# EAGLE schematic icyradio-main (EAGLE 9.6.2), part 2 of 3
## Sheet 5 of 13: RF Interface
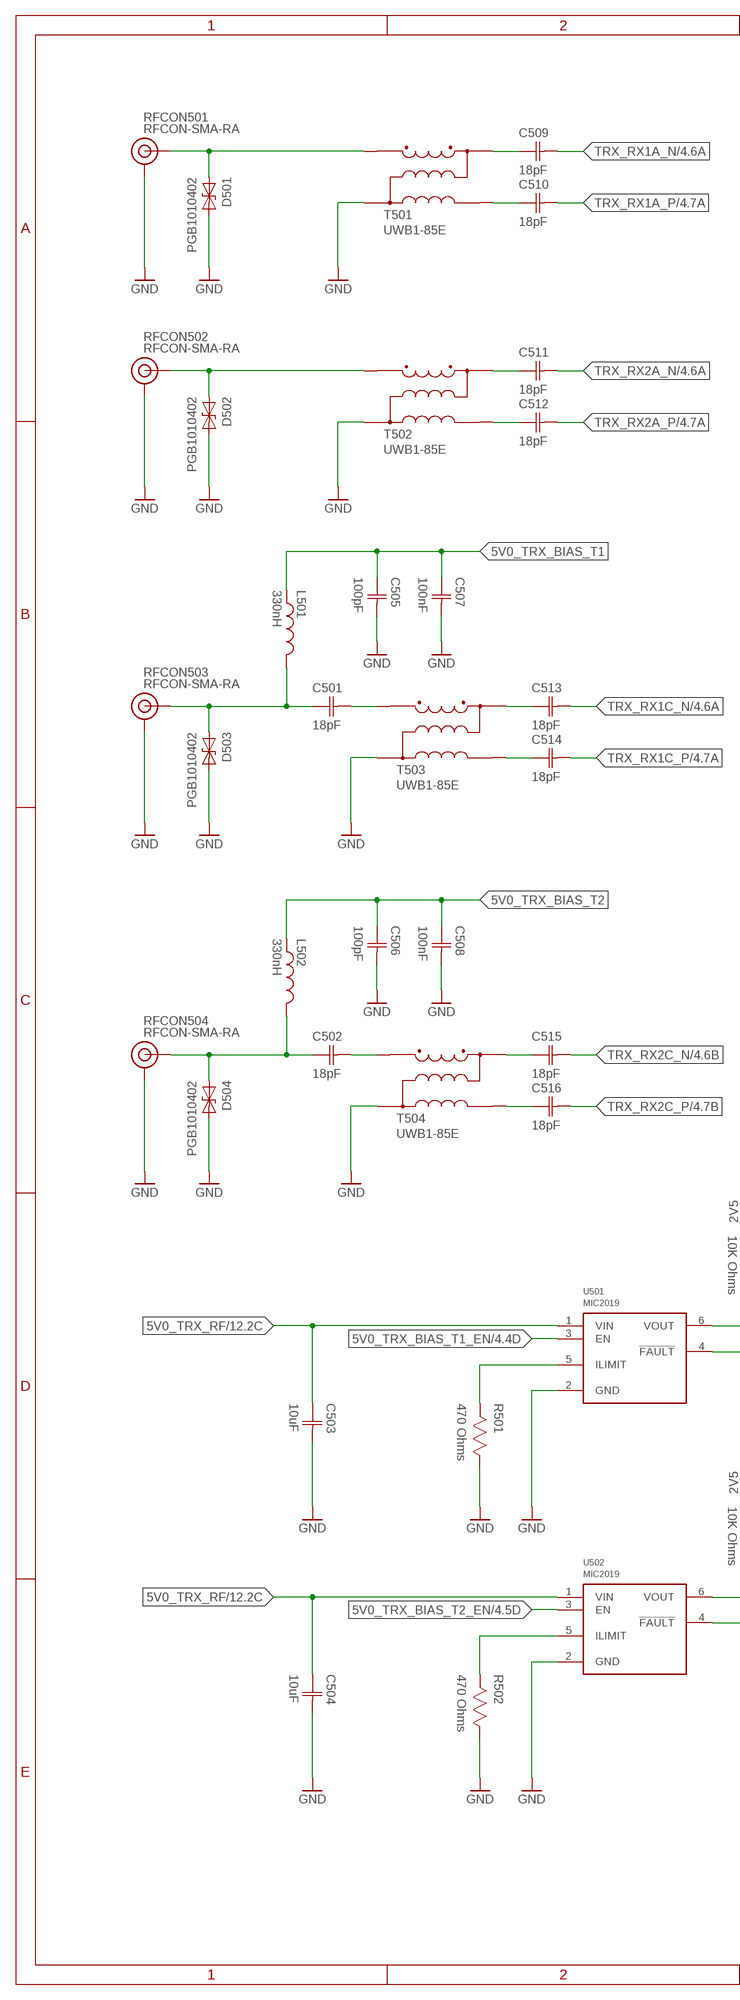
[diagram p8: schematic, sheet 5, part 1 of 2]
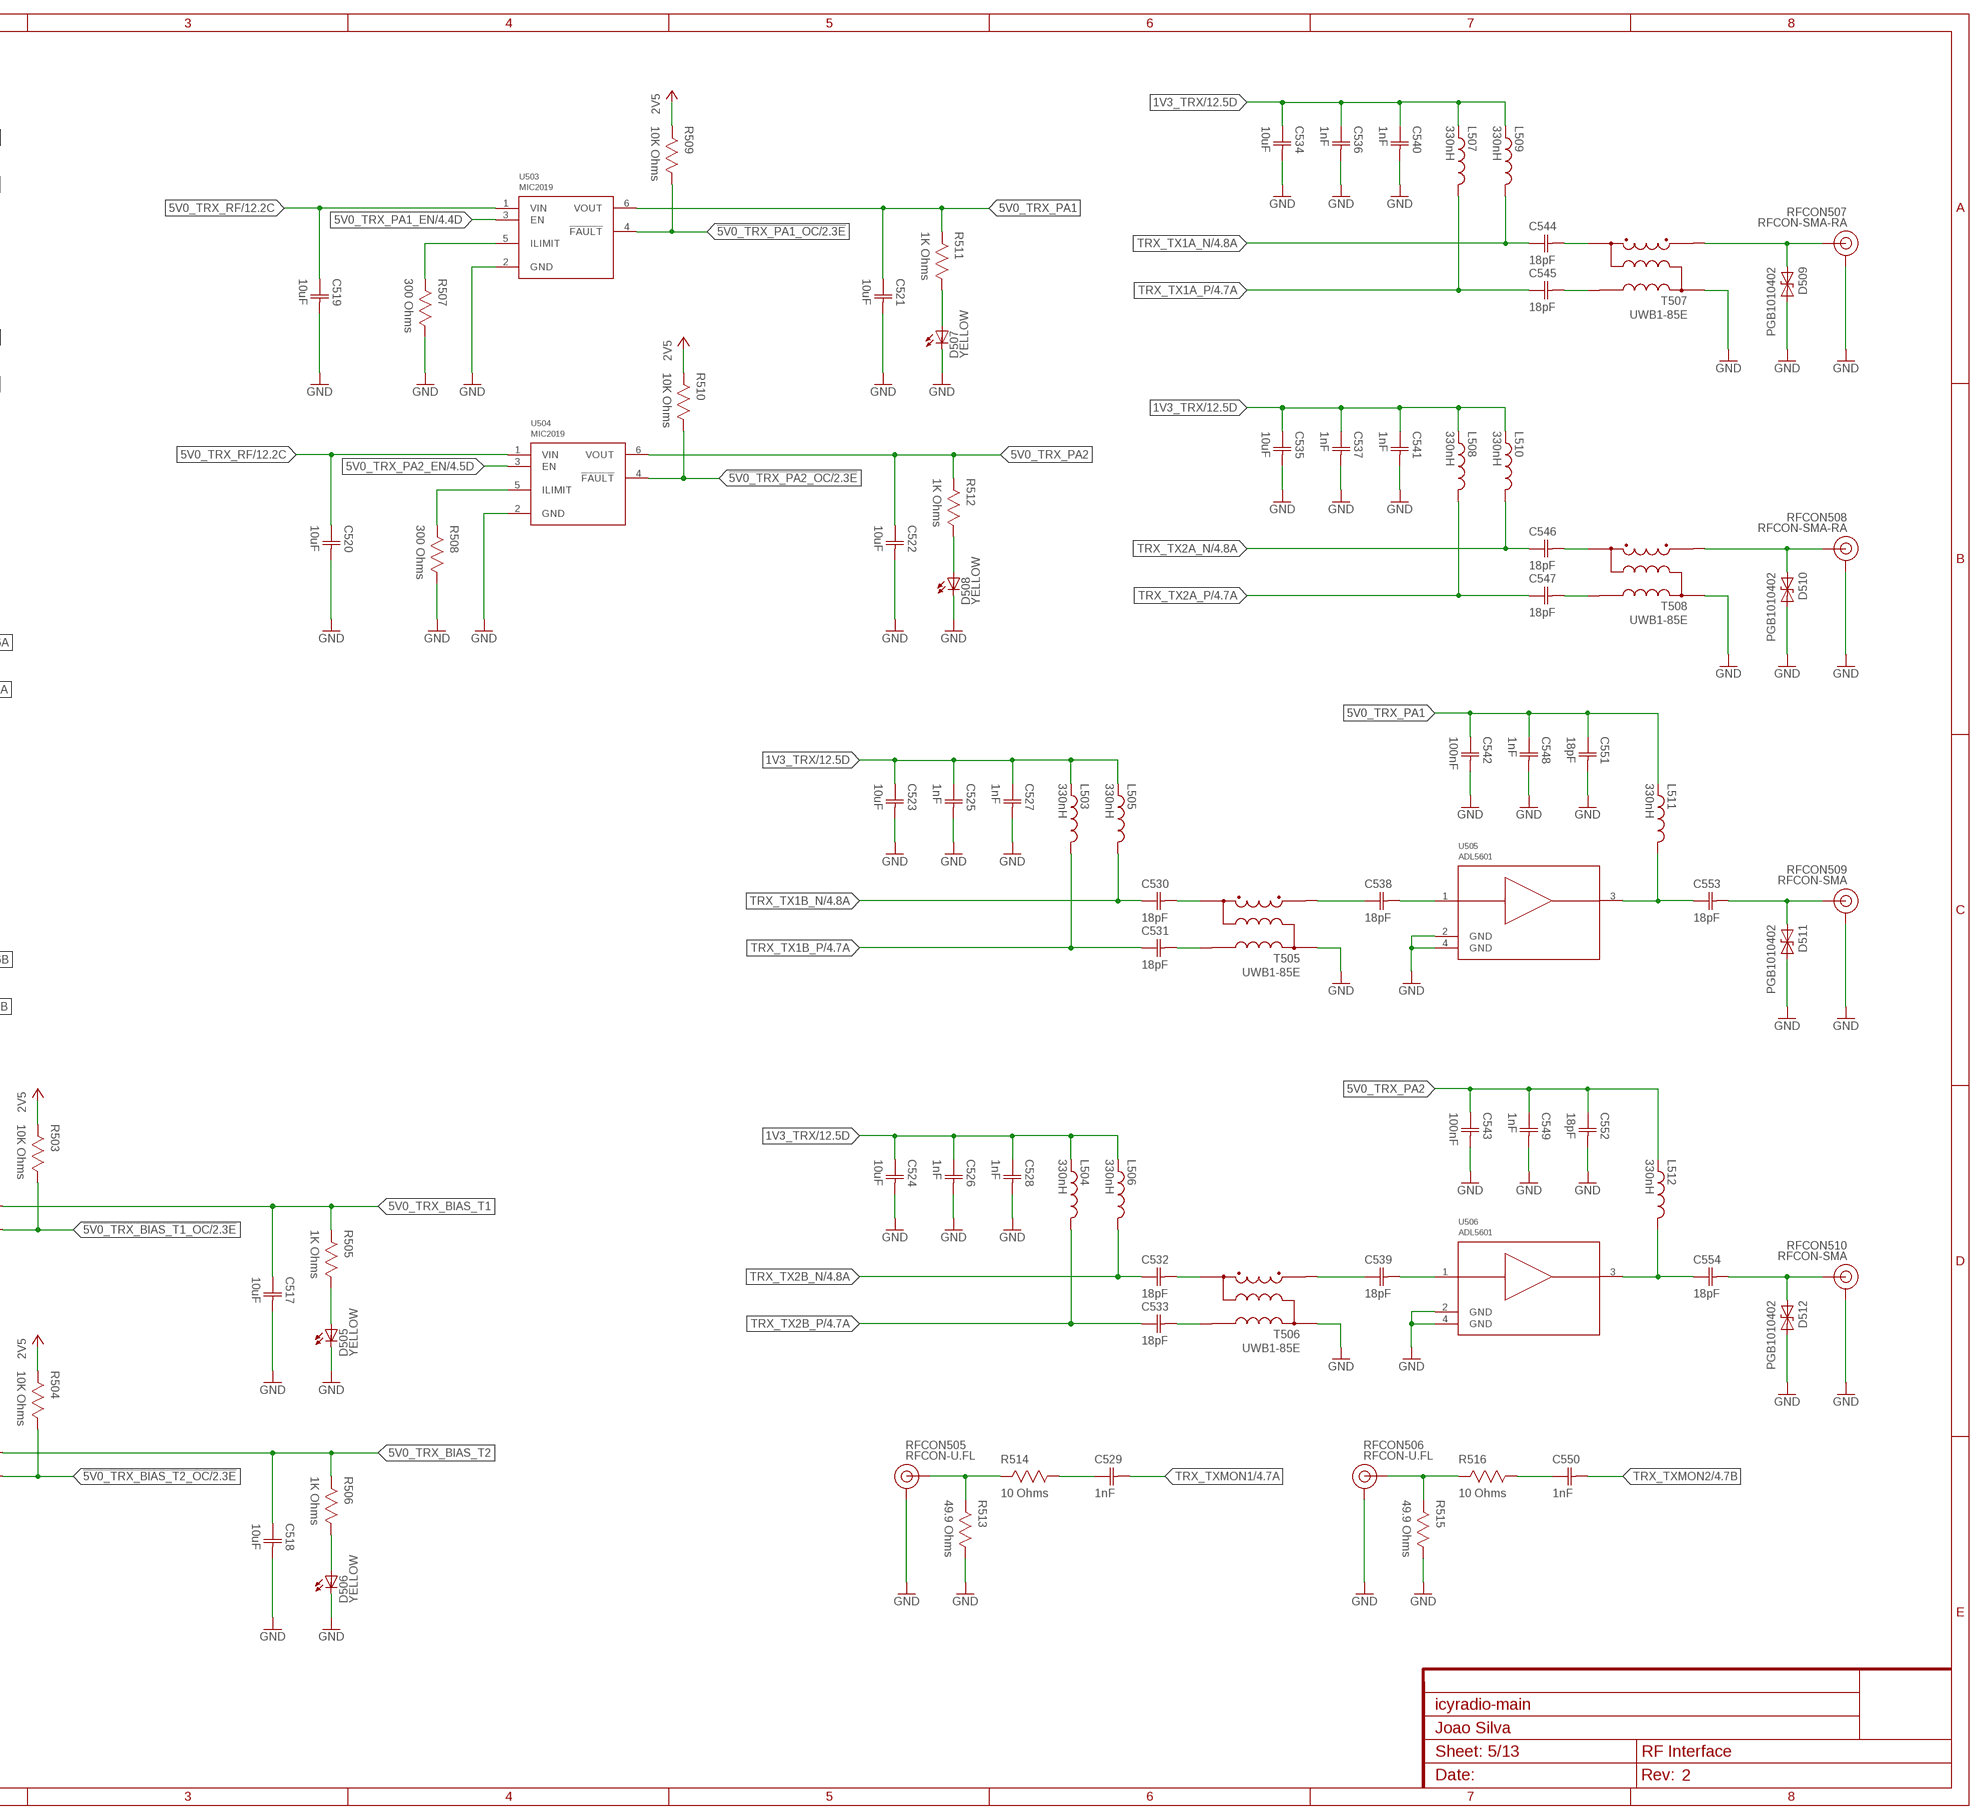
[diagram p9: schematic, sheet 5, part 2 of 2]

### Parts
C501  18pF  CAPACITOR-0402  [CAP0402]
C502  18pF  CAPACITOR-0402  [CAP0402]
C503  10uF  CAPACITOR-0603  [CAP0603]
C504  10uF  CAPACITOR-0603  [CAP0603]
C505  100pF  CAPACITOR-0402  [CAP0402]
C506  100pF  CAPACITOR-0402  [CAP0402]
C507  100nF  CAPACITOR-0402  [CAP0402]
C508  100nF  CAPACITOR-0402  [CAP0402]
C509  18pF  CAPACITOR-0402  [CAP0402]
C510  18pF  CAPACITOR-0402  [CAP0402]
C511  18pF  CAPACITOR-0402  [CAP0402]
C512  18pF  CAPACITOR-0402  [CAP0402]
C513  18pF  CAPACITOR-0402  [CAP0402]
C514  18pF  CAPACITOR-0402  [CAP0402]
C515  18pF  CAPACITOR-0402  [CAP0402]
C516  18pF  CAPACITOR-0402  [CAP0402]
C517  10uF  CAPACITOR-0603  [CAP0603]
C518  10uF  CAPACITOR-0603  [CAP0603]
C519  10uF  CAPACITOR-0603  [CAP0603]
C520  10uF  CAPACITOR-0603  [CAP0603]
C521  10uF  CAPACITOR-0603  [CAP0603]
C522  10uF  CAPACITOR-0603  [CAP0603]
C523  10uF  CAPACITOR-0402  [CAP0402]
C524  10uF  CAPACITOR-0402  [CAP0402]
C525  1nF  CAPACITOR-0402  [CAP0402]
C526  1nF  CAPACITOR-0402  [CAP0402]
C527  1nF  CAPACITOR-0402  [CAP0402]
C528  1nF  CAPACITOR-0402  [CAP0402]
C529  1nF  CAPACITOR-0402  [CAP0402]
C530  18pF  CAPACITOR-0402  [CAP0402]
C531  18pF  CAPACITOR-0402  [CAP0402]
C532  18pF  CAPACITOR-0402  [CAP0402]
C533  18pF  CAPACITOR-0402  [CAP0402]
C534  10uF  CAPACITOR-0402  [CAP0402]
C535  10uF  CAPACITOR-0402  [CAP0402]
C536  1nF  CAPACITOR-0402  [CAP0402]
C537  1nF  CAPACITOR-0402  [CAP0402]
C538  18pF  CAPACITOR-0402  [CAP0402]
C539  18pF  CAPACITOR-0402  [CAP0402]
C540  1nF  CAPACITOR-0402  [CAP0402]
C541  1nF  CAPACITOR-0402  [CAP0402]
C542  100nF  CAPACITOR-0402  [CAP0402]
C543  100nF  CAPACITOR-0402  [CAP0402]
C544  18pF  CAPACITOR-0402  [CAP0402]
C545  18pF  CAPACITOR-0402  [CAP0402]
C546  18pF  CAPACITOR-0402  [CAP0402]
C547  18pF  CAPACITOR-0402  [CAP0402]
C548  1nF  CAPACITOR-0402  [CAP0402]
C549  1nF  CAPACITOR-0402  [CAP0402]
C550  1nF  CAPACITOR-0402  [CAP0402]
C551  18pF  CAPACITOR-0402  [CAP0402]
C552  18pF  CAPACITOR-0402  [CAP0402]
C553  18pF  CAPACITOR-0402  [CAP0402]
C554  18pF  CAPACITOR-0402  [CAP0402]
D501  PGB1010402  [TVS0402]
D502  PGB1010402  [TVS0402]
D503  PGB1010402  [TVS0402]
D504  PGB1010402  [TVS0402]
D505  LED0603  [0603]
D506  LED0603  [0603]
D507  LED0603  [0603]
D508  LED0603  [0603]
D509  PGB1010402  [TVS0402]
D510  PGB1010402  [TVS0402]
D511  PGB1010402  [TVS0402]
D512  PGB1010402  [TVS0402]
L501  330nH  INDUCTOR-0805  [IND0805]
L502  330nH  INDUCTOR-0805  [IND0805]
L503  330nH  INDUCTOR-0603  [IND0603]
L504  330nH  INDUCTOR-0603  [IND0603]
L505  330nH  INDUCTOR-0603  [IND0603]
L506  330nH  INDUCTOR-0603  [IND0603]
L507  330nH  INDUCTOR-0603  [IND0603]
L508  330nH  INDUCTOR-0603  [IND0603]
L509  330nH  INDUCTOR-0603  [IND0603]
L510  330nH  INDUCTOR-0603  [IND0603]
L511  330nH  INDUCTOR-0603  [IND0603]
L512  330nH  INDUCTOR-0603  [IND0603]
R501  470 Ohms  RESISTOR-0402  [RES0402]
R502  470 Ohms  RESISTOR-0402  [RES0402]
R503  10K Ohms  RESISTOR-0402  [RES0402]
R504  10K Ohms  RESISTOR-0402  [RES0402]
R505  1K Ohms  RESISTOR-0402  [RES0402]
R506  1K Ohms  RESISTOR-0402  [RES0402]
R507  300 Ohms  RESISTOR-0402  [RES0402]
R508  300 Ohms  RESISTOR-0402  [RES0402]
R509  10K Ohms  RESISTOR-0402  [RES0402]
R510  10K Ohms  RESISTOR-0402  [RES0402]
R511  1K Ohms  RESISTOR-0402  [RES0402]
R512  1K Ohms  RESISTOR-0402  [RES0402]
R513  49.9 Ohms  RESISTOR-0402  [RES0402]
R514  10 Ohms  RESISTOR-0402  [RES0402]
R515  49.9 Ohms  RESISTOR-0402  [RES0402]
R516  10 Ohms  RESISTOR-0402  [RES0402]
RFCON501  RFCON-SMA-RA  [SMA-RA]
RFCON502  RFCON-SMA-RA  [SMA-RA]
RFCON503  RFCON-SMA-RA  [SMA-RA]
RFCON504  RFCON-SMA-RA  [SMA-RA]
RFCON505  RFCON-U.FL  [U.FL]
RFCON506  RFCON-U.FL  [U.FL]
RFCON507  RFCON-SMA-RA  [SMA-RA]
RFCON508  RFCON-SMA-RA  [SMA-RA]
RFCON509  RFCON-SMA  [SMA]
RFCON510  RFCON-SMA  [SMA]
T501  UWB1-85E  [UWB1]
T502  UWB1-85E  [UWB1]
T503  UWB1-85E  [UWB1]
T504  UWB1-85E  [UWB1]
T505  UWB1-85E  [UWB1]
T506  UWB1-85E  [UWB1]
T507  UWB1-85E  [UWB1]
T508  UWB1-85E  [UWB1]
U501  MIC2019  [SOT23-6]
U502  MIC2019  [SOT23-6]
U503  MIC2019  [SOT23-6]
U504  MIC2019  [SOT23-6]
U505  ADL5601  [SOT89]
U506  ADL5601  [SOT89]

### Nets
1V3_TRX: C523.1(C1) C524.1(C1) C525.1(C1) C526.1(C1) C527.1(C1) C528.1(C1) C534.1(C1) C535.1(C1) C536.1(C1) C537.1(C1) C540.1(C1) C541.1(C1) L503.1 L504.1 L505.1 L506.1 L507.1 L508.1 L509.1 L510.1 ; also sheet 4,12
2V5: R503.2 R504.2 R509.2 R510.2 ; also sheet 2,4,11,12
5V0_TRX_BIAS_T1: C505.1(C1) C507.1(C1) C517.1(C1) L501.1 R505.2 U501.6(VOUT)
5V0_TRX_BIAS_T1_EN: U501.3(EN) ; also sheet 4
5V0_TRX_BIAS_T2: C506.1(C1) C508.1(C1) C518.1(C1) L502.1 R506.2 U502.6(VOUT)
5V0_TRX_BIAS_T2_EN: U502.3(EN) ; also sheet 4
5V0_TRX_PA1: C521.1(C1) C542.1(C1) C548.1(C1) C551.1(C1) L511.1 R511.2 U503.6(VOUT)
5V0_TRX_PA1_EN: U503.3(EN) ; also sheet 4
5V0_TRX_PA2: C522.1(C1) C543.1(C1) C549.1(C1) C552.1(C1) L512.1 R512.2 U504.6(VOUT)
5V0_TRX_PA2_EN: U504.3(EN) ; also sheet 4
5V0_TRX_RF: C503.1(C1) C504.1(C1) C519.1(C1) C520.1(C1) U501.1(VIN) U502.1(VIN) U503.1(VIN) U504.1(VIN) ; also sheet 12
!5V0_TRX_BIAS_T1_OC: R503.1 U501.4(!FAULT) ; also sheet 2
!5V0_TRX_BIAS_T2_OC: R504.1 U502.4(!FAULT) ; also sheet 2
!5V0_TRX_PA1_OC: R509.1 U503.4(!FAULT) ; also sheet 2
!5V0_TRX_PA2_OC: R510.1 U504.4(!FAULT) ; also sheet 2
GND: C503.2(C2) C504.2(C2) C505.2(C2) C506.2(C2) C507.2(C2) C508.2(C2) C517.2(C2) C518.2(C2) C519.2(C2) C520.2(C2) C521.2(C2) C522.2(C2) C523.2(C2) C524.2(C2) C525.2(C2) C526.2(C2) C527.2(C2) C528.2(C2) C534.2(C2) C535.2(C2) C536.2(C2) C537.2(C2) C540.2(C2) C541.2(C2) C542.2(C2) C543.2(C2) C548.2(C2) C549.2(C2) C551.2(C2) C552.2(C2) D501.2 D502.2 D503.2 D504.2 D505.C D506.C D507.C D508.C D509.2 D510.2 D511.2 D512.2 R501.1 R502.1 R507.1 R508.1 R513.1 R515.1 RFCON501.GND@0(GND) RFCON501.GND@1(GND) RFCON501.GND@2(GND) RFCON501.GND@3(GND) RFCON502.GND@0(GND) RFCON502.GND@1(GND) RFCON502.GND@2(GND) RFCON502.GND@3(GND) RFCON503.GND@0(GND) RFCON503.GND@1(GND) RFCON503.GND@2(GND) RFCON503.GND@3(GND) RFCON504.GND@0(GND) RFCON504.GND@1(GND) RFCON504.GND@2(GND) RFCON504.GND@3(GND) RFCON505.P$1(GND) RFCON505.P$2(GND) RFCON506.P$1(GND) RFCON506.P$2(GND) RFCON507.GND@0(GND) RFCON507.GND@1(GND) RFCON507.GND@2(GND) RFCON507.GND@3(GND) RFCON508.GND@0(GND) RFCON508.GND@1(GND) RFCON508.GND@2(GND) RFCON508.GND@3(GND) RFCON509.GND@0(GND) RFCON509.GND@1(GND) RFCON509.GND@2(GND) RFCON509.GND@3(GND) RFCON510.GND@0(GND) RFCON510.GND@1(GND) RFCON510.GND@2(GND) RFCON510.GND@3(GND) T501.2(PRI2) T502.2(PRI2) T503.2(PRI2) T504.2(PRI2) T505.2(PRI2) T506.2(PRI2) T507.2(PRI2) T508.2(PRI2) U501.2(GND) U502.2(GND) U503.2(GND) U504.2(GND) U505.2(GND) U505.4(GND) U506.2(GND) U506.4(GND) ; also sheet 1,2,3,4,6,7,8,9,10,11,12
N$10: C533.2(C2) T506.4(SEC2)
N$11: C532.2(C2) T506.5(SEC1)
N$13: D508.A R512.1
N$14: C529.1(C1) R514.1
N$15: D507.A R511.1
N$16: C550.1(C1) R516.1
N$18: C545.2(C2) T507.4(SEC2)
N$20: C544.2(C2) T507.5(SEC1)
N$22: C547.2(C2) T508.4(SEC2)
N$23: C546.2(C2) T508.5(SEC1)
N$25: C510.1(C1) T501.4(SEC2)
N$26: C509.1(C1) T501.5(SEC1)
N$28: C512.1(C1) T502.4(SEC2)
N$30: C511.1(C1) T502.5(SEC1)
N$33: D505.A R505.1
N$34: D506.A R506.1
N$61: C516.1(C1) T504.4(SEC2)
N$62: C515.1(C1) T504.5(SEC1)
N$64: R507.2 U503.5(ILIMIT)
N$66: C514.1(C1) T503.4(SEC2)
N$67: C513.1(C1) T503.5(SEC1)
N$71: C531.2(C2) T505.4(SEC2)
N$72: C530.2(C2) T505.5(SEC1)
N$78: R508.2 U504.5(ILIMIT)
N$80: R501.2 U501.5(ILIMIT)
N$82: R502.2 U502.5(ILIMIT)
TRX_RX1A [CPWG 50 Ohm Single-Ended]: D501.1 RFCON501.SIGNAL T501.3(PRI1)
TRX_RX1A_N [CPWG 100 Ohm Differential]: C509.2(C2) ; also sheet 4
TRX_RX1A_P [CPWG 100 Ohm Differential]: C510.2(C2) ; also sheet 4
TRX_RX1C_ACC [CPWG 50 Ohm Single-Ended]: C501.2(C2) T503.3(PRI1)
TRX_RX1C_DCC [CPWG 50 Ohm Single-Ended]: C501.1(C1) D503.1 L501.2 RFCON503.SIGNAL
TRX_RX1C_N [CPWG 100 Ohm Differential]: C513.2(C2) ; also sheet 4
TRX_RX1C_P [CPWG 100 Ohm Differential]: C514.2(C2) ; also sheet 4
TRX_RX2A [CPWG 50 Ohm Single-Ended]: D502.1 RFCON502.SIGNAL T502.3(PRI1)
TRX_RX2A_N [CPWG 100 Ohm Differential]: C511.2(C2) ; also sheet 4
TRX_RX2A_P [CPWG 100 Ohm Differential]: C512.2(C2) ; also sheet 4
TRX_RX2C_ACC [CPWG 50 Ohm Single-Ended]: C502.2(C2) T504.3(PRI1)
TRX_RX2C_DCC [CPWG 50 Ohm Single-Ended]: C502.1(C1) D504.1 L502.2 RFCON504.SIGNAL
TRX_RX2C_N [CPWG 100 Ohm Differential]: C515.2(C2) ; also sheet 4
TRX_RX2C_P [CPWG 100 Ohm Differential]: C516.2(C2) ; also sheet 4
TRX_TX1A [CPWG 50 Ohm Single-Ended]: D509.1 RFCON507.SIGNAL T507.3(PRI1)
TRX_TX1A_N [CPWG 100 Ohm Differential]: C544.1(C1) L509.2 ; also sheet 4
TRX_TX1A_P [CPWG 100 Ohm Differential]: C545.1(C1) L507.2 ; also sheet 4
TRX_TX1B [CPWG 50 Ohm Single-Ended]: C538.1(C1) T505.3(PRI1)
TRX_TX1B_AMP_ACC [CPWG 50 Ohm Single-Ended]: C553.2(C2) D511.1 RFCON509.SIGNAL
TRX_TX1B_AMP_DCC [CPWG 50 Ohm Single-Ended]: C553.1(C1) L511.2 U505.3(RFOUT)
TRX_TX1B_DCC [CPWG 50 Ohm Single-Ended]: C538.2(C2) U505.1(RFIN)
TRX_TX1B_N [CPWG 100 Ohm Differential]: C530.1(C1) L505.2 ; also sheet 4
TRX_TX1B_P [CPWG 100 Ohm Differential]: C531.1(C1) L503.2 ; also sheet 4
TRX_TX2A [CPWG 50 Ohm Single-Ended]: D510.1 RFCON508.SIGNAL T508.3(PRI1)
TRX_TX2A_N [CPWG 100 Ohm Differential]: C546.1(C1) L510.2 ; also sheet 4
TRX_TX2A_P [CPWG 100 Ohm Differential]: C547.1(C1) L508.2 ; also sheet 4
TRX_TX2B [CPWG 50 Ohm Single-Ended]: C539.1(C1) T506.3(PRI1)
TRX_TX2B_AMP [CPWG 50 Ohm Single-Ended]: C554.2(C2) D512.1 RFCON510.SIGNAL
TRX_TX2B_AMP_DCC [CPWG 50 Ohm Single-Ended]: C554.1(C1) L512.2 U506.3(RFOUT)
TRX_TX2B_DCC [CPWG 50 Ohm Single-Ended]: C539.2(C2) U506.1(RFIN)
TRX_TX2B_N [CPWG 100 Ohm Differential]: C532.1(C1) L506.2 ; also sheet 4
TRX_TX2B_P [CPWG 100 Ohm Differential]: C533.1(C1) L504.2 ; also sheet 4
TRX_TXMON1: C529.2(C2) ; also sheet 4
TRX_TXMON1_Z50 [CPWG 50 Ohm Single-Ended]: R513.2 R514.2 RFCON505.P$3(SIGNAL)
TRX_TXMON2: C550.2(C2) ; also sheet 4
TRX_TXMON2_Z50 [CPWG 50 Ohm Single-Ended]: R515.2 R516.2 RFCON506.P$3(SIGNAL)

## Sheet 6 of 13: mmWave Synthesizer
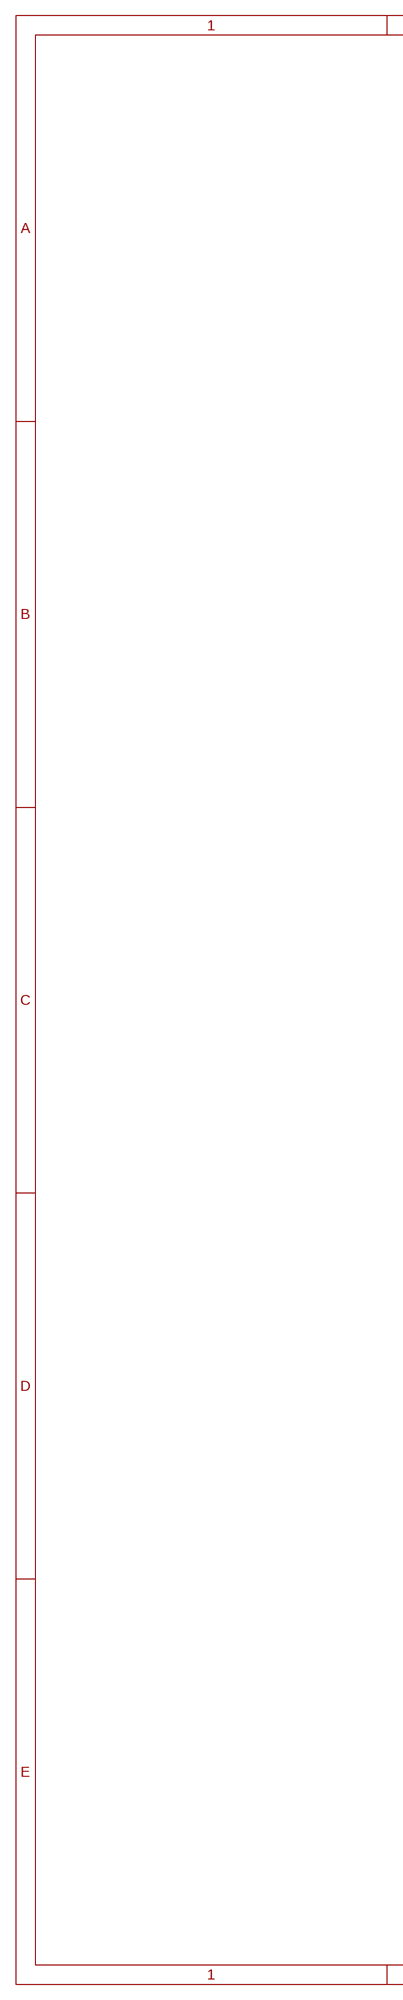
[diagram p10: schematic, sheet 6, part 1 of 2]
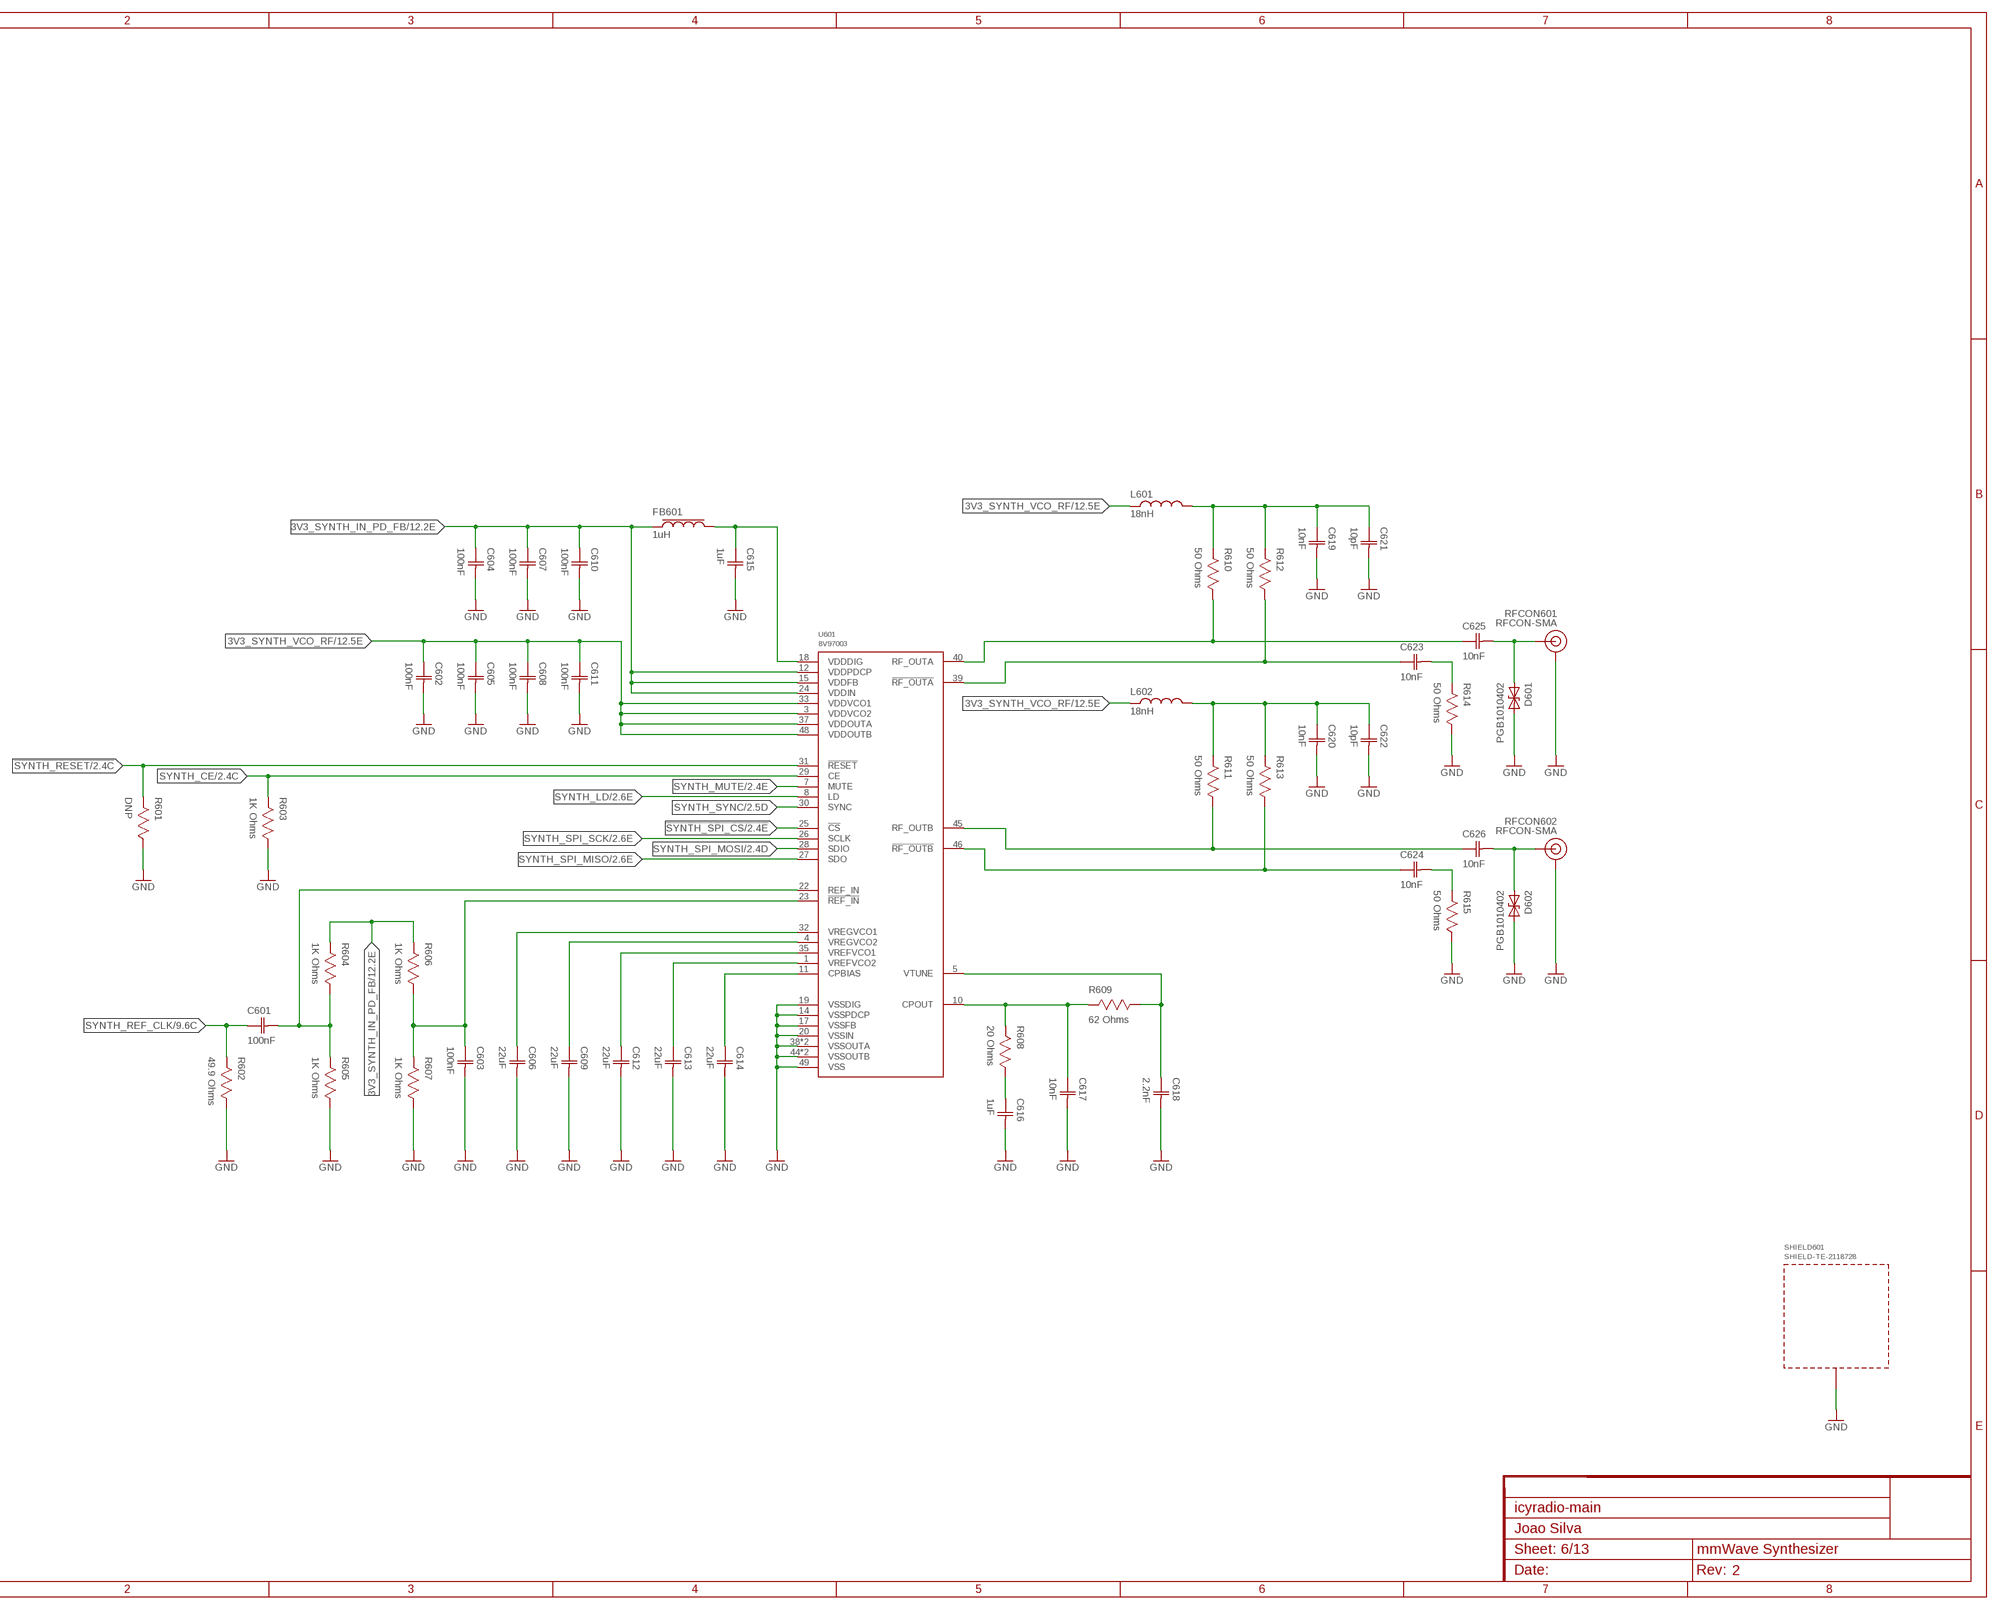
[diagram p11: schematic, sheet 6, part 2 of 2]

### Parts
C601  100nF  CAPACITOR-0402  [CAP0402]
C602  100nF  CAPACITOR-0402  [CAP0402]
C603  100nF  CAPACITOR-0402  [CAP0402]
C604  100nF  CAPACITOR-0402  [CAP0402]
C605  100nF  CAPACITOR-0402  [CAP0402]
C606  22uF  CAPACITOR-0402  [CAP0402]
C607  100nF  CAPACITOR-0402  [CAP0402]
C608  100nF  CAPACITOR-0402  [CAP0402]
C609  22uF  CAPACITOR-0402  [CAP0402]
C610  100nF  CAPACITOR-0402  [CAP0402]
C611  100nF  CAPACITOR-0402  [CAP0402]
C612  22uF  CAPACITOR-0402  [CAP0402]
C613  22uF  CAPACITOR-0402  [CAP0402]
C614  22uF  CAPACITOR-0402  [CAP0402]
C615  1uF  CAPACITOR-0402  [CAP0402]
C616  1uF  CAPACITOR-0402  [CAP0402]
C617  10nF  CAPACITOR-0402  [CAP0402]
C618  2.2nF  CAPACITOR-0402  [CAP0402]
C619  10nF  CAPACITOR-0402  [CAP0402]
C620  10nF  CAPACITOR-0402  [CAP0402]
C621  10pF  CAPACITOR-0402  [CAP0402]
C622  10pF  CAPACITOR-0402  [CAP0402]
C623  10nF  CAPACITOR-0402  [CAP0402]
C624  10nF  CAPACITOR-0402  [CAP0402]
C625  10nF  CAPACITOR-0402  [CAP0402]
C626  10nF  CAPACITOR-0402  [CAP0402]
D601  PGB1010402  [TVS0402]
D602  PGB1010402  [TVS0402]
FB601  1uH  FERRITE-0603  [IND0603]
L601  18nH  INDUCTOR-0402  [IND0402]
L602  18nH  INDUCTOR-0402  [IND0402]
R601  DNP  RESISTOR-0402  [RES0402]
R602  49.9 Ohms  RESISTOR-0402  [RES0402]
R603  1K Ohms  RESISTOR-0402  [RES0402]
R604  1K Ohms  RESISTOR-0402  [RES0402]
R605  1K Ohms  RESISTOR-0402  [RES0402]
R606  1K Ohms  RESISTOR-0402  [RES0402]
R607  1K Ohms  RESISTOR-0402  [RES0402]
R608  20 Ohms  RESISTOR-0402  [RES0402]
R609  62 Ohms  RESISTOR-0402  [RES0402]
R610  50 Ohms  RESISTOR-0402  [RES0402]
R611  50 Ohms  RESISTOR-0402  [RES0402]
R612  50 Ohms  RESISTOR-0402  [RES0402]
R613  50 Ohms  RESISTOR-0402  [RES0402]
R614  50 Ohms  RESISTOR-0402  [RES0402]
R615  50 Ohms  RESISTOR-0402  [RES0402]
RFCON601  RFCON-SMA  [SMA]
RFCON602  RFCON-SMA  [SMA]
SHIELD601  SHIELD-TE-2118728  [2118728]
U601  8V97003  [VFQFPN48]

### Nets
3V3_SYNTH_IN_PD_FB: C604.1(C1) C607.1(C1) C610.1(C1) FB601.1 R604.2 R606.2 U601.12(VDDPDCP) U601.15(VDDFB) U601.24(VDDIN) ; also sheet 12
3V3_SYNTH_VCO_RF: C602.1(C1) C605.1(C1) C608.1(C1) C611.1(C1) L601.1 L602.1 U601.3(VDDVCO2) U601.33(VDDVCO1) U601.37(VDDOUTA) U601.48(VDDOUTB) ; also sheet 12
!SYNTH_RESET: R601.2 U601.31(!RESET) ; also sheet 2
!SYNTH_SPI_CS: U601.25(!CS) ; also sheet 2
GND: C602.2(C2) C603.2(C2) C604.2(C2) C605.2(C2) C606.2(C2) C607.2(C2) C608.2(C2) C609.2(C2) C610.2(C2) C611.2(C2) C612.2(C2) C613.2(C2) C614.2(C2) C615.2(C2) C616.2(C2) C617.2(C2) C618.2(C2) C619.2(C2) C620.2(C2) C621.2(C2) C622.2(C2) D601.2 D602.2 R601.1 R602.1 R603.1 R605.1 R607.1 R614.1 R615.1 RFCON601.GND@0(GND) RFCON601.GND@1(GND) RFCON601.GND@2(GND) RFCON601.GND@3(GND) RFCON602.GND@0(GND) RFCON602.GND@1(GND) RFCON602.GND@2(GND) RFCON602.GND@3(GND) SHIELD601.1(GND) SHIELD601.2(GND) SHIELD601.3(GND) SHIELD601.4(GND) SHIELD601.5(GND) SHIELD601.6(GND) SHIELD601.7(GND) SHIELD601.8(GND) SHIELD601.9(GND) SHIELD601.10(GND) SHIELD601.11(GND) SHIELD601.12(GND) SHIELD601.13(GND) SHIELD601.14(GND) SHIELD601.15(GND) SHIELD601.16(GND) U601.14(VSSPDCP) U601.17(VSSFB) U601.19(VSSDIG) U601.20(VSSIN) U601.38(VSSOUTA) U601.41(VSSOUTA) U601.44(VSSOUTB) U601.47(VSSOUTB) U601.49(VSS) ; also sheet 1,2,3,4,5,7,8,9,10,11,12
N$98: C615.1(C1) FB601.2 U601.18(VDDDIG)
N$101: C616.1(C1) R608.1
SYNTH_CE: R603.2 U601.29(CE) ; also sheet 2
SYNTH_CPBIAS: C614.1(C1) U601.11(CPBIAS)
SYNTH_CPOUT: C617.1(C1) R608.2 R609.2 U601.10(CPOUT)
SYNTH_LD: U601.8(LD) ; also sheet 2
SYNTH_MUTE: U601.7(MUTE) ; also sheet 2
SYNTH_REF_CLK [CPWG 50 Ohm Single-Ended]: C601.1(C1) R602.2 ; also sheet 9
SYNTH_REFIN_N: C603.1(C1) R606.1 R607.2 U601.23(!REF_IN)
SYNTH_REFIN_P: C601.2(C2) R604.1 R605.2 U601.22(REF_IN)
SYNTH_RFOUTA_ACC_N [CPWG 50 Ohm Single-Ended]: C623.2(C2) R614.2
SYNTH_RFOUTA_ACC_P [CPWG 50 Ohm Single-Ended]: C625.2(C2) D601.1 RFCON601.SIGNAL
SYNTH_RFOUTA_BIAS: C619.1(C1) C621.1(C1) L601.2 R610.2 R612.2
SYNTH_RFOUTA_N [CPWG 100 Ohm Differential]: C623.1(C1) R612.1 U601.39(!RF_OUTA)
SYNTH_RFOUTA_P [CPWG 100 Ohm Differential]: C625.1(C1) R610.1 U601.40(RF_OUTA)
SYNTH_RFOUTB_ACC_N [CPWG 50 Ohm Single-Ended]: C624.2(C2) R615.2
SYNTH_RFOUTB_ACC_P [CPWG 50 Ohm Single-Ended]: C626.2(C2) D602.1 RFCON602.SIGNAL
SYNTH_RFOUTB_BIAS: C620.1(C1) C622.1(C1) L602.2 R611.2 R613.2
SYNTH_RFOUTB_N [CPWG 100 Ohm Differential]: C624.1(C1) R613.1 U601.46(!RF_OUTB)
SYNTH_RFOUTB_P [CPWG 100 Ohm Differential]: C626.1(C1) R611.1 U601.45(RF_OUTB)
SYNTH_SPI_MISO: U601.27(SDO) ; also sheet 2
SYNTH_SPI_MOSI: U601.28(SDIO) ; also sheet 2
SYNTH_SPI_SCK: U601.26(SCLK) ; also sheet 2
SYNTH_SYNC: U601.30(SYNC) ; also sheet 2
SYNTH_VREFVCO1: C612.1(C1) U601.35(VREFVCO1)
SYNTH_VREFVCO2: C613.1(C1) U601.1(VREFVCO2)
SYNTH_VREGVCO1: C606.1(C1) U601.32(VREGVCO1)
SYNTH_VREGVCO2: C609.1(C1) U601.4(VREGVCO2)
SYNTH_VTUNE: C618.1(C1) R609.1 U601.5(VTUNE)

## Sheet 7 of 13: Audio CODEC
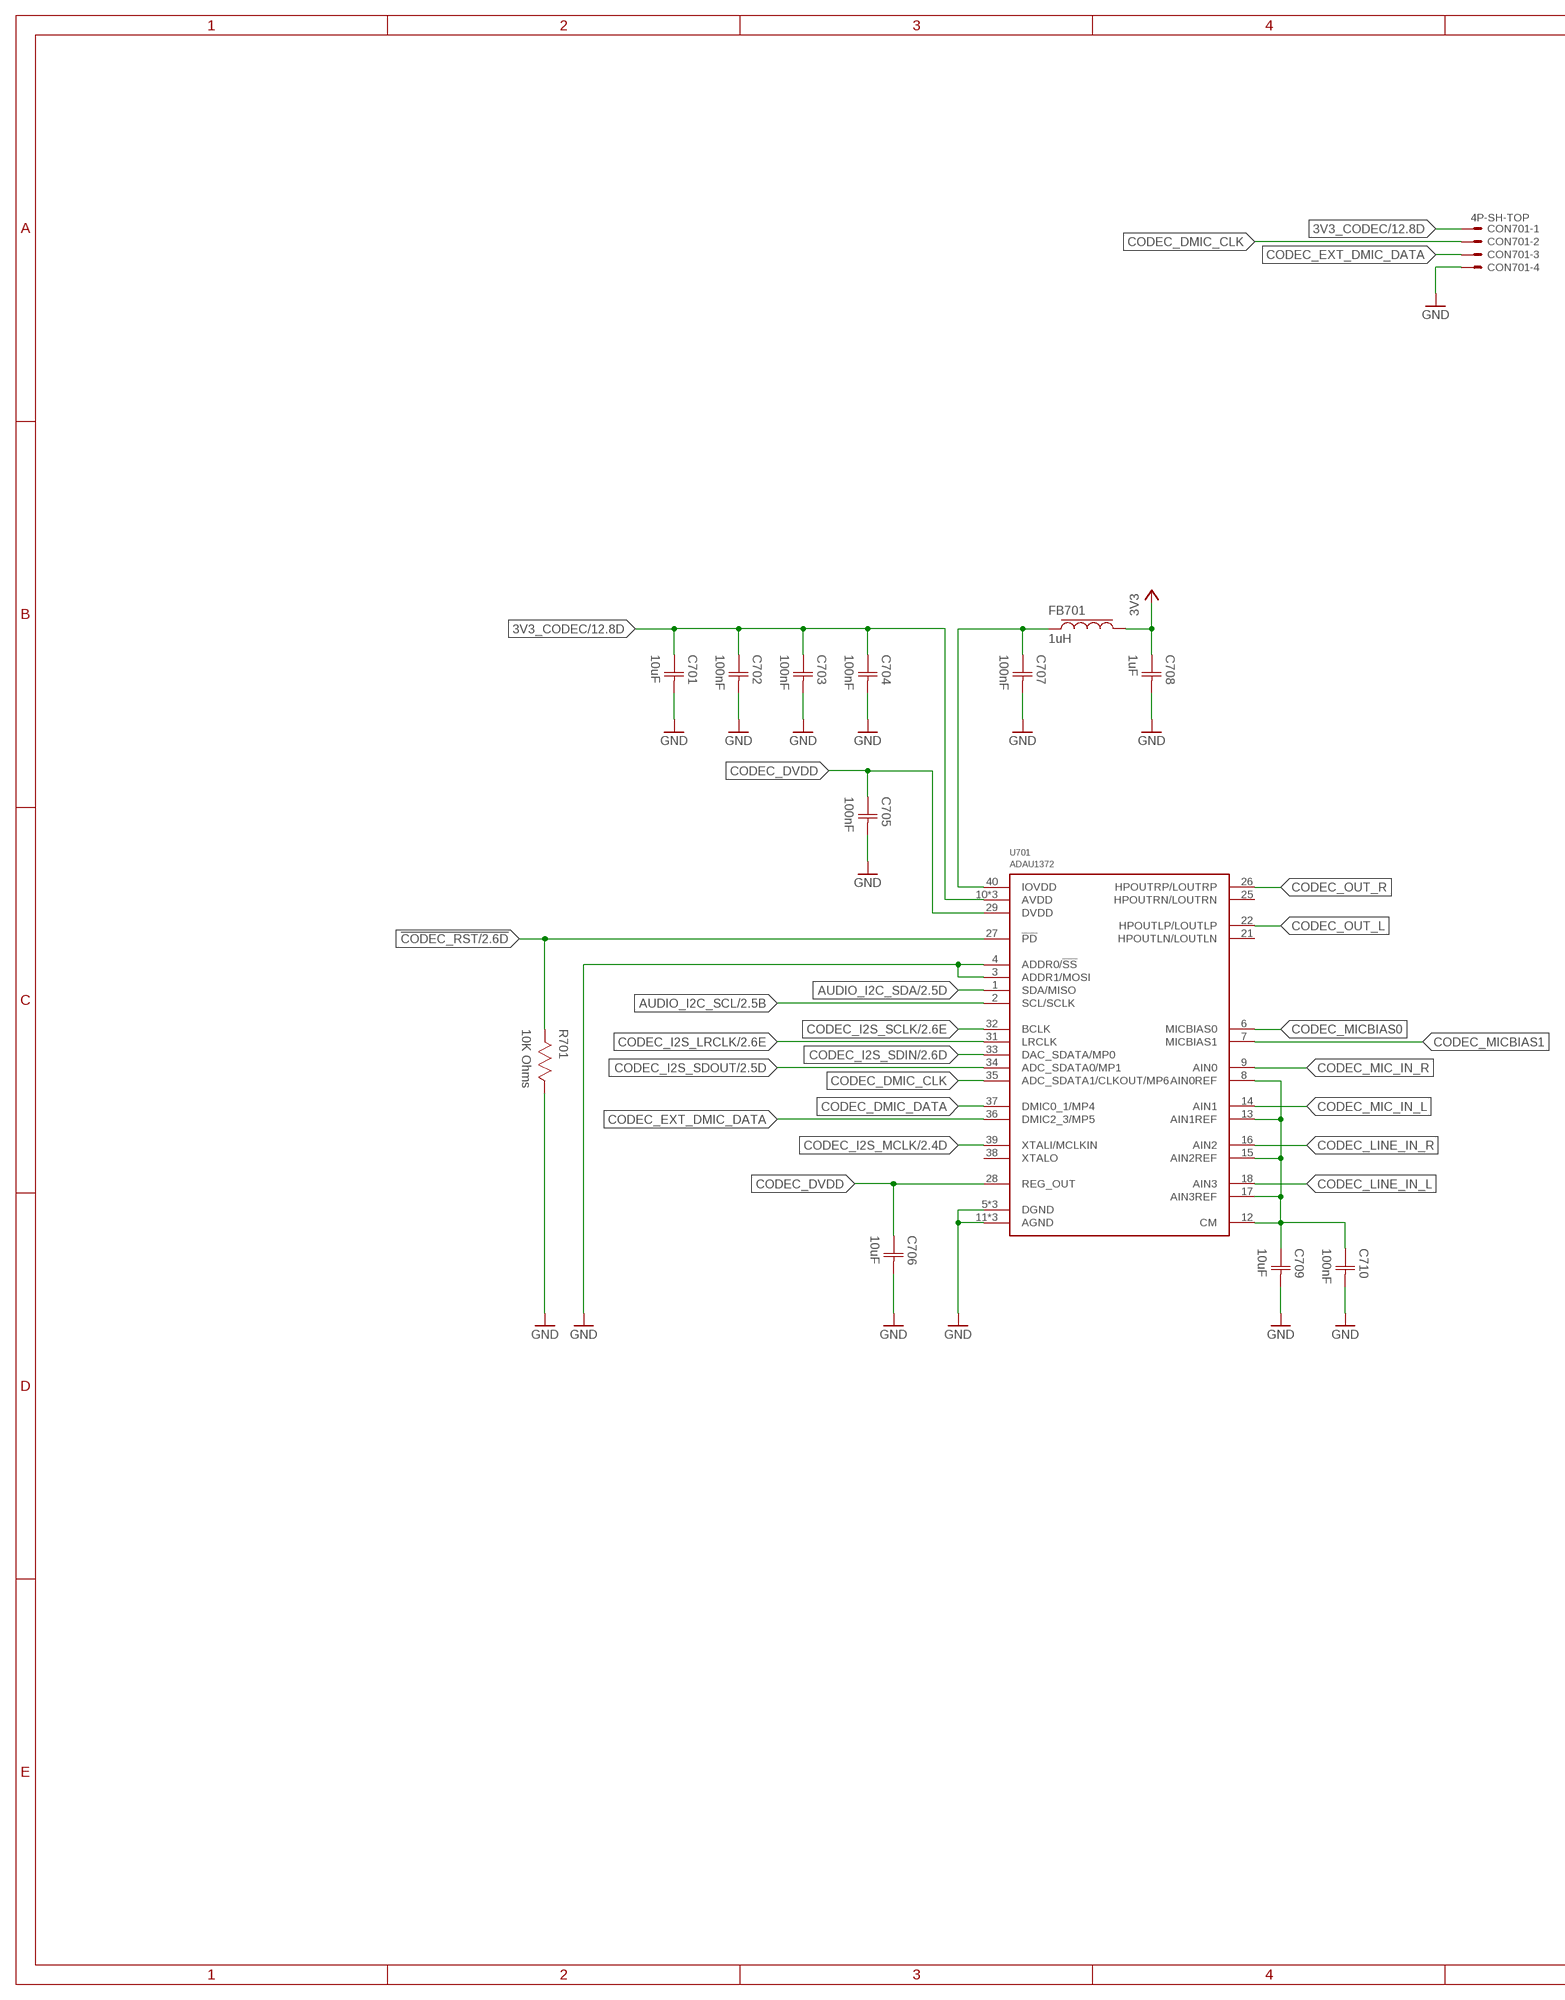
[diagram p12: schematic, sheet 7, part 1 of 2]
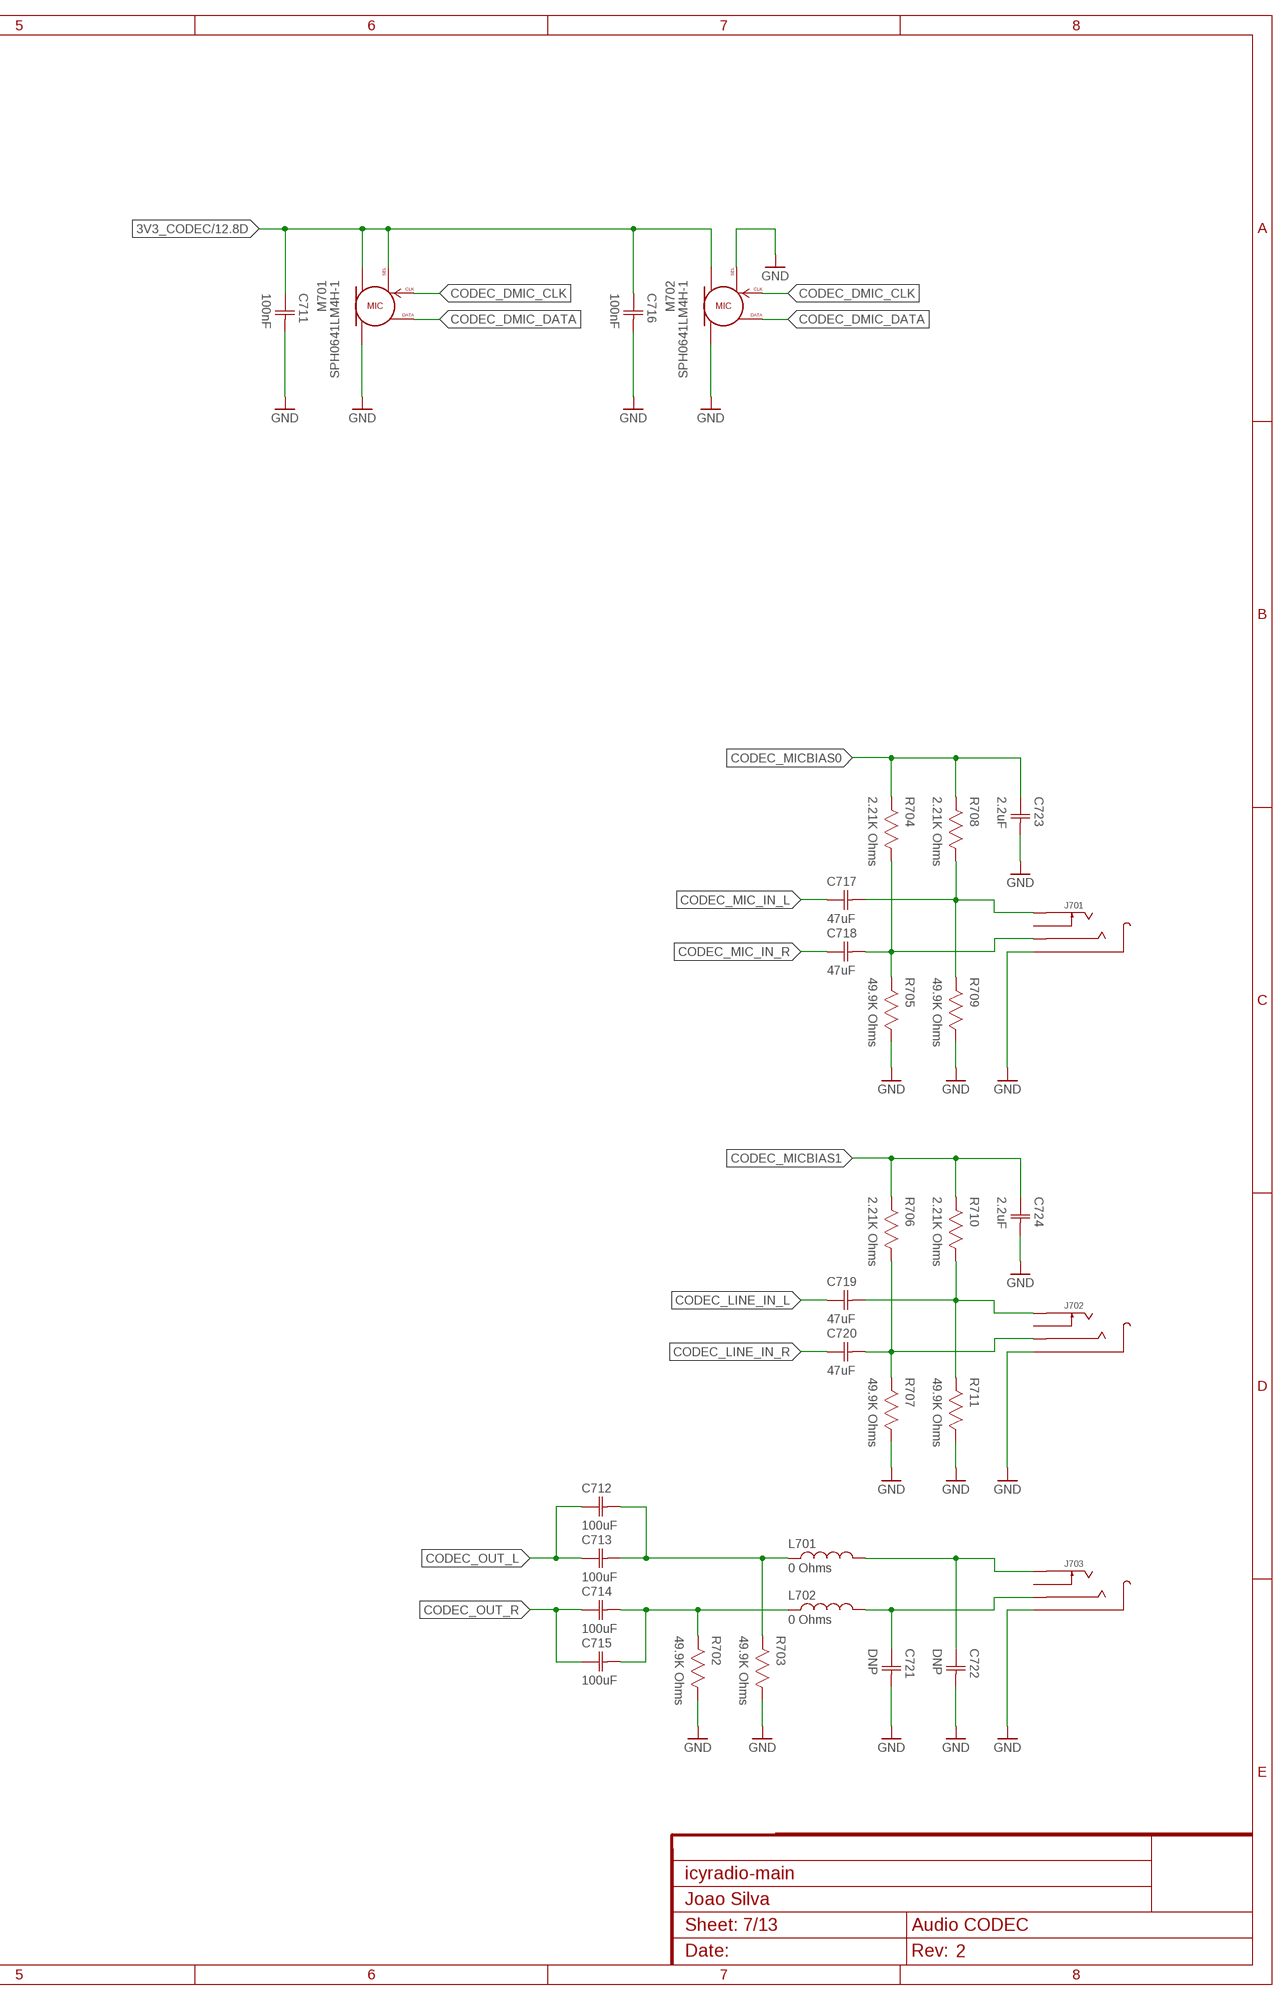
[diagram p13: schematic, sheet 7, part 2 of 2]

### Parts
C701  10uF  CAPACITOR-0402  [CAP0402]
C702  100nF  CAPACITOR-0402  [CAP0402]
C703  100nF  CAPACITOR-0402  [CAP0402]
C704  100nF  CAPACITOR-0402  [CAP0402]
C705  100nF  CAPACITOR-0402  [CAP0402]
C706  10uF  CAPACITOR-0402  [CAP0402]
C707  100nF  CAPACITOR-0402  [CAP0402]
C708  1uF  CAPACITOR-0402  [CAP0402]
C709  10uF  CAPACITOR-0402  [CAP0402]
C710  100nF  CAPACITOR-0402  [CAP0402]
C711  100nF  CAPACITOR-0402  [CAP0402]
C712  100uF  CAPACITOR-0805  [CAP0805]
C713  100uF  CAPACITOR-0805  [CAP0805]
C714  100uF  CAPACITOR-0805  [CAP0805]
C715  100uF  CAPACITOR-0805  [CAP0805]
C716  100nF  CAPACITOR-0402  [CAP0402]
C717  47uF  CAPACITOR-0603  [CAP0603]
C718  47uF  CAPACITOR-0603  [CAP0603]
C719  47uF  CAPACITOR-0603  [CAP0603]
C720  47uF  CAPACITOR-0603  [CAP0603]
C721  DNP  CAPACITOR-0402  [CAP0402]
C722  DNP  CAPACITOR-0402  [CAP0402]
C723  2.2uF  CAPACITOR-0402  [CAP0402]
C724  2.2uF  CAPACITOR-0402  [CAP0402]
CON701  4P-SH-TOP  [SH-04-TOP]
FB701  1uH  FERRITE-0603  [IND0603]
J701  TRSJACK  [3.5TRSJACK]
J702  TRSJACK  [3.5TRSJACK]
J703  TRSJACK  [3.5TRSJACK]
L701  0 Ohms  INDUCTOR-0603  [IND0603]
L702  0 Ohms  INDUCTOR-0603  [IND0603]
M701  SPH0641LM4H-1  [SPH0641LM4H-1]
M702  SPH0641LM4H-1  [SPH0641LM4H-1]
R701  10K Ohms  RESISTOR-0402  [RES0402]
R702  49.9K Ohms  RESISTOR-0402  [RES0402]
R703  49.9K Ohms  RESISTOR-0402  [RES0402]
R704  2.21K Ohms  RESISTOR-0402  [RES0402]
R705  49.9K Ohms  RESISTOR-0402  [RES0402]
R706  2.21K Ohms  RESISTOR-0402  [RES0402]
R707  49.9K Ohms  RESISTOR-0402  [RES0402]
R708  2.21K Ohms  RESISTOR-0402  [RES0402]
R709  49.9K Ohms  RESISTOR-0402  [RES0402]
R710  2.21K Ohms  RESISTOR-0402  [RES0402]
R711  49.9K Ohms  RESISTOR-0402  [RES0402]
U701  ADAU1372  [QFN40]

### Nets
3V3: C708.1(C1) FB701.2 ; also sheet 2,8,9,10,11,12
3V3_CODEC: C701.1(C1) C702.1(C1) C703.1(C1) C704.1(C1) C711.1(C1) C716.1(C1) CON701.1 M701.2(SEL) M701.5(VCC) M702.5(VCC) U701.10(AVDD) U701.19(AVDD) U701.24(AVDD) ; also sheet 12
3V3_CODEC_DIG: C707.1(C1) FB701.1 U701.40(IOVDD)
!CODEC_RST: R701.2 U701.27(!PD) ; also sheet 2
AUDIO_I2C_SCL: U701.2(SCL/SCLK) ; also sheet 2
AUDIO_I2C_SDA: U701.1(SDA/MISO) ; also sheet 2
CODEC_CM: C709.1(C1) C710.1(C1) U701.8(AIN0REF) U701.12(CM) U701.13(AIN1REF) U701.15(AIN2REF) U701.17(AIN3REF)
CODEC_DMIC_CLK: CON701.2 M701.4(CLK) M702.4(CLK) U701.35(ADC_SDATA1/CLKOUT/MP6)
CODEC_DMIC_DATA: M701.1(DAT) M702.1(DAT) U701.37(DMIC0_1/MP4)
CODEC_DVDD: C705.1(C1) C706.1(C1) U701.28(REG_OUT) U701.29(DVDD)
CODEC_EXT_DMIC_DATA: CON701.3 U701.36(DMIC2_3/MP5)
CODEC_I2S_LRCLK: U701.31(LRCLK) ; also sheet 2
CODEC_I2S_MCLK: U701.39(XTALI/MCLKIN) ; also sheet 2
CODEC_I2S_SCLK: U701.32(BCLK) ; also sheet 2
CODEC_I2S_SDIN: U701.33(DAC_SDATA/MP0) ; also sheet 2
CODEC_I2S_SDOUT: U701.34(ADC_SDATA0/MP1) ; also sheet 2
CODEC_LINE_IN_L: C719.1(C1) U701.18(AIN3)
CODEC_LINE_IN_R: C720.1(C1) U701.16(AIN2)
CODEC_MIC_IN_L: C717.1(C1) U701.14(AIN1)
CODEC_MIC_IN_R: C718.1(C1) U701.9(AIN0)
CODEC_MICBIAS0: C723.1(C1) R704.2 R708.2 U701.6(MICBIAS0)
CODEC_MICBIAS1: C724.1(C1) R706.2 R710.2 U701.7(MICBIAS1)
CODEC_OUT_L: C712.1(C1) C713.1(C1) U701.22(HPOUTLP/LOUTLP)
CODEC_OUT_R: C714.1(C1) C715.1(C1) U701.26(HPOUTRP/LOUTRP)
GND: C701.2(C2) C702.2(C2) C703.2(C2) C704.2(C2) C705.2(C2) C706.2(C2) C707.2(C2) C708.2(C2) C709.2(C2) C710.2(C2) C711.2(C2) C716.2(C2) C721.2(C2) C722.2(C2) C723.2(C2) C724.2(C2) CON701.4 J701.1(S) J702.1(S) J703.1(S) M701.3(GND) M702.2(SEL) M702.3(GND) R701.1 R702.1 R703.1 R705.1 R707.1 R709.1 R711.1 U701.3(ADDR1/MOSI) U701.4(ADDR0/!SS) U701.5(DGND) U701.11(AGND) U701.20(AGND) U701.23(AGND) U701.30(DGND) U701.41(DGND) ; also sheet 1,2,3,4,5,6,8,9,10,11,12
N$7: C720.2(C2) J702.3(R) R706.1 R707.2
N$9: C719.2(C2) J702.2(T) R710.1 R711.2
N$38: C718.2(C2) J701.3(R) R704.1 R705.2
N$39: C717.2(C2) J701.2(T) R708.1 R709.2
N$42: C714.2(C2) C715.2(C2) L702.1 R702.2
N$44: C712.2(C2) C713.2(C2) L701.1 R703.2
N$55: C721.1(C1) J703.3(R) L702.2
N$56: C722.1(C1) J703.2(T) L701.2
Unconnected: J701.4(DT) J702.4(DT) J703.4(DT) U701.21(HPOUTLN/LOUTLN) U701.25(HPOUTRN/LOUTRN) U701.38(XTALO)

## Sheet 8 of 13: PCI Express
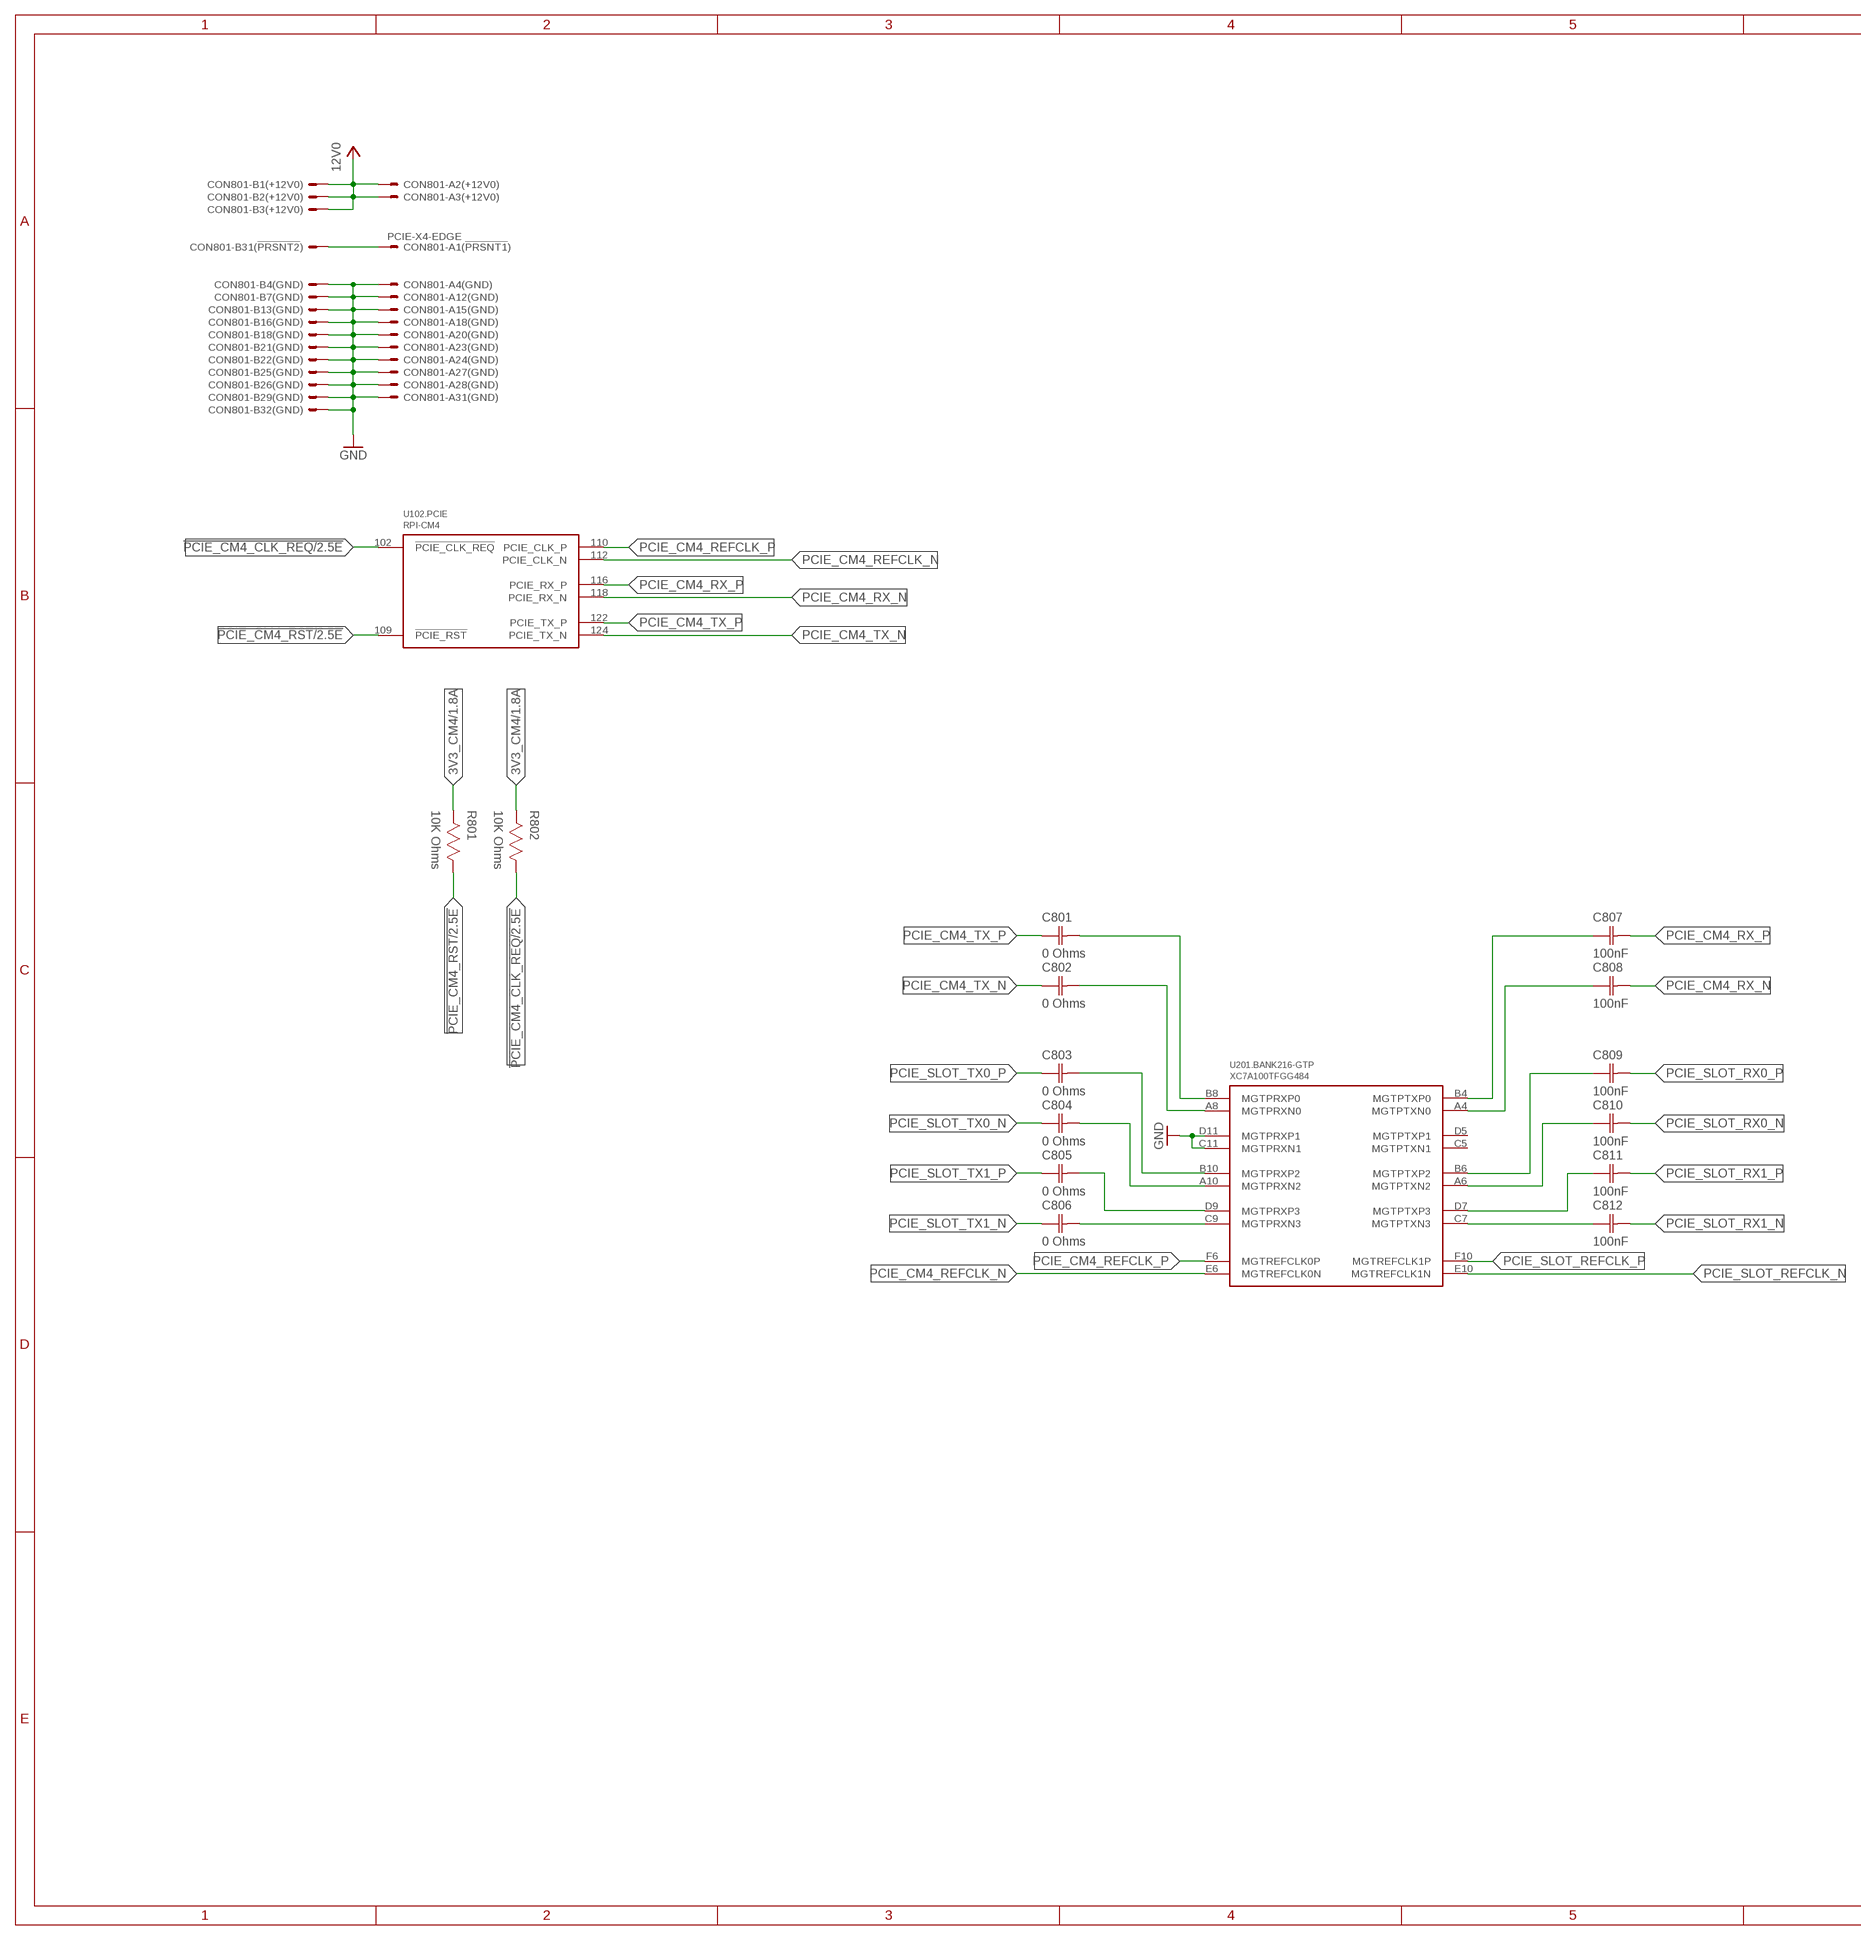
[diagram p14: schematic, sheet 8, part 1 of 2]
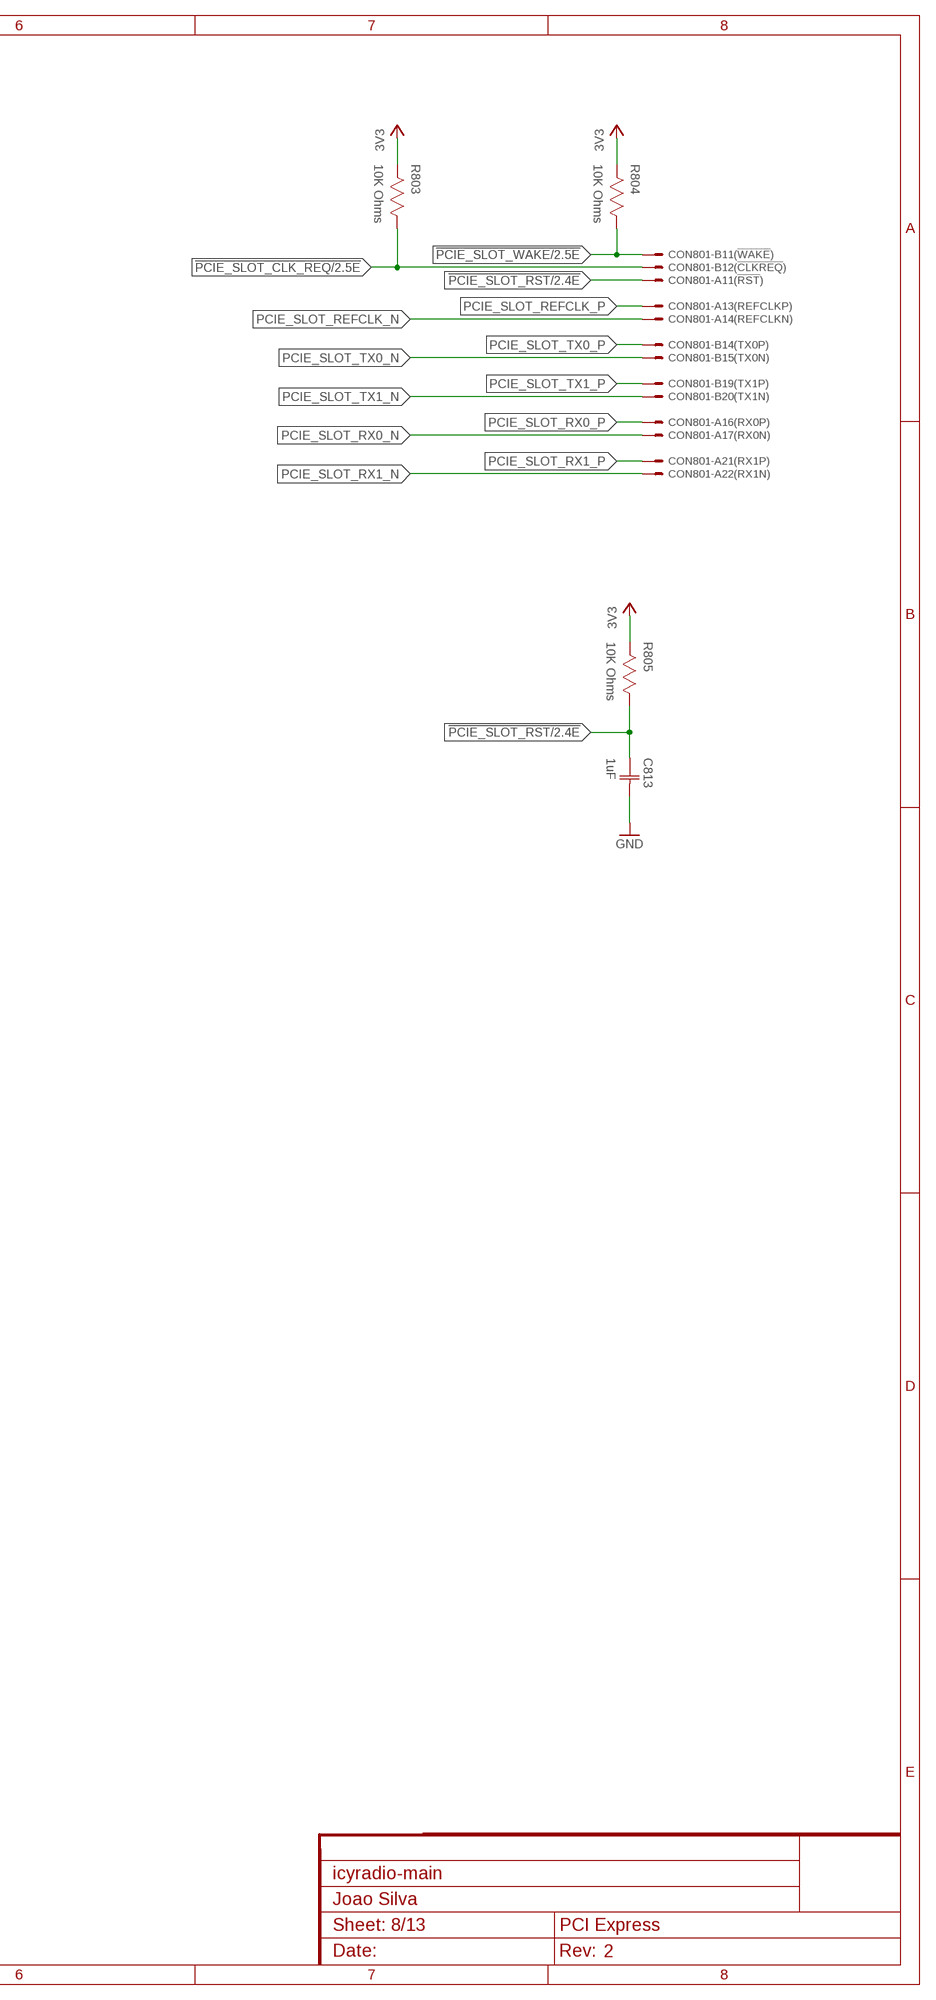
[diagram p15: schematic, sheet 8, part 2 of 2]

### Parts
C801  0 Ohms  CAPACITOR-0402  [CAP0402]
C802  0 Ohms  CAPACITOR-0402  [CAP0402]
C803  0 Ohms  CAPACITOR-0402  [CAP0402]
C804  0 Ohms  CAPACITOR-0402  [CAP0402]
C805  0 Ohms  CAPACITOR-0402  [CAP0402]
C806  0 Ohms  CAPACITOR-0402  [CAP0402]
C807  100nF  CAPACITOR-0402  [CAP0402]
C808  100nF  CAPACITOR-0402  [CAP0402]
C809  100nF  CAPACITOR-0402  [CAP0402]
C810  100nF  CAPACITOR-0402  [CAP0402]
C811  100nF  CAPACITOR-0402  [CAP0402]
C812  100nF  CAPACITOR-0402  [CAP0402]
C813  1uF  CAPACITOR-0402  [CAP0402]
CON801  PCIE-X4-EDGE  [PCIE-X4-EDGE]
R801  10K Ohms  RESISTOR-0402  [RES0402]
R802  10K Ohms  RESISTOR-0402  [RES0402]
R803  10K Ohms  RESISTOR-0402  [RES0402]
R804  10K Ohms  RESISTOR-0402  [RES0402]
R805  10K Ohms  RESISTOR-0402  [RES0402]

### Nets
3V3: R803.2 R804.2 R805.2 ; also sheet 2,7,9,10,11,12
3V3_CM4: R801.2 R802.2 ; also sheet 1
12V0: CON801.A2 CON801.A3 CON801.B1 CON801.B2 CON801.B3 ; also sheet 11
!PCIE_CM4_CLK_REQ: R802.1 U102.102(.PCIE:!PCIE_CLK_REQ) ; also sheet 2
!PCIE_CM4_RST: R801.1 U102.109(.PCIE:!PCIE_RST) ; also sheet 2
!PCIE_SLOT_CLK_REQ: CON801.B12 R803.1 ; also sheet 2
!PCIE_SLOT_PRSNT: CON801.A1 CON801.B31
!PCIE_SLOT_RST: C813.1(C1) CON801.A11 R805.1 ; also sheet 2
!PCIE_SLOT_WAKE: CON801.B11 R804.1 ; also sheet 2
GND: C813.2(C2) CON801.A4 CON801.A12 CON801.A15 CON801.A18 CON801.A20 CON801.A23 CON801.A24 CON801.A27 CON801.A28 CON801.A31 CON801.B4 CON801.B7 CON801.B13 CON801.B16 CON801.B18 CON801.B21 CON801.B22 CON801.B25 CON801.B26 CON801.B29 CON801.B32 U201.C11(.BANK216-GTP:MGTPRXN1) U201.D11(.BANK216-GTP:MGTPRXP1) ; also sheet 1,2,3,4,5,6,7,9,10,11,12
PCIE_CM4_REFCLK_N [CPWG 100 Ohm Differential]: U102.112(.PCIE:PCIE_CLK_N) U201.E6(.BANK216-GTP:MGTREFCLK0N)
PCIE_CM4_REFCLK_P [CPWG 100 Ohm Differential]: U102.110(.PCIE:PCIE_CLK_P) U201.F6(.BANK216-GTP:MGTREFCLK0P)
PCIE_CM4_RX_ACC_N [CPWG 100 Ohm Differential]: C808.1(C1) U201.A4(.BANK216-GTP:MGTPTXN0)
PCIE_CM4_RX_ACC_P [CPWG 100 Ohm Differential]: C807.1(C1) U201.B4(.BANK216-GTP:MGTPTXP0)
PCIE_CM4_RX_N [CPWG 100 Ohm Differential]: C808.2(C2) U102.118(.PCIE:PCIE_RX_N)
PCIE_CM4_RX_P [CPWG 100 Ohm Differential]: C807.2(C2) U102.116(.PCIE:PCIE_RX_P)
PCIE_CM4_TX_ACC_N [CPWG 100 Ohm Differential]: C802.2(C2) U201.A8(.BANK216-GTP:MGTPRXN0)
PCIE_CM4_TX_ACC_P [CPWG 100 Ohm Differential]: C801.2(C2) U201.B8(.BANK216-GTP:MGTPRXP0)
PCIE_CM4_TX_N [CPWG 100 Ohm Differential]: C802.1(C1) U102.124(.PCIE:PCIE_TX_N)
PCIE_CM4_TX_P [CPWG 100 Ohm Differential]: C801.1(C1) U102.122(.PCIE:PCIE_TX_P)
PCIE_SLOT_REFCLK_N [CPWG 100 Ohm Differential]: CON801.A14 U201.E10(.BANK216-GTP:MGTREFCLK1N)
PCIE_SLOT_REFCLK_P [CPWG 100 Ohm Differential]: CON801.A13 U201.F10(.BANK216-GTP:MGTREFCLK1P)
PCIE_SLOT_RX0_ACC_N [CPWG 100 Ohm Differential]: C810.1(C1) U201.A6(.BANK216-GTP:MGTPTXN2)
PCIE_SLOT_RX0_ACC_P [CPWG 100 Ohm Differential]: C809.1(C1) U201.B6(.BANK216-GTP:MGTPTXP2)
PCIE_SLOT_RX0_N [CPWG 100 Ohm Differential]: C810.2(C2) CON801.A17
PCIE_SLOT_RX0_P [CPWG 100 Ohm Differential]: C809.2(C2) CON801.A16
PCIE_SLOT_RX1_ACC_N [CPWG 100 Ohm Differential]: C812.1(C1) U201.C7(.BANK216-GTP:MGTPTXN3)
PCIE_SLOT_RX1_ACC_P [CPWG 100 Ohm Differential]: C811.1(C1) U201.D7(.BANK216-GTP:MGTPTXP3)
PCIE_SLOT_RX1_N [CPWG 100 Ohm Differential]: C812.2(C2) CON801.A22
PCIE_SLOT_RX1_P [CPWG 100 Ohm Differential]: C811.2(C2) CON801.A21
PCIE_SLOT_TX0_ACC_N [CPWG 100 Ohm Differential]: C804.2(C2) U201.A10(.BANK216-GTP:MGTPRXN2)
PCIE_SLOT_TX0_ACC_P [CPWG 100 Ohm Differential]: C803.2(C2) U201.B10(.BANK216-GTP:MGTPRXP2)
PCIE_SLOT_TX0_N [CPWG 100 Ohm Differential]: C804.1(C1) CON801.B15
PCIE_SLOT_TX0_P [CPWG 100 Ohm Differential]: C803.1(C1) CON801.B14
PCIE_SLOT_TX1_ACC_N [CPWG 100 Ohm Differential]: C806.2(C2) U201.C9(.BANK216-GTP:MGTPRXN3)
PCIE_SLOT_TX1_ACC_P [CPWG 100 Ohm Differential]: C805.2(C2) U201.D9(.BANK216-GTP:MGTPRXP3)
PCIE_SLOT_TX1_N [CPWG 100 Ohm Differential]: C806.1(C1) CON801.B20
PCIE_SLOT_TX1_P [CPWG 100 Ohm Differential]: C805.1(C1) CON801.B19
Unconnected: CON801.A5 CON801.A6 CON801.A7 CON801.A8 CON801.A9 CON801.A10 CON801.A19 CON801.A25 CON801.A26 CON801.A29 CON801.A30 CON801.A32 CON801.B5 CON801.B6 CON801.B8 CON801.B9 CON801.B10 CON801.B17 CON801.B23 CON801.B24 CON801.B27 CON801.B28 CON801.B30 U201.C5(.BANK216-GTP:MGTPTXN1) U201.D5(.BANK216-GTP:MGTPTXP1)

## Sheet 9 of 13: Clock generator
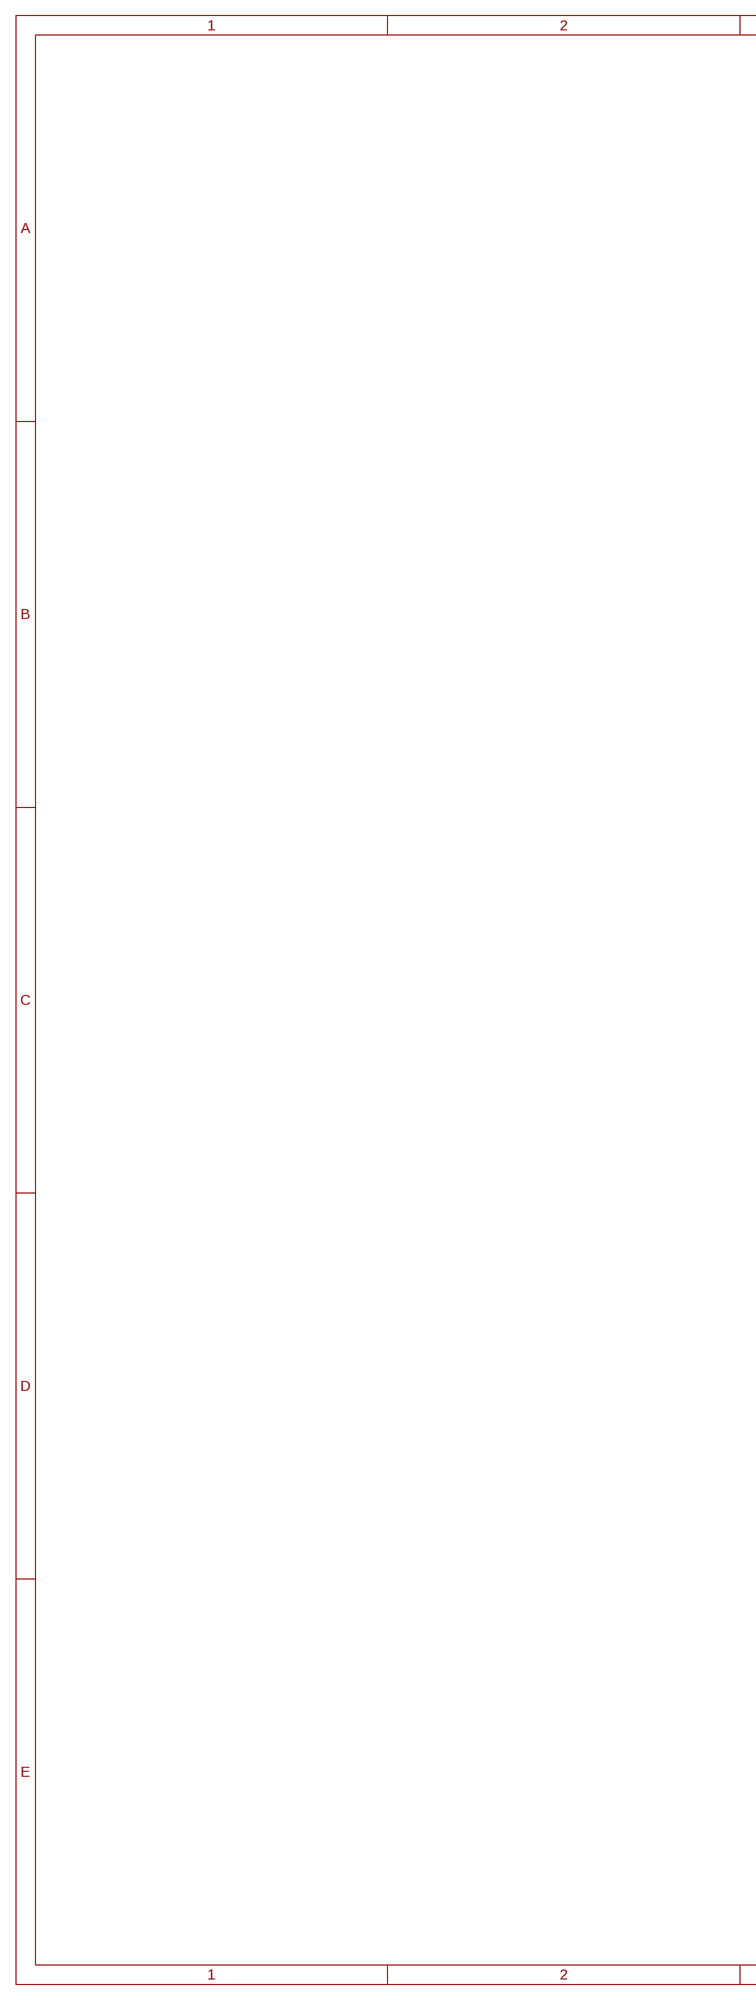
[diagram p16: schematic, sheet 9, part 1 of 2]
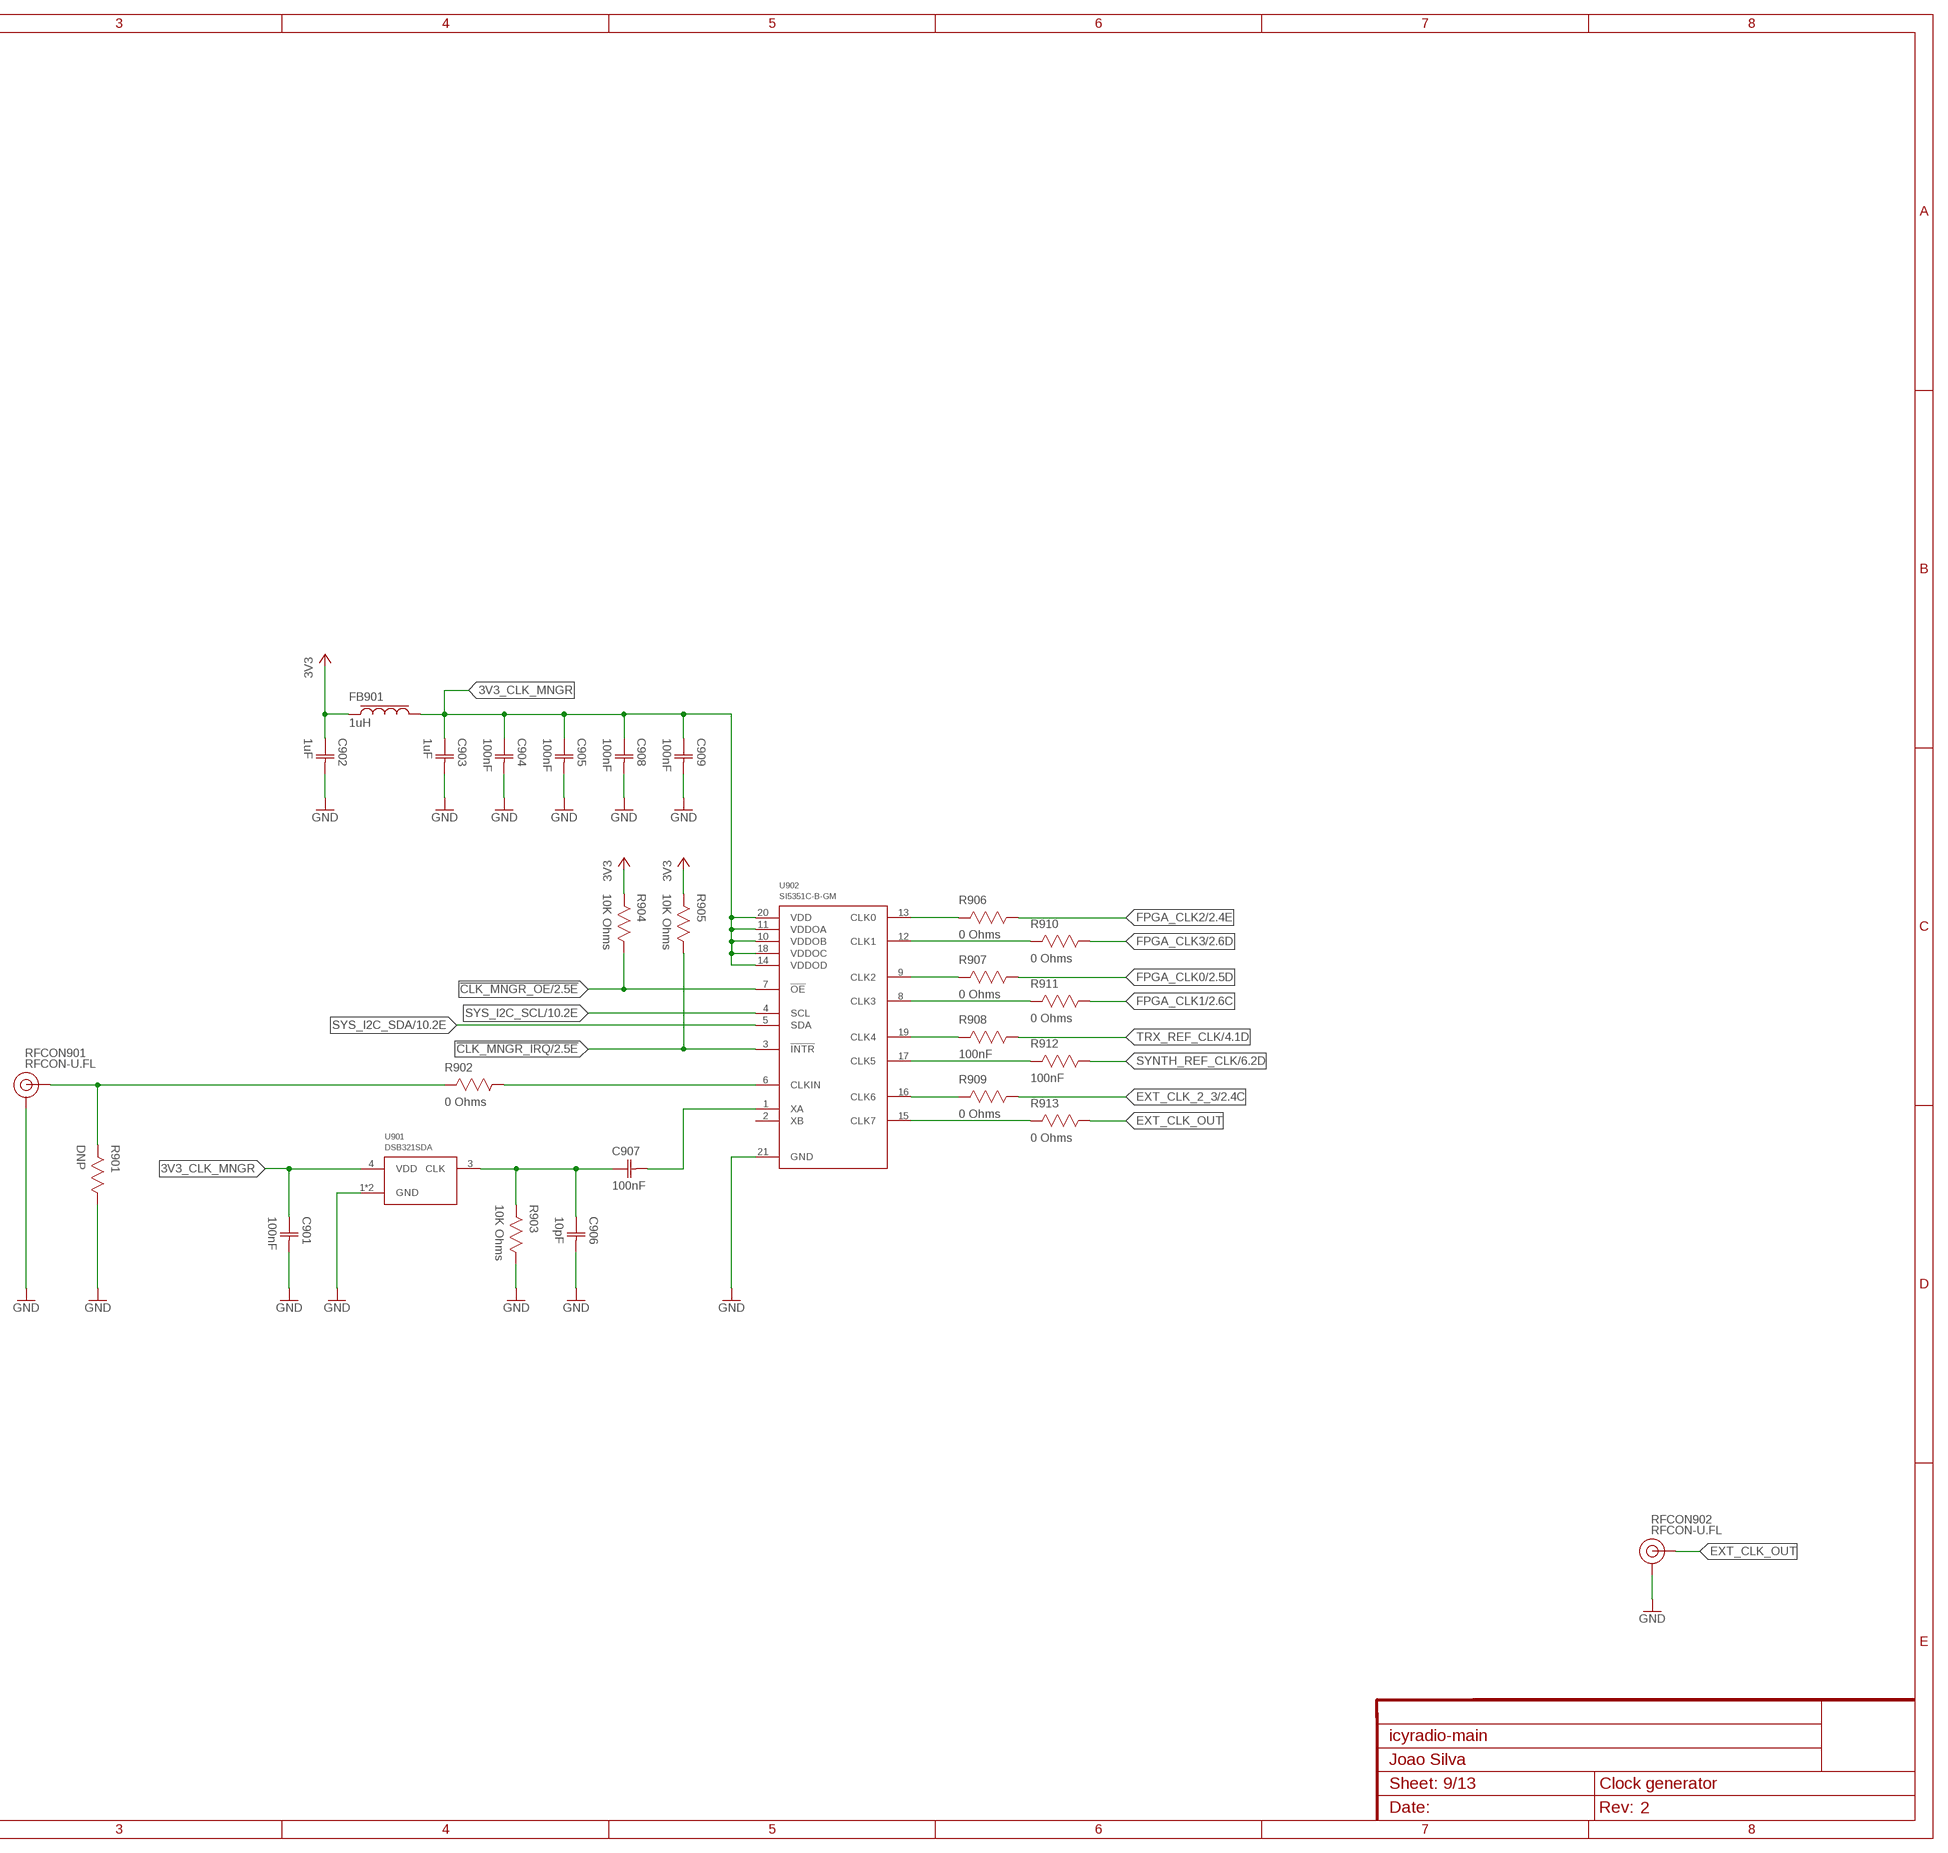
[diagram p17: schematic, sheet 9, part 2 of 2]

### Parts
C901  100nF  CAPACITOR-0402  [CAP0402]
C902  1uF  CAPACITOR-0402  [CAP0402]
C903  1uF  CAPACITOR-0402  [CAP0402]
C904  100nF  CAPACITOR-0402  [CAP0402]
C905  100nF  CAPACITOR-0402  [CAP0402]
C906  10pF  CAPACITOR-0402  [CAP0402]
C907  100nF  CAPACITOR-0402  [CAP0402]
C908  100nF  CAPACITOR-0402  [CAP0402]
C909  100nF  CAPACITOR-0402  [CAP0402]
FB901  1uH  FERRITE-0603  [IND0603]
R901  DNP  RESISTOR-0402  [RES0402]
R902  0 Ohms  RESISTOR-0402  [RES0402]
R903  10K Ohms  RESISTOR-0402  [RES0402]
R904  10K Ohms  RESISTOR-0402  [RES0402]
R905  10K Ohms  RESISTOR-0402  [RES0402]
R906  0 Ohms  RESISTOR-0402  [RES0402]
R907  0 Ohms  RESISTOR-0402  [RES0402]
R908  100nF  RESISTOR-0402  [RES0402]
R909  0 Ohms  RESISTOR-0402  [RES0402]
R910  0 Ohms  RESISTOR-0402  [RES0402]
R911  0 Ohms  RESISTOR-0402  [RES0402]
R912  100nF  RESISTOR-0402  [RES0402]
R913  0 Ohms  RESISTOR-0402  [RES0402]
RFCON901  RFCON-U.FL  [U.FL]
RFCON902  RFCON-U.FL  [U.FL]
U901  DSB321SDA  [TCXO-3225]
U902  SI5351C-B-GM  [QFN20]

### Nets
3V3: C902.1(C1) FB901.1 R904.2 R905.2 ; also sheet 2,7,8,10,11,12
3V3_CLK_MNGR: C901.1(C1) C903.1(C1) C904.1(C1) C905.1(C1) C908.1(C1) C909.1(C1) FB901.2 U901.4(VDD) U902.10(VDDOB) U902.11(VDDOA) U902.14(VDDOD) U902.18(VDDOC) U902.20(VDD)
!CLK_MNGR_IRQ: R905.1 U902.3(!INTR) ; also sheet 2
!CLK_MNGR_OE: R904.1 U902.7(!OE) ; also sheet 2
CLK_MNGR_CLK0: R906.2 U902.13(CLK0)
CLK_MNGR_CLK1: R910.2 U902.12(CLK1)
CLK_MNGR_CLK2: R907.2 U902.9(CLK2)
CLK_MNGR_CLK3: R911.2 U902.8(CLK3)
CLK_MNGR_CLK4: R908.2 U902.19(CLK4)
CLK_MNGR_CLK5: R912.2 U902.17(CLK5)
CLK_MNGR_CLK6: R909.2 U902.16(CLK6)
CLK_MNGR_CLK7: R913.2 U902.15(CLK7)
CLK_MNGR_CLKIN: R902.1 U902.6(CLKIN)
CLK_MNGR_EXT_REF: R901.2 R902.2 RFCON901.P$3(SIGNAL)
CLK_MNGR_REF_ACC: C907.2(C2) U902.1(XA)
CLK_MNGR_REF_DCC: C906.1(C1) C907.1(C1) R903.2 U901.3(CLK)
EXT_CLK_2_3 [CPWG 50 Ohm Single-Ended]: R909.1 ; also sheet 2
EXT_CLK_OUT [CPWG 50 Ohm Single-Ended]: R913.1 RFCON902.P$3(SIGNAL)
FPGA_CLK0: R907.1 ; also sheet 2
FPGA_CLK1: R911.1 ; also sheet 2
FPGA_CLK2: R906.1 ; also sheet 2
FPGA_CLK3: R910.1 ; also sheet 2
GND: C901.2(C2) C902.2(C2) C903.2(C2) C904.2(C2) C905.2(C2) C906.2(C2) C908.2(C2) C909.2(C2) R901.1 R903.1 RFCON901.P$1(GND) RFCON901.P$2(GND) RFCON902.P$1(GND) RFCON902.P$2(GND) U901.1(GND) U901.2(GND) U902.21(GND) ; also sheet 1,2,3,4,5,6,7,8,10,11,12
SYNTH_REF_CLK [CPWG 50 Ohm Single-Ended]: R912.1 ; also sheet 6
SYS_I2C_SCL: U902.4(SCL) ; also sheet 2,10
SYS_I2C_SDA: U902.5(SDA) ; also sheet 2,10
TRX_REF_CLK [CPWG 50 Ohm Single-Ended]: R908.1 ; also sheet 4
Unconnected: U902.2(XB)

## Sheet 10 of 13: Power Management
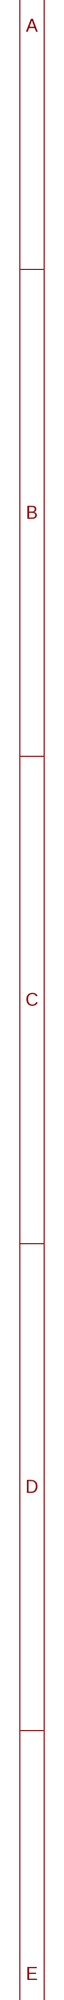
[diagram p18: schematic, sheet 10, part 1 of 2]
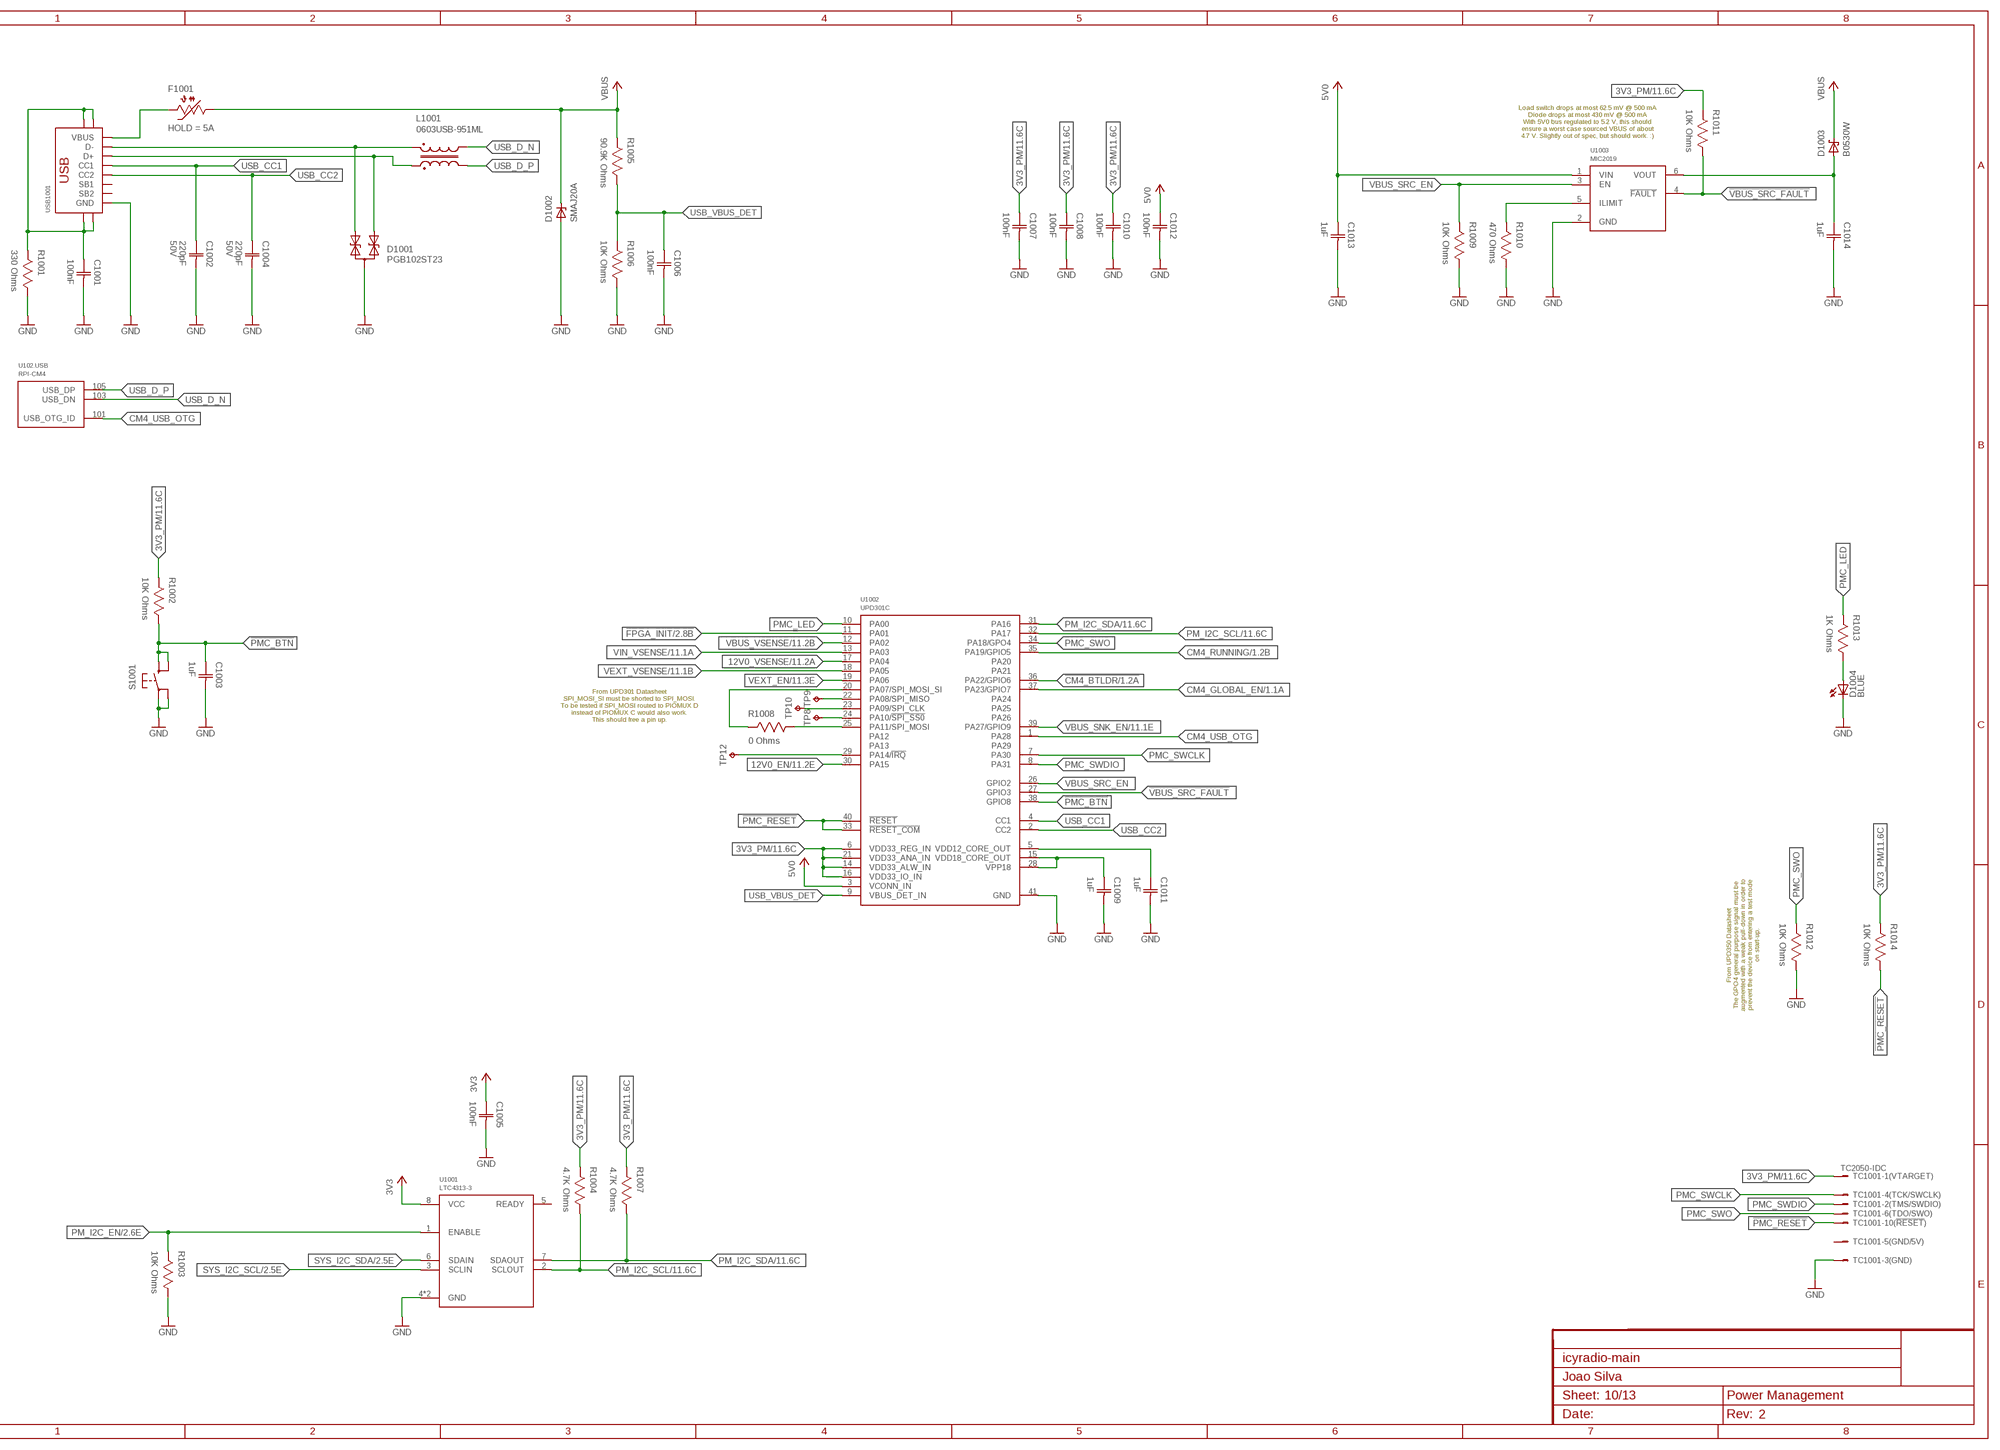
[diagram p19: schematic, sheet 10, part 2 of 2]

### Parts
C1001  100nF  CAPACITOR-0402  [CAP0402]
C1002  220pF  CAPACITOR-0402  [CAP0402]
C1003  1uF  CAPACITOR-0402  [CAP0402]
C1004  220pF  CAPACITOR-0402  [CAP0402]
C1005  100nF  CAPACITOR-0402  [CAP0402]
C1006  100nF  CAPACITOR-0402  [CAP0402]
C1007  100nF  CAPACITOR-0402  [CAP0402]
C1008  100nF  CAPACITOR-0402  [CAP0402]
C1009  1uF  CAPACITOR-0402  [CAP0402]
C1010  100nF  CAPACITOR-0402  [CAP0402]
C1011  1uF  CAPACITOR-0402  [CAP0402]
C1012  100nF  CAPACITOR-0402  [CAP0402]
C1013  1uF  CAPACITOR-0402  [CAP0402]
C1014  1uF  CAPACITOR-0402  [CAP0402]
D1001  PGB102ST23  [SOT23]
D1002  SMAJ20A  [DO214AC]
D1003  B0530W  [SOD-123]
D1004  LED0603  [0603]
F1001  PTC1206  [1206]
L1001  0603USB-951ML  [0603USB]
R1001  330 Ohms  RESISTOR-0402  [RES0402]
R1002  10K Ohms  RESISTOR-0402  [RES0402]
R1003  10K Ohms  RESISTOR-0402  [RES0402]
R1004  4.7K Ohms  RESISTOR-0402  [RES0402]
R1005  90.9K Ohms  RESISTOR-0402  [RES0402]
R1006  10K Ohms  RESISTOR-0402  [RES0402]
R1007  4.7K Ohms  RESISTOR-0402  [RES0402]
R1008  0 Ohms  RESISTOR-0402  [RES0402]
R1009  10K Ohms  RESISTOR-0402  [RES0402]
R1010  470 Ohms  RESISTOR-0402  [RES0402]
R1011  10K Ohms  RESISTOR-0402  [RES0402]
R1012  10K Ohms  RESISTOR-0402  [RES0402]
R1013  1K Ohms  RESISTOR-0402  [RES0402]
R1014  10K Ohms  RESISTOR-0402  [RES0402]
S1001  TAC_SWITCHSMD_4.5X4.5  [TAC_SW_SMD_4.5X4.5]
TC1001  TC2050-IDC  [TC2050-IDC]
TP8  TESTPOINT-0.7MM  [PAD0.7MM]
TP9  TESTPOINT-0.7MM  [PAD0.7MM]
TP10  TESTPOINT-0.7MM  [PAD0.7MM]
TP12  TESTPOINT-0.7MM  [PAD0.7MM]
U1001  LTC4313-3  [DFN8]
U1002  UPD301C  [VQFN40]
U1003  MIC2019  [SOT23-6]
USB1001  USB-C-16P-SMD-FLAT-SIDE-TYPE-2  [USB-C-16P-SMD-FLAT-SIDE-TYPE-2]

### Nets
3V3: C1005.1(C1) U1001.8(VCC) ; also sheet 2,7,8,9,11,12
3V3_PM: C1007.1(C1) C1008.1(C1) C1010.1(C1) R1002.2 R1004.2 R1007.2 R1011.2 R1014.2 TC1001.1 U1002.6(VDD33_REG_IN) U1002.14(VDD33_ALW_IN) U1002.16(VDD33_IO_IN) U1002.21(VDD33_ANA_IN) ; also sheet 11
5V0: C1012.1(C1) C1013.1(C1) U1002.3(VCONN_IN) U1003.1(VIN) ; also sheet 1,11,12
12V0_EN: U1002.30(PA15) ; also sheet 11
12V0_VSENSE: U1002.17(PA04) ; also sheet 11
!CM4_BTLDR: U1002.36(PA22/GPIO6) ; also sheet 1
!FPGA_INIT: U1002.11(PA01) ; also sheet 2
!PM_SPI_CS: TP8.TP U1002.24(PA10/!SPI_SS0!)
!PM_SPI_IRQ: TP12.TP U1002.29(PA14/!IRQ!)
!PMC_BTN: C1003.1(C1) R1002.1 S1001.3 S1001.4 U1002.38(GPIO8)
!PMC_RESET: R1014.1 TC1001.10 U1002.33(!RESET_COM) U1002.40(!RESET)
!VBUS_SRC_FAULT: R1011.1 U1002.27(GPIO3) U1003.4(!FAULT)
CM4_GLOBAL_EN: U1002.37(PA23/GPIO7) ; also sheet 1
CM4_RUNNING: U1002.35(PA19/GPIO5) ; also sheet 1
CM4_USB_OTG: U102.101(.USB:USB_OTG_ID) U1002.1(PA28)
GND: C1001.2(C2) C1002.2(C2) C1003.2(C2) C1004.2(C2) C1005.2(C2) C1006.2(C2) C1007.2(C2) C1008.2(C2) C1009.2(C2) C1010.2(C2) C1011.2(C2) C1012.2(C2) C1013.2(C2) C1014.2(C2) D1001.3(A) D1002.A D1004.C R1001.1 R1003.1 R1006.1 R1009.1 R1010.1 R1012.1 S1001.1 S1001.2 TC1001.3 U1001.4(GND) U1001.9(GND) U1002.41(GND) U1003.2(GND) USB1001.A1/B12(GND) USB1001.B1/A12(GND) ; also sheet 1,2,3,4,5,6,7,8,9,11,12
N$17: C1001.1(C1) R1001.2 USB1001.SHIELD@0(SHIELD) USB1001.SHIELD@1(SHIELD) USB1001.SHIELD@2(SHIELD) USB1001.SHIELD@3(SHIELD)
N$19: D1004.A R1013.1
N$32: C1009.1(C1) U1002.15(VDD18_CORE_OUT) U1002.28(VPP18)
N$93: C1011.1(C1) U1002.5(VDD12_CORE_OUT)
N$94: C1014.1(C1) D1003.A U1003.6(VOUT)
N$95: R1010.2 U1003.5(ILIMIT)
PM_I2C_EN: R1003.2 U1001.1(ENABLE) ; also sheet 2
PM_I2C_SCL: R1004.1 U1001.2(SCLOUT) U1002.32(PA17) ; also sheet 11
PM_I2C_SDA: R1007.1 U1001.7(SDAOUT) U1002.31(PA16) ; also sheet 11
PM_SPI_CLK: TP10.TP U1002.23(PA09/SPI_CLK)
PM_SPI_MISO: TP9.TP U1002.22(PA08/SPI_MISO)
PM_SPI_MOSI: R1008.1 U1002.25(PA11/SPI_MOSI)
PM_SPI_MOSI_SI: R1008.2 U1002.20(PA07/SPI_MOSI_SI)
PMC_LED: R1013.2 U1002.10(PA00)
PMC_SWCLK: TC1001.4 U1002.7(PA30)
PMC_SWDIO: TC1001.2 U1002.8(PA31)
PMC_SWO: R1012.2 TC1001.6 U1002.34(PA18/GPO4)
SYS_I2C_SCL: U1001.3(SCLIN) ; also sheet 2,9
SYS_I2C_SDA: U1001.6(SDAIN) ; also sheet 2,9
USB_CC1: C1002.1(C1) U1002.4(CC1) USB1001.A5(CC1)
USB_CC2: C1004.1(C1) U1002.2(CC2) USB1001.B5(CC2)
USB_D_N [CPWG 90 Ohm Differential]: L1001.2 U102.103(.USB:USB_DN)
USB_D_P [CPWG 90 Ohm Differential]: L1001.3 U102.105(.USB:USB_DP)
USB_D_UNFILT_N [CPWG 90 Ohm Differential]: D1001.1(C1) L1001.1 USB1001.A7(D-) USB1001.B7(D-)
USB_D_UNFILT_P [CPWG 90 Ohm Differential]: D1001.2(C2) L1001.4 USB1001.A6(D+) USB1001.B6(D+)
USB_VBUS_DET: C1006.1(C1) R1005.1 R1006.2 U1002.9(VBUS_DET_IN)
VBUS: D1002.C D1003.C F1001.1 R1005.2 ; also sheet 11
VBUS_SNK_EN: U1002.39(PA27/GPIO9) ; also sheet 11
VBUS_SRC_EN: R1009.2 U1002.26(GPIO2) U1003.3(EN)
VBUS_UNFUSED: F1001.2 USB1001.A4/B9(VBUS) USB1001.B4/A9(VBUS)
VBUS_VSENSE: U1002.12(PA02) ; also sheet 11
VEXT_EN: U1002.19(PA06) ; also sheet 11
VEXT_VSENSE: U1002.18(PA05) ; also sheet 11
VIN_VSENSE: U1002.13(PA03) ; also sheet 11
Unconnected: TC1001.5 TC1001.7 TC1001.8 TC1001.9 U1001.5(READY) USB1001.A8(SB1) USB1001.B8(SB2)

### Notes on the sheet
- Load switch drops at most 62.5 mV @ 500 mA
  Diode drops at most 430 mV @ 500 mA
  With 5V0 bus regulated to 5.2 V, this should
  ensure a worst case sourced VBUS of about
  4.7 V. Slightly out of spec, but should work. :)
- From UPD301 Datasheet
  SPI_MOSI_SI must be shorted to SPI_MOSI.
  To be tested if SPI_MOSI routed to PIOMUX D
  instead of PIOMUX C would also work.
  This should free a pin up.
- From UPD350 Datasheet
  The GPO4 general purpose signal must be
  augmented with a weak pull-down in order to
  prevent the device from entering a test mode
  on start-up.

## Sheet 11 of 13: Power
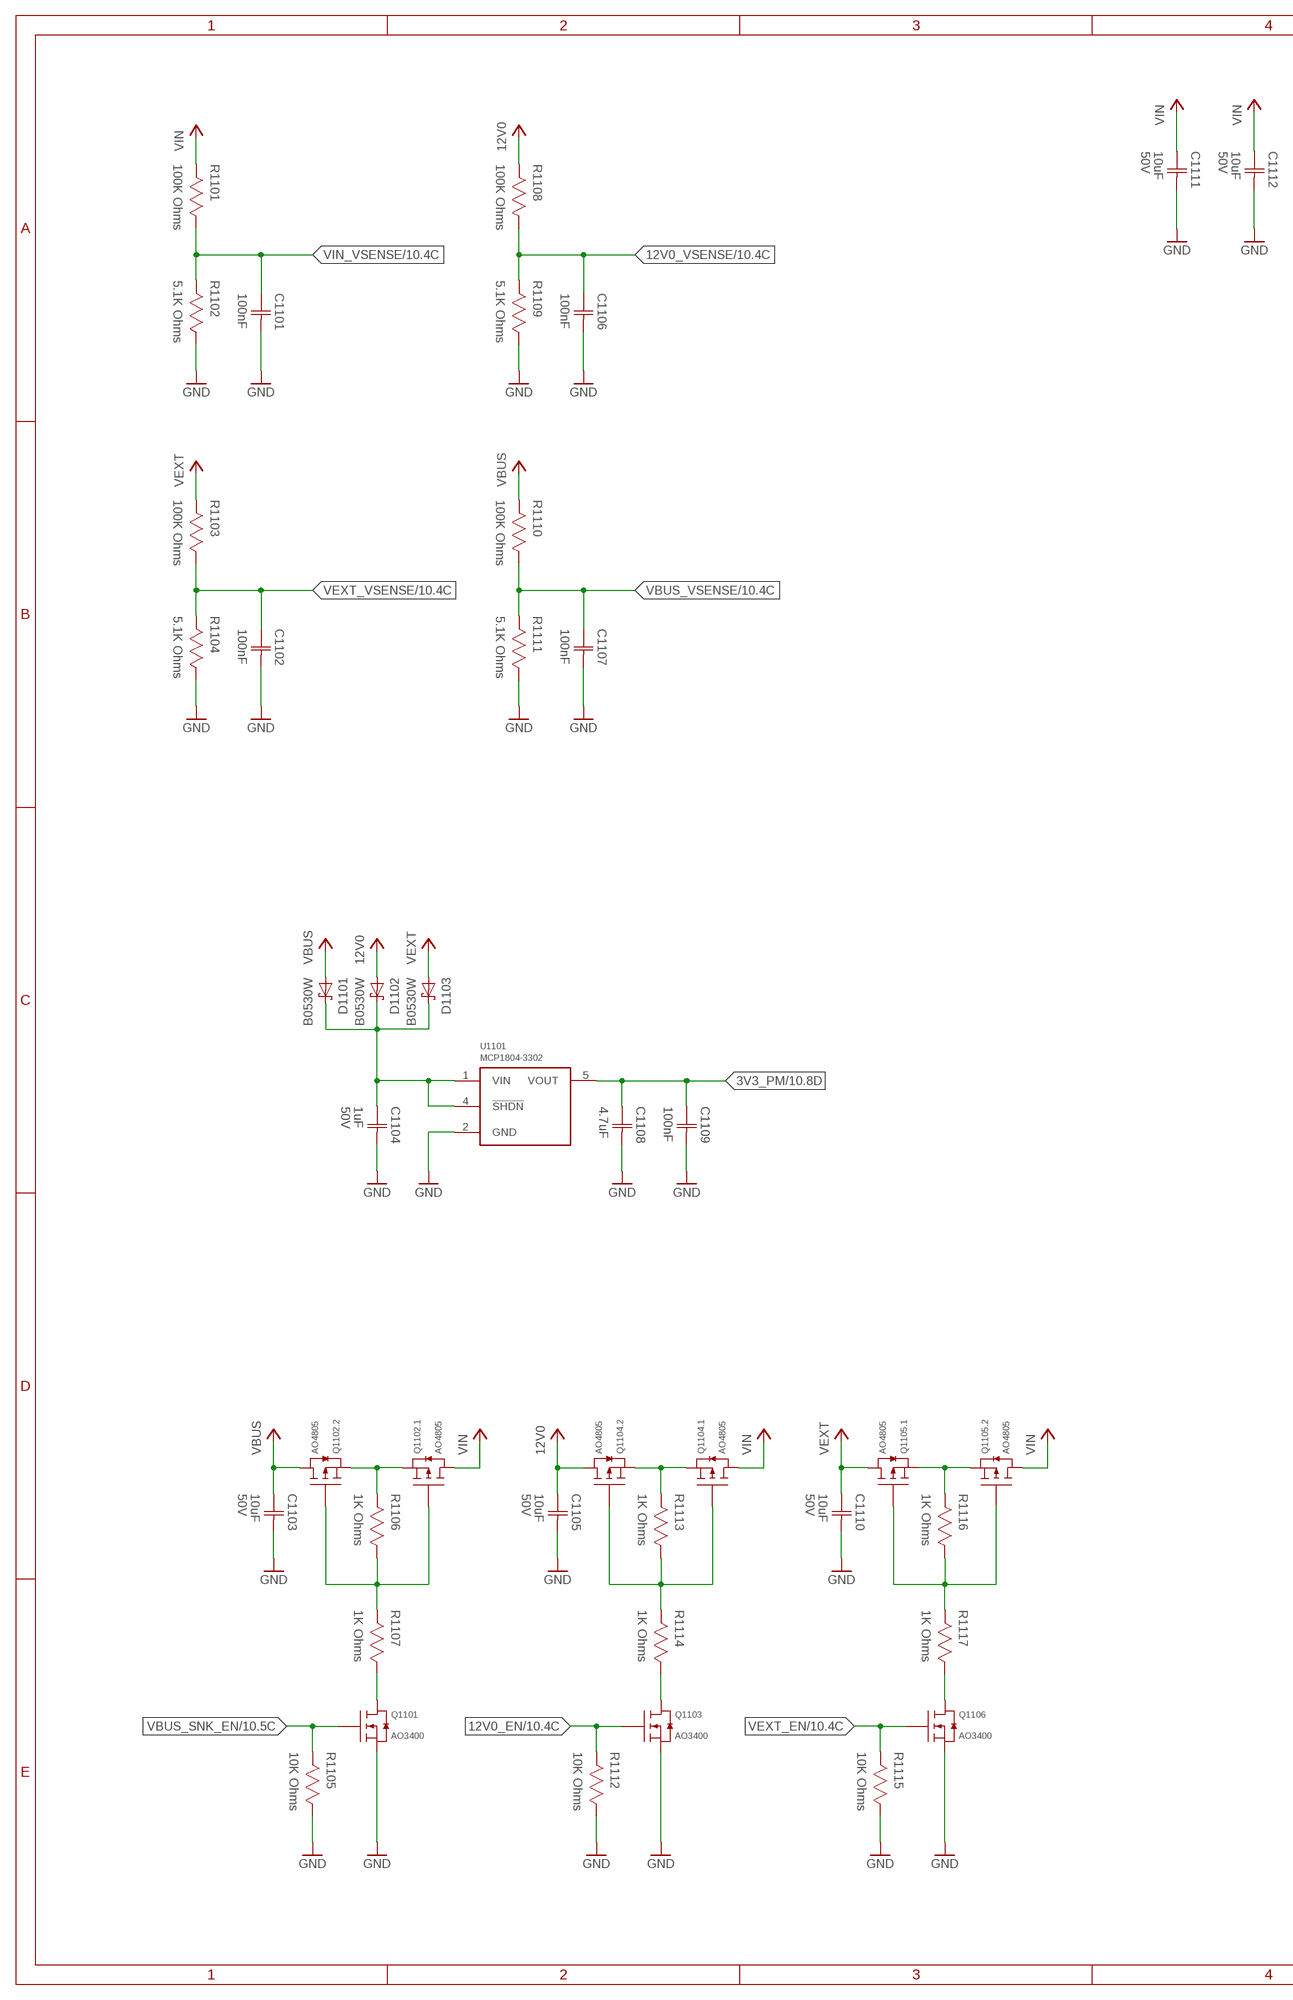
[diagram p20: schematic, sheet 11, part 1 of 2]
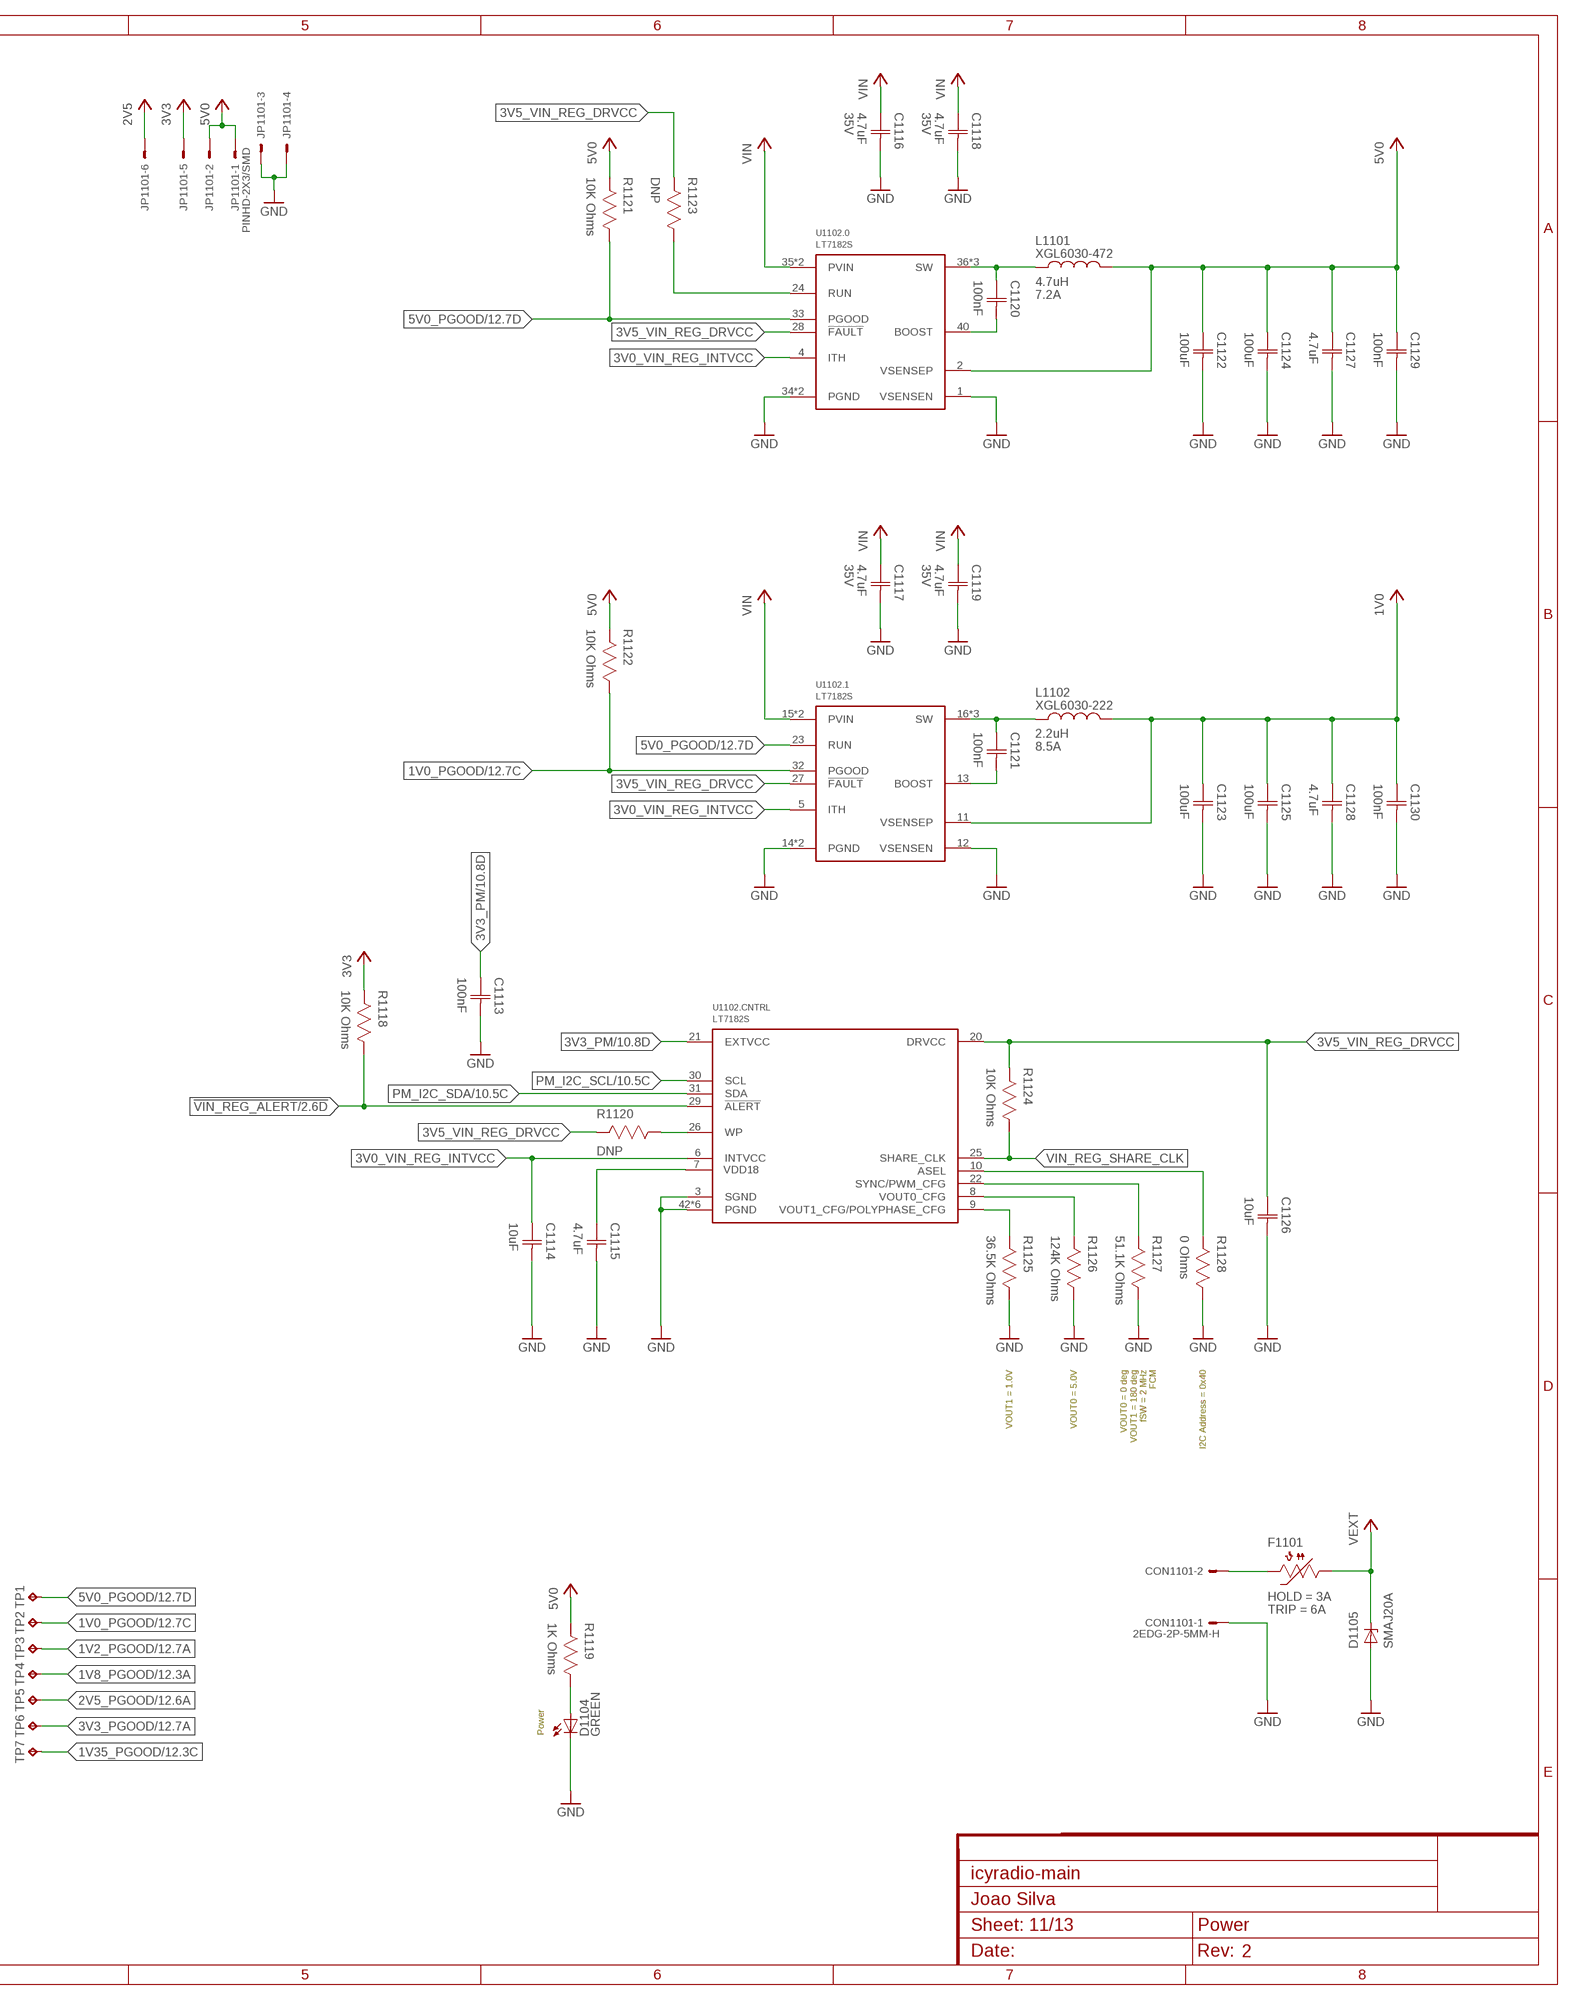
[diagram p21: schematic, sheet 11, part 2 of 2]

### Parts
C1101  100nF  CAPACITOR-0402  [CAP0402]
C1102  100nF  CAPACITOR-0402  [CAP0402]
C1103  10uF  CAPACITOR-1206  [CAP1206]
C1104  1uF  CAPACITOR-0603  [CAP0603]
C1105  10uF  CAPACITOR-1206  [CAP1206]
C1106  100nF  CAPACITOR-0402  [CAP0402]
C1107  100nF  CAPACITOR-0402  [CAP0402]
C1108  4.7uF  CAPACITOR-0402  [CAP0402]
C1109  100nF  CAPACITOR-0402  [CAP0402]
C1110  10uF  CAPACITOR-1206  [CAP1206]
C1111  10uF  CAPACITOR-1206  [CAP1206]
C1112  10uF  CAPACITOR-1206  [CAP1206]
C1113  100nF  CAPACITOR-0402  [CAP0402]
C1114  10uF  CAPACITOR-0402  [CAP0402]
C1115  4.7uF  CAPACITOR-0402  [CAP0402]
C1116  4.7uF  CAPACITOR-0603  [CAP0603]
C1117  4.7uF  CAPACITOR-0603  [CAP0603]
C1118  4.7uF  CAPACITOR-0603  [CAP0603]
C1119  4.7uF  CAPACITOR-0603  [CAP0603]
C1120  100nF  CAPACITOR-0402  [CAP0402]
C1121  100nF  CAPACITOR-0402  [CAP0402]
C1122  100uF  CAPACITOR-1206  [CAP1206]
C1123  100uF  CAPACITOR-1206  [CAP1206]
C1124  100uF  CAPACITOR-1206  [CAP1206]
C1125  100uF  CAPACITOR-1206  [CAP1206]
C1126  10uF  CAPACITOR-0402  [CAP0402]
C1127  4.7uF  CAPACITOR-0603  [CAP0603]
C1128  4.7uF  CAPACITOR-0402  [CAP0402]
C1129  100nF  CAPACITOR-0402  [CAP0402]
C1130  100nF  CAPACITOR-0402  [CAP0402]
CON1101  2EDG-2P-5MM-H  [2EDG-2P-5MM-H]
D1101  B0530W  [SOD-123]
D1102  B0530W  [SOD-123]
D1103  B0530W  [SOD-123]
D1104  LED0603  [0603]
D1105  SMAJ20A  [DO214AC]
F1101  2.6A Hold  PTC1206  [1206]
JP1101  PINHD-2X3/SMD  [2X03/SMD]
L1101  4.7uH  XGL6030-472  [XGL6030]
L1102  2.2uH  XGL6030-222  [XGL6030]
Q1101  AO3400  [SOT23]
Q1102  AO4805  [SOIC8]
Q1103  AO3400  [SOT23]
Q1104  AO4805  [SOIC8]
Q1105  AO4805  [SOIC8]
Q1106  AO3400  [SOT23]
R1101  100K Ohms  RESISTOR-0402  [RES0402]
R1102  5.1K Ohms  RESISTOR-0402  [RES0402]
R1103  100K Ohms  RESISTOR-0402  [RES0402]
R1104  5.1K Ohms  RESISTOR-0402  [RES0402]
R1105  10K Ohms  RESISTOR-0402  [RES0402]
R1106  1K Ohms  RESISTOR-0402  [RES0402]
R1107  1K Ohms  RESISTOR-0402  [RES0402]
R1108  100K Ohms  RESISTOR-0402  [RES0402]
R1109  5.1K Ohms  RESISTOR-0402  [RES0402]
R1110  100K Ohms  RESISTOR-0402  [RES0402]
R1111  5.1K Ohms  RESISTOR-0402  [RES0402]
R1112  10K Ohms  RESISTOR-0402  [RES0402]
R1113  1K Ohms  RESISTOR-0402  [RES0402]
R1114  1K Ohms  RESISTOR-0402  [RES0402]
R1115  10K Ohms  RESISTOR-0402  [RES0402]
R1116  1K Ohms  RESISTOR-0402  [RES0402]
R1117  1K Ohms  RESISTOR-0402  [RES0402]
R1118  10K Ohms  RESISTOR-0402  [RES0402]
R1119  1K Ohms  RESISTOR-0402  [RES0402]
R1120  DNP  RESISTOR-0402  [RES0402]
R1121  10K Ohms  RESISTOR-0402  [RES0402]
R1122  10K Ohms  RESISTOR-0402  [RES0402]
R1123  DNP  RESISTOR-0402  [RES0402]
R1124  10K Ohms  RESISTOR-0402  [RES0402]
R1125  36.5K Ohms  RESISTOR-0402  [RES0402]
R1126  124K Ohms  RESISTOR-0402  [RES0402]
R1127  51.1K Ohms  RESISTOR-0402  [RES0402]
R1128  0 Ohms  RESISTOR-0402  [RES0402]
TP1  TESTPOINT-0.7MM  [PAD0.7MM]
TP2  TESTPOINT-0.7MM  [PAD0.7MM]
TP3  TESTPOINT-0.7MM  [PAD0.7MM]
TP4  TESTPOINT-0.7MM  [PAD0.7MM]
TP5  TESTPOINT-0.7MM  [PAD0.7MM]
TP6  TESTPOINT-0.7MM  [PAD0.7MM]
TP7  TESTPOINT-0.7MM  [PAD0.7MM]
U1101  MCP1804-3302  [SOT23-5]
U1102  LT7182S  [LQFN40_ASYM_CORNER]

### Nets
1V0: C1123.1(C1) C1125.1(C1) C1128.1(C1) C1130.1(C1) L1102.2 U1102.11(.1:VSENSEP) ; also sheet 2
1V0_BOOST: C1121.2(C2) U1102.13(.1:BOOST)
1V0_PGOOD: R1122.1 TP2.TP U1102.32(.1:PGOOD) ; also sheet 12
1V0_SW: C1121.1(C1) L1102.1 U1102.16(.1:SW) U1102.17(.1:SW) U1102.44(.1:SW)
1V2_PGOOD: TP3.TP ; also sheet 12
1V8_PGOOD: TP4.TP ; also sheet 12
1V8_VIN_REG_VDD: C1115.1(C1) U1102.7(.CNTRL:VDD18)
1V35_PGOOD: TP7.TP ; also sheet 12
2V5: JP1101.6 ; also sheet 2,4,5,12
2V5_PGOOD: TP5.TP ; also sheet 12
3V0_VIN_REG_INTVCC: C1114.1(C1) U1102.4(.0:ITH) U1102.5(.1:ITH) U1102.6(.CNTRL:INTVCC)
3V3: JP1101.5 R1118.2 ; also sheet 2,7,8,9,10,12
3V3_PGOOD: TP6.TP ; also sheet 12
3V3_PM: C1108.1(C1) C1109.1(C1) C1113.1(C1) U1101.5(VOUT) U1102.21(.CNTRL:EXTVCC) ; also sheet 10
3V5_VIN_REG_DRVCC: C1126.1(C1) R1120.2 R1123.2 R1124.2 U1102.20(.CNTRL:DRVCC) U1102.27(.1:!FAULT) U1102.28(.0:!FAULT)
5V0: C1122.1(C1) C1124.1(C1) C1127.1(C1) C1129.1(C1) JP1101.1 JP1101.2 L1101.2 R1119.2 R1121.2 R1122.2 U1102.2(.0:VSENSEP) ; also sheet 1,10,12
5V0_BOOST: C1120.2(C2) U1102.40(.0:BOOST)
5V0_PGOOD: R1121.1 TP1.TP U1102.23(.1:RUN) U1102.33(.0:PGOOD) ; also sheet 12
5V0_SW: C1120.1(C1) L1101.1 U1102.36(.0:SW) U1102.37(.0:SW) U1102.41(.0:SW)
12V0: C1105.1(C1) D1102.A Q1104.5(.2:D) Q1104.6(.2:D) R1108.2 ; also sheet 8
12V0_EN: Q1103.1(G) R1112.2 ; also sheet 10
12V0_VSENSE: C1106.1(C1) R1108.1 R1109.2 ; also sheet 10
!VIN_REG_ALERT: R1118.1 U1102.29(.CNTRL:!ALERT) ; also sheet 2
GND: C1101.2(C2) C1102.2(C2) C1103.2(C2) C1104.2(C2) C1105.2(C2) C1106.2(C2) C1107.2(C2) C1108.2(C2) C1109.2(C2) C1110.2(C2) C1111.2(C2) C1112.2(C2) C1113.2(C2) C1114.2(C2) C1115.2(C2) C1116.2(C2) C1117.2(C2) C1118.2(C2) C1119.2(C2) C1122.2(C2) C1123.2(C2) C1124.2(C2) C1125.2(C2) C1126.2(C2) C1127.2(C2) C1128.2(C2) C1129.2(C2) C1130.2(C2) CON1101.P$1 D1104.C D1105.A JP1101.3 JP1101.4 Q1101.2(S) Q1103.2(S) Q1106.2(S) R1102.1 R1104.1 R1105.1 R1109.1 R1111.1 R1112.1 R1115.1 R1125.1 R1126.1 R1127.1 R1128.1 U1101.2(GND) U1102.1(.0:VSENSEN) U1102.3(.CNTRL:SGND) U1102.12(.1:VSENSEN) U1102.14(.1:PGND) U1102.19(.1:PGND) U1102.34(.0:PGND) U1102.39(.0:PGND) U1102.42(.CNTRL:PGND) U1102.43(.CNTRL:PGND) U1102.45(.CNTRL:PGND) U1102.46(.CNTRL:PGND) U1102.47(.CNTRL:PGND) U1102.48(.CNTRL:PGND) ; also sheet 1,2,3,4,5,6,7,8,9,10,12
N$4: Q1102.1(.1:S) Q1102.3(.2:S) R1106.2
N$21: Q1102.2(.1:G) Q1102.4(.2:G) R1106.1 R1107.2
N$36: Q1101.3(D) R1107.1
N$47: Q1104.1(.1:S) Q1104.3(.2:S) R1113.2
N$49: Q1104.2(.1:G) Q1104.4(.2:G) R1113.1 R1114.2
N$52: Q1103.3(D) R1114.1
N$60: Q1105.1(.1:S) Q1105.3(.2:S) R1116.2
N$90: Q1105.2(.1:G) Q1105.4(.2:G) R1116.1 R1117.2
N$91: Q1106.3(D) R1117.1
N$148: D1104.A R1119.1
PM_I2C_SCL: U1102.30(.CNTRL:SCL) ; also sheet 10
PM_I2C_SDA: U1102.31(.CNTRL:SDA) ; also sheet 10
VBUS: C1103.1(C1) D1101.A Q1102.5(.2:D) Q1102.6(.2:D) R1110.2 ; also sheet 10
VBUS_SNK_EN: Q1101.1(G) R1105.2 ; also sheet 10
VBUS_VSENSE: C1107.1(C1) R1110.1 R1111.2 ; also sheet 10
VEXT: C1110.1(C1) D1103.A D1105.C F1101.1 Q1105.7(.1:D) Q1105.8(.1:D) R1103.2
VEXT_EN: Q1106.1(G) R1115.2 ; also sheet 10
VEXT_UNFUSED: CON1101.P$2 F1101.2
VEXT_VSENSE: C1102.1(C1) R1103.1 R1104.2 ; also sheet 10
VIN: C1111.1(C1) C1112.1(C1) C1116.1(C1) C1117.1(C1) C1118.1(C1) C1119.1(C1) Q1102.7(.1:D) Q1102.8(.1:D) Q1104.7(.1:D) Q1104.8(.1:D) Q1105.5(.2:D) Q1105.6(.2:D) R1101.2 U1102.15(.1:PVIN) U1102.18(.1:PVIN) U1102.35(.0:PVIN) U1102.38(.0:PVIN)
VIN_PM: C1104.1(C1) D1101.C D1102.C D1103.C U1101.1(VIN) U1101.4(!SHDN)
VIN_REG_ASEL: R1128.2 U1102.10(.CNTRL:ASEL)
VIN_REG_PWM_CFG: R1127.2 U1102.22(.CNTRL:SYNC/PWM_CFG)
VIN_REG_RUN0: R1123.1 U1102.24(.0:RUN)
VIN_REG_SHARE_CLK: R1124.1 U1102.25(.CNTRL:SHARE_CLK)
VIN_REG_VOUT0_CFG: R1126.2 U1102.8(.CNTRL:VOUT0_CFG)
VIN_REG_VOUT1_CFG: R1125.2 U1102.9(.CNTRL:VOUT1_CFG/POLYPHASE_CFG)
VIN_REG_WP: R1120.1 U1102.26(.CNTRL:WP)
VIN_VSENSE: C1101.1(C1) R1101.1 R1102.2 ; also sheet 10

### Notes on the sheet
- VOUT1 = 1.0V | VOUT0 = 5.0V
- VOUT0 = 0 deg
  VOUT1 = 180 deg
  fSW = 2 MHz
  FCM
- I2C Address = 0x40
- Power

## Sheet 12 of 13: Power
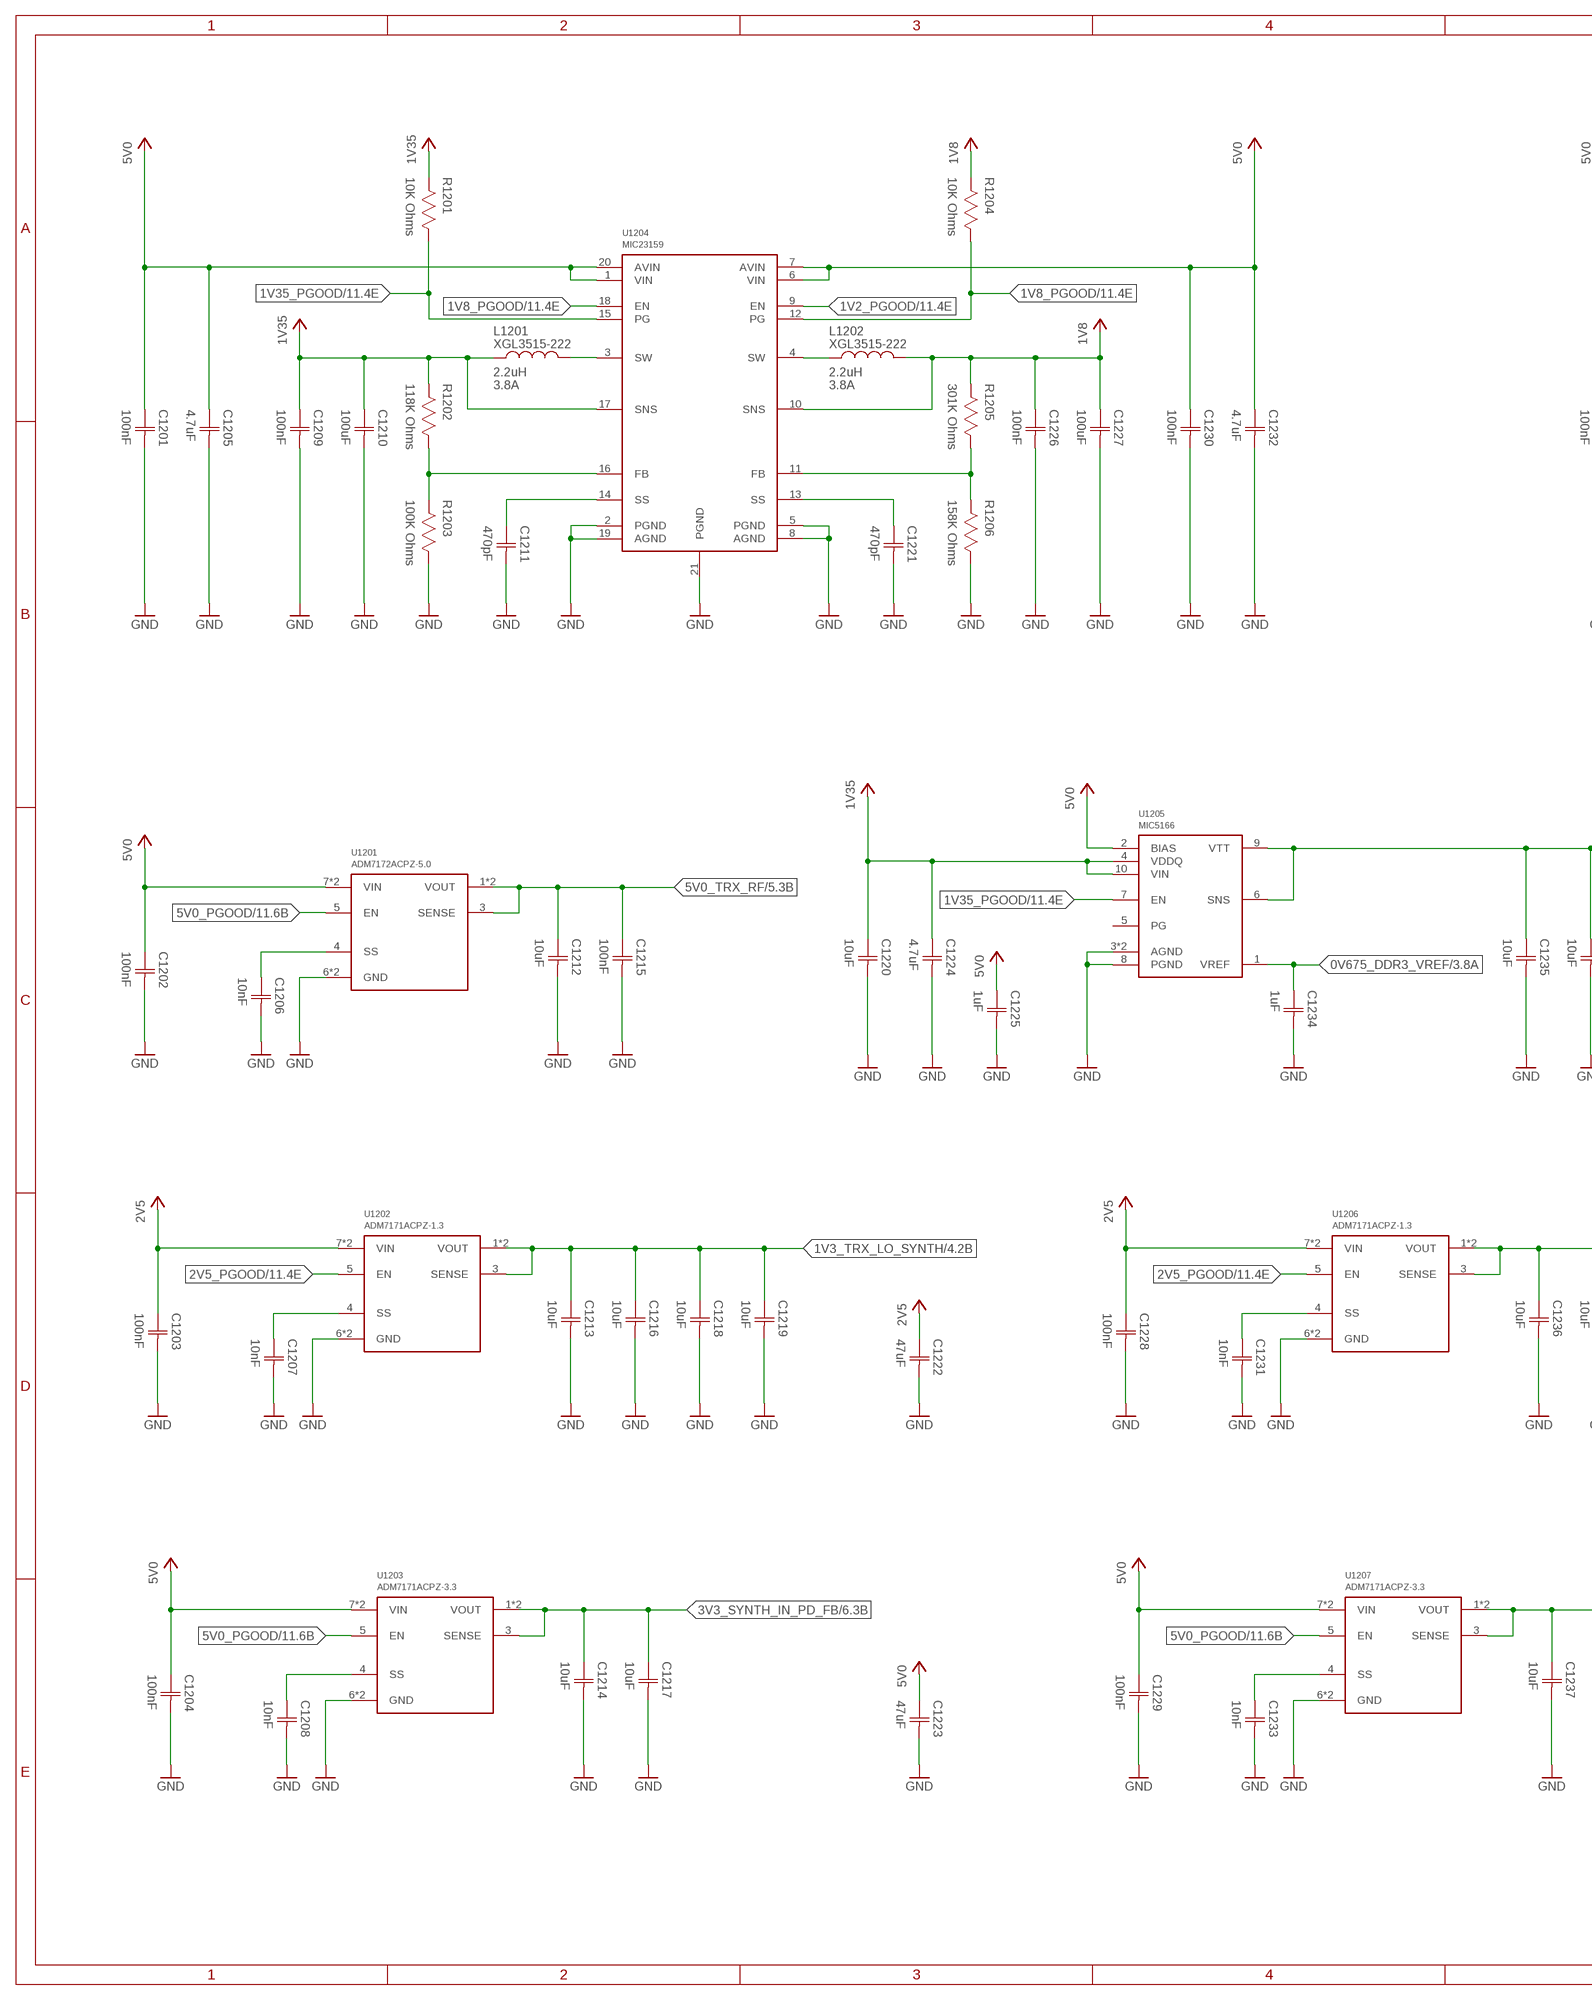
[diagram p22: schematic, sheet 12, part 1 of 2]
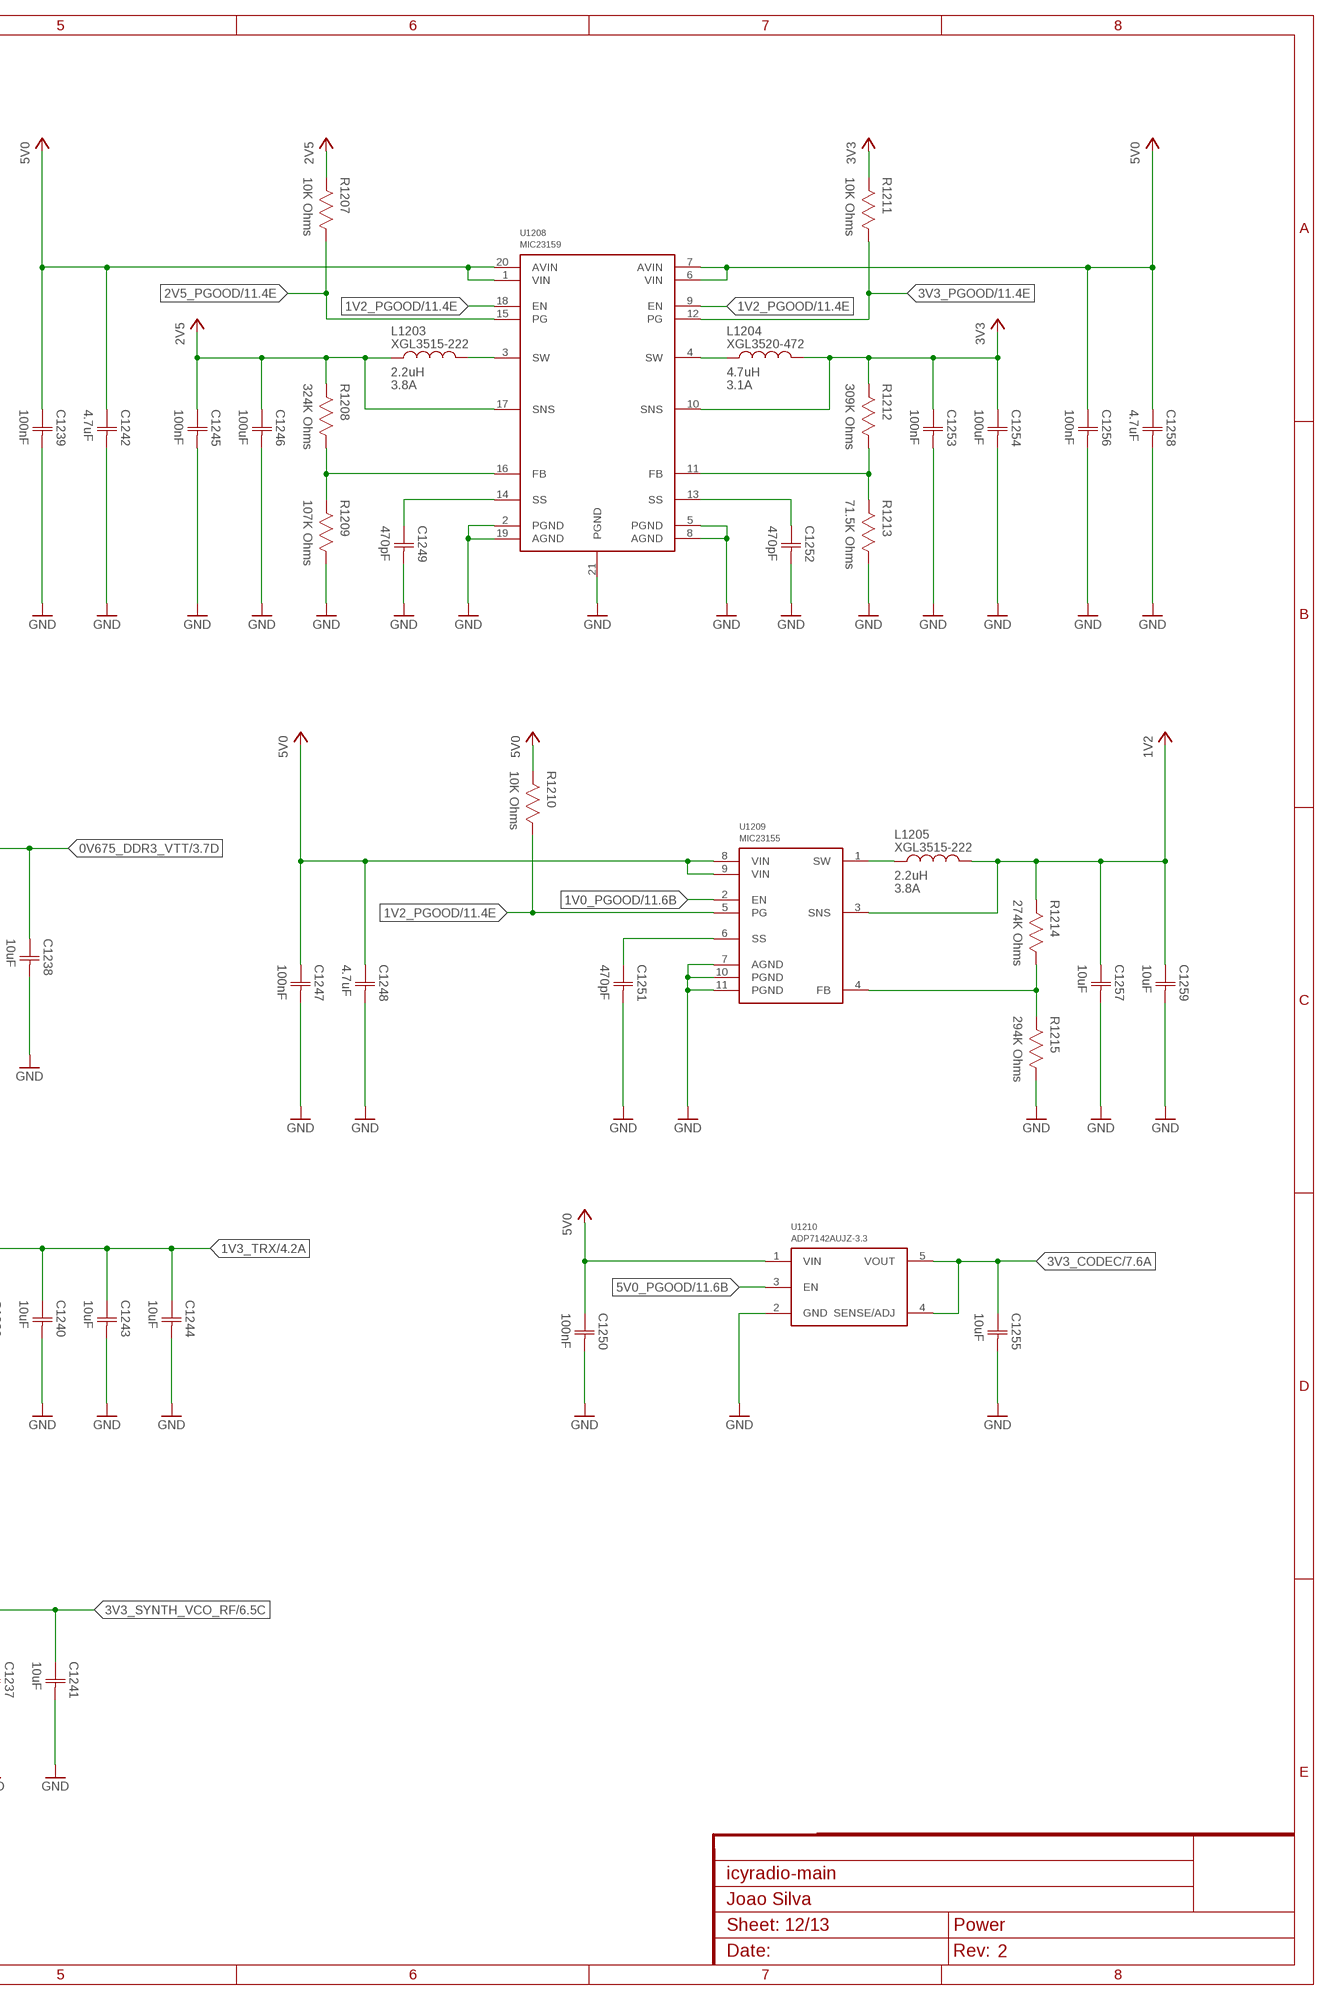
[diagram p23: schematic, sheet 12, part 2 of 2]

### Parts
C1201  100nF  CAPACITOR-0402  [CAP0402]
C1202  100nF  CAPACITOR-0402  [CAP0402]
C1203  100nF  CAPACITOR-0402  [CAP0402]
C1204  100nF  CAPACITOR-0402  [CAP0402]
C1205  4.7uF  CAPACITOR-0603  [CAP0603]
C1206  10nF  CAPACITOR-0402  [CAP0402]
C1207  10nF  CAPACITOR-0402  [CAP0402]
C1208  10nF  CAPACITOR-0402  [CAP0402]
C1209  100nF  CAPACITOR-0402  [CAP0402]
C1210  100uF  CAPACITOR-1206  [CAP1206]
C1211  470pF  CAPACITOR-0402  [CAP0402]
C1212  10uF  CAPACITOR-0603  [CAP0603]
C1213  10uF  CAPACITOR-0402  [CAP0402]
C1214  10uF  CAPACITOR-0402  [CAP0402]
C1215  100nF  CAPACITOR-0402  [CAP0402]
C1216  10uF  CAPACITOR-0402  [CAP0402]
C1217  10uF  CAPACITOR-0402  [CAP0402]
C1218  10uF  CAPACITOR-0402  [CAP0402]
C1219  10uF  CAPACITOR-0402  [CAP0402]
C1220  10uF  CAPACITOR-0402  [CAP0402]
C1221  470pF  CAPACITOR-0402  [CAP0402]
C1222  47uF  CAPACITOR-0603  [CAP0603]
C1223  47uF  CAPACITOR-0603  [CAP0603]
C1224  4.7uF  CAPACITOR-0402  [CAP0402]
C1225  1uF  CAPACITOR-0402  [CAP0402]
C1226  100nF  CAPACITOR-0402  [CAP0402]
C1227  100uF  CAPACITOR-1206  [CAP1206]
C1228  100nF  CAPACITOR-0402  [CAP0402]
C1229  100nF  CAPACITOR-0402  [CAP0402]
C1230  100nF  CAPACITOR-0402  [CAP0402]
C1231  10nF  CAPACITOR-0402  [CAP0402]
C1232  4.7uF  CAPACITOR-0603  [CAP0603]
C1233  10nF  CAPACITOR-0402  [CAP0402]
C1234  1uF  CAPACITOR-0402  [CAP0402]
C1235  10uF  CAPACITOR-0402  [CAP0402]
C1236  10uF  CAPACITOR-0402  [CAP0402]
C1237  10uF  CAPACITOR-0402  [CAP0402]
C1238  10uF  CAPACITOR-0402  [CAP0402]
C1239  100nF  CAPACITOR-0402  [CAP0402]
C1240  10uF  CAPACITOR-0402  [CAP0402]
C1241  10uF  CAPACITOR-0402  [CAP0402]
C1242  4.7uF  CAPACITOR-0603  [CAP0603]
C1243  10uF  CAPACITOR-0402  [CAP0402]
C1244  10uF  CAPACITOR-0402  [CAP0402]
C1245  100nF  CAPACITOR-0402  [CAP0402]
C1246  100uF  CAPACITOR-1206  [CAP1206]
C1247  100nF  CAPACITOR-0402  [CAP0402]
C1248  4.7uF  CAPACITOR-0603  [CAP0603]
C1249  470pF  CAPACITOR-0402  [CAP0402]
C1250  100nF  CAPACITOR-0402  [CAP0402]
C1251  470pF  CAPACITOR-0402  [CAP0402]
C1252  470pF  CAPACITOR-0402  [CAP0402]
C1253  100nF  CAPACITOR-0402  [CAP0402]
C1254  100uF  CAPACITOR-1206  [CAP1206]
C1255  10uF  CAPACITOR-0402  [CAP0402]
C1256  100nF  CAPACITOR-0402  [CAP0402]
C1257  10uF  CAPACITOR-0402  [CAP0402]
C1258  4.7uF  CAPACITOR-0603  [CAP0603]
C1259  10uF  CAPACITOR-0402  [CAP0402]
L1201  2.2uH  XGL3515-222  [XGL35XX]
L1202  2.2uH  XGL3515-222  [XGL35XX]
L1203  2.2uH  XGL3515-222  [XGL35XX]
L1204  4.7uH  XGL3520-472  [XGL35XX]
L1205  2.2uH  XGL3515-222  [XGL35XX]
R1201  10K Ohms  RESISTOR-0402  [RES0402]
R1202  118K Ohms  RESISTOR-0402  [RES0402]
R1203  100K Ohms  RESISTOR-0402  [RES0402]
R1204  10K Ohms  RESISTOR-0402  [RES0402]
R1205  301K Ohms  RESISTOR-0402  [RES0402]
R1206  158K Ohms  RESISTOR-0402  [RES0402]
R1207  10K Ohms  RESISTOR-0402  [RES0402]
R1208  324K Ohms  RESISTOR-0402  [RES0402]
R1209  107K Ohms  RESISTOR-0402  [RES0402]
R1210  10K Ohms  RESISTOR-0402  [RES0402]
R1211  10K Ohms  RESISTOR-0402  [RES0402]
R1212  309K Ohms  RESISTOR-0402  [RES0402]
R1213  71.5K Ohms  RESISTOR-0402  [RES0402]
R1214  274K Ohms  RESISTOR-0402  [RES0402]
R1215  294K Ohms  RESISTOR-0402  [RES0402]
U1201  ADM7172ACPZ-5.0  [LFCSP8_3X3]
U1202  ADM7171ACPZ-1.3  [LFCSP8_3X3]
U1203  ADM7171ACPZ-3.3  [LFCSP8_3X3]
U1204  MIC23159  [VQFN20]
U1205  MIC5166  [DFN10]
U1206  ADM7171ACPZ-1.3  [LFCSP8_3X3]
U1207  ADM7171ACPZ-3.3  [LFCSP8_3X3]
U1208  MIC23159  [VQFN20]
U1209  MIC23155  [DFN10_0.65P]
U1210  ADP7142AUJZ-3.3  [SOT23-5]

### Nets
0V675_DDR3_VREF: C1234.1(C1) U1205.1(VREF) ; also sheet 3
0V675_DDR3_VTT: C1235.1(C1) C1238.1(C1) U1205.6(SNS) U1205.9(VTT) ; also sheet 3
1V0_PGOOD: U1209.2(EN) ; also sheet 11
1V2: C1257.1(C1) C1259.1(C1) L1205.2 R1214.2 U1209.3(SNS) ; also sheet 2
1V2_FB: R1214.1 R1215.2 U1209.4(FB)
1V2_PGOOD: R1210.1 U1204.9(EN) U1208.9(EN) U1208.18(EN) U1209.5(PG) ; also sheet 11
1V2_SS: C1251.1(C1) U1209.6(SS)
1V2_SW: L1205.1 U1209.1(SW)
1V3_TRX: C1236.1(C1) C1240.1(C1) C1243.1(C1) C1244.1(C1) U1206.1(VOUT) U1206.2(VOUT) U1206.3(SENSE) ; also sheet 4,5
1V3_TRX_LO_SYNTH: C1213.1(C1) C1216.1(C1) C1218.1(C1) C1219.1(C1) U1202.1(VOUT) U1202.2(VOUT) U1202.3(SENSE) ; also sheet 4
1V8: C1226.1(C1) C1227.1(C1) L1202.2 R1204.2 R1205.2 U1204.10(SNS) ; also sheet 2
1V8_FB: R1205.1 R1206.2 U1204.11(FB)
1V8_PGOOD: R1204.1 U1204.12(PG) U1204.18(EN) ; also sheet 11
1V8_SS: C1221.1(C1) U1204.13(SS)
1V8_SW: L1202.1 U1204.4(SW)
1V35: C1209.1(C1) C1210.1(C1) C1220.1(C1) C1224.1(C1) L1201.1 R1201.2 R1202.2 U1204.17(SNS) U1205.4(VDDQ) U1205.10(VIN) ; also sheet 2,3
1V35_FB: R1202.1 R1203.2 U1204.16(FB)
1V35_PGOOD: R1201.1 U1204.15(PG) U1205.7(EN) ; also sheet 11
1V35_SS: C1211.1(C1) U1204.14(SS)
1V35_SW: L1201.2 U1204.3(SW)
2V5: C1203.1(C1) C1222.1(C1) C1228.1(C1) C1245.1(C1) C1246.1(C1) L1203.1 R1207.2 R1208.2 U1202.7(VIN) U1202.8(VIN) U1206.7(VIN) U1206.8(VIN) U1208.17(SNS) ; also sheet 2,4,5,11
2V5_FB: R1208.1 R1209.2 U1208.16(FB)
2V5_PGOOD: R1207.1 U1202.5(EN) U1206.5(EN) U1208.15(PG) ; also sheet 11
2V5_SS: C1249.1(C1) U1208.14(SS)
2V5_SW: L1203.2 U1208.3(SW)
3V3: C1253.1(C1) C1254.1(C1) L1204.2 R1211.2 R1212.2 U1208.10(SNS) ; also sheet 2,7,8,9,10,11
3V3_CODEC: C1255.1(C1) U1210.4(SENSE/ADJ) U1210.5(VOUT) ; also sheet 7
3V3_FB: R1212.1 R1213.2 U1208.11(FB)
3V3_PGOOD: R1211.1 U1208.12(PG) ; also sheet 11
3V3_SS: C1252.1(C1) U1208.13(SS)
3V3_SW: L1204.1 U1208.4(SW)
3V3_SYNTH_IN_PD_FB: C1214.1(C1) C1217.1(C1) U1203.1(VOUT) U1203.2(VOUT) U1203.3(SENSE) ; also sheet 6
3V3_SYNTH_VCO_RF: C1237.1(C1) C1241.1(C1) U1207.1(VOUT) U1207.2(VOUT) U1207.3(SENSE) ; also sheet 6
5V0: C1201.1(C1) C1202.1(C1) C1204.1(C1) C1205.1(C1) C1223.1(C1) C1225.1(C1) C1229.1(C1) C1230.1(C1) C1232.1(C1) C1239.1(C1) C1242.1(C1) C1247.1(C1) C1248.1(C1) C1250.1(C1) C1256.1(C1) C1258.1(C1) R1210.2 U1201.7(VIN) U1201.8(VIN) U1203.7(VIN) U1203.8(VIN) U1204.1(VIN) U1204.6(VIN) U1204.7(AVIN) U1204.20(AVIN) U1205.2(BIAS) U1207.7(VIN) U1207.8(VIN) U1208.1(VIN) U1208.6(VIN) U1208.7(AVIN) U1208.20(AVIN) U1209.8(VIN) U1209.9(VIN) U1210.1(VIN) ; also sheet 1,10,11
5V0_PGOOD: U1201.5(EN) U1203.5(EN) U1207.5(EN) U1210.3(EN) ; also sheet 11
5V0_TRX_RF: C1212.1(C1) C1215.1(C1) U1201.1(VOUT) U1201.2(VOUT) U1201.3(SENSE) ; also sheet 5
GND: C1201.2(C2) C1202.2(C2) C1203.2(C2) C1204.2(C2) C1205.2(C2) C1206.2(C2) C1207.2(C2) C1208.2(C2) C1209.2(C2) C1210.2(C2) C1211.2(C2) C1212.2(C2) C1213.2(C2) C1214.2(C2) C1215.2(C2) C1216.2(C2) C1217.2(C2) C1218.2(C2) C1219.2(C2) C1220.2(C2) C1221.2(C2) C1222.2(C2) C1223.2(C2) C1224.2(C2) C1225.2(C2) C1226.2(C2) C1227.2(C2) C1228.2(C2) C1229.2(C2) C1230.2(C2) C1231.2(C2) C1232.2(C2) C1233.2(C2) C1234.2(C2) C1235.2(C2) C1236.2(C2) C1237.2(C2) C1238.2(C2) C1239.2(C2) C1240.2(C2) C1241.2(C2) C1242.2(C2) C1243.2(C2) C1244.2(C2) C1245.2(C2) C1246.2(C2) C1247.2(C2) C1248.2(C2) C1249.2(C2) C1250.2(C2) C1251.2(C2) C1252.2(C2) C1253.2(C2) C1254.2(C2) C1255.2(C2) C1256.2(C2) C1257.2(C2) C1258.2(C2) C1259.2(C2) R1203.1 R1206.1 R1209.1 R1213.1 R1215.1 U1201.6(GND) U1201.9(GND) U1202.6(GND) U1202.9(GND) U1203.6(GND) U1203.9(GND) U1204.2(PGND) U1204.5(PGND) U1204.8(AGND) U1204.19(AGND) U1204.21(PGND) U1205.3(AGND) U1205.8(PGND) U1205.11(AGND) U1206.6(GND) U1206.9(GND) U1207.6(GND) U1207.9(GND) U1208.2(PGND) U1208.5(PGND) U1208.8(AGND) U1208.19(AGND) U1208.21(PGND) U1209.7(AGND) U1209.10(PGND) U1209.11(PGND) U1210.2(GND) ; also sheet 1,2,3,4,5,6,7,8,9,10,11
N$1: C1207.1(C1) U1202.4(SS)
N$3: C1206.1(C1) U1201.4(SS)
N$5: C1231.1(C1) U1206.4(SS)
N$96: C1208.1(C1) U1203.4(SS)
N$97: C1233.1(C1) U1207.4(SS)
Unconnected: U1205.5(PG)

## Sheet 13 of 13: Power tree
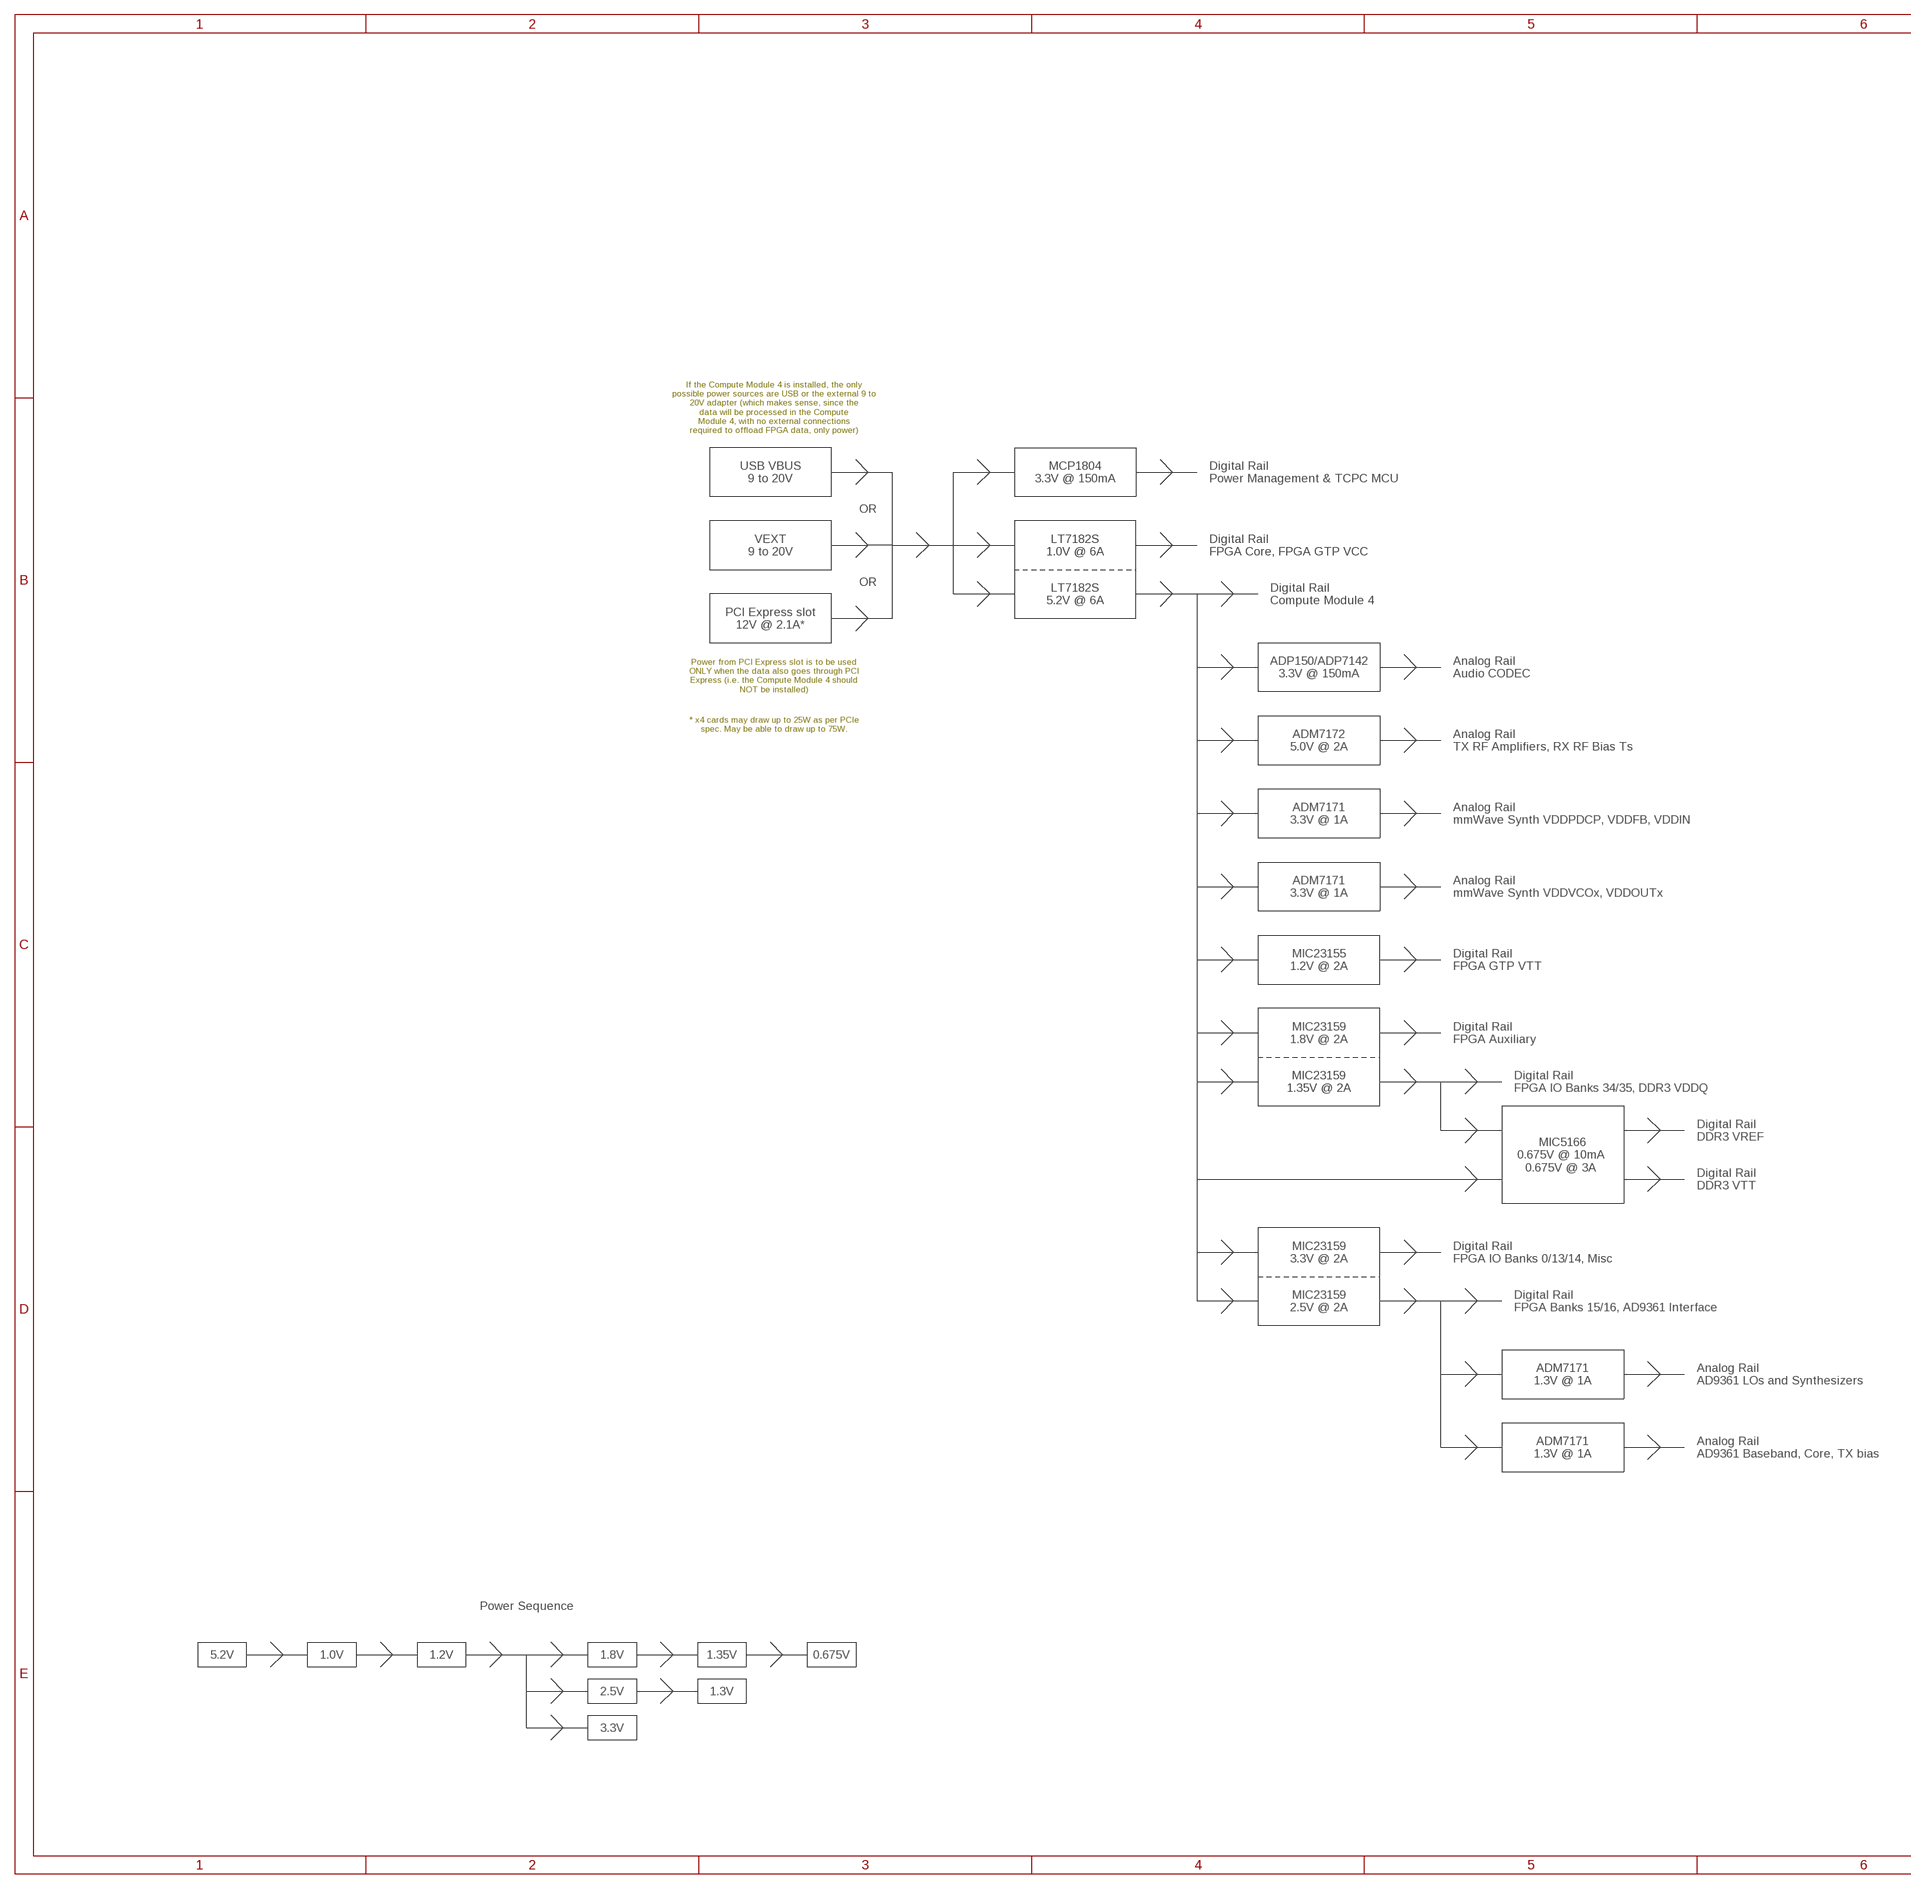
[diagram p24: schematic, sheet 13, part 1 of 2]
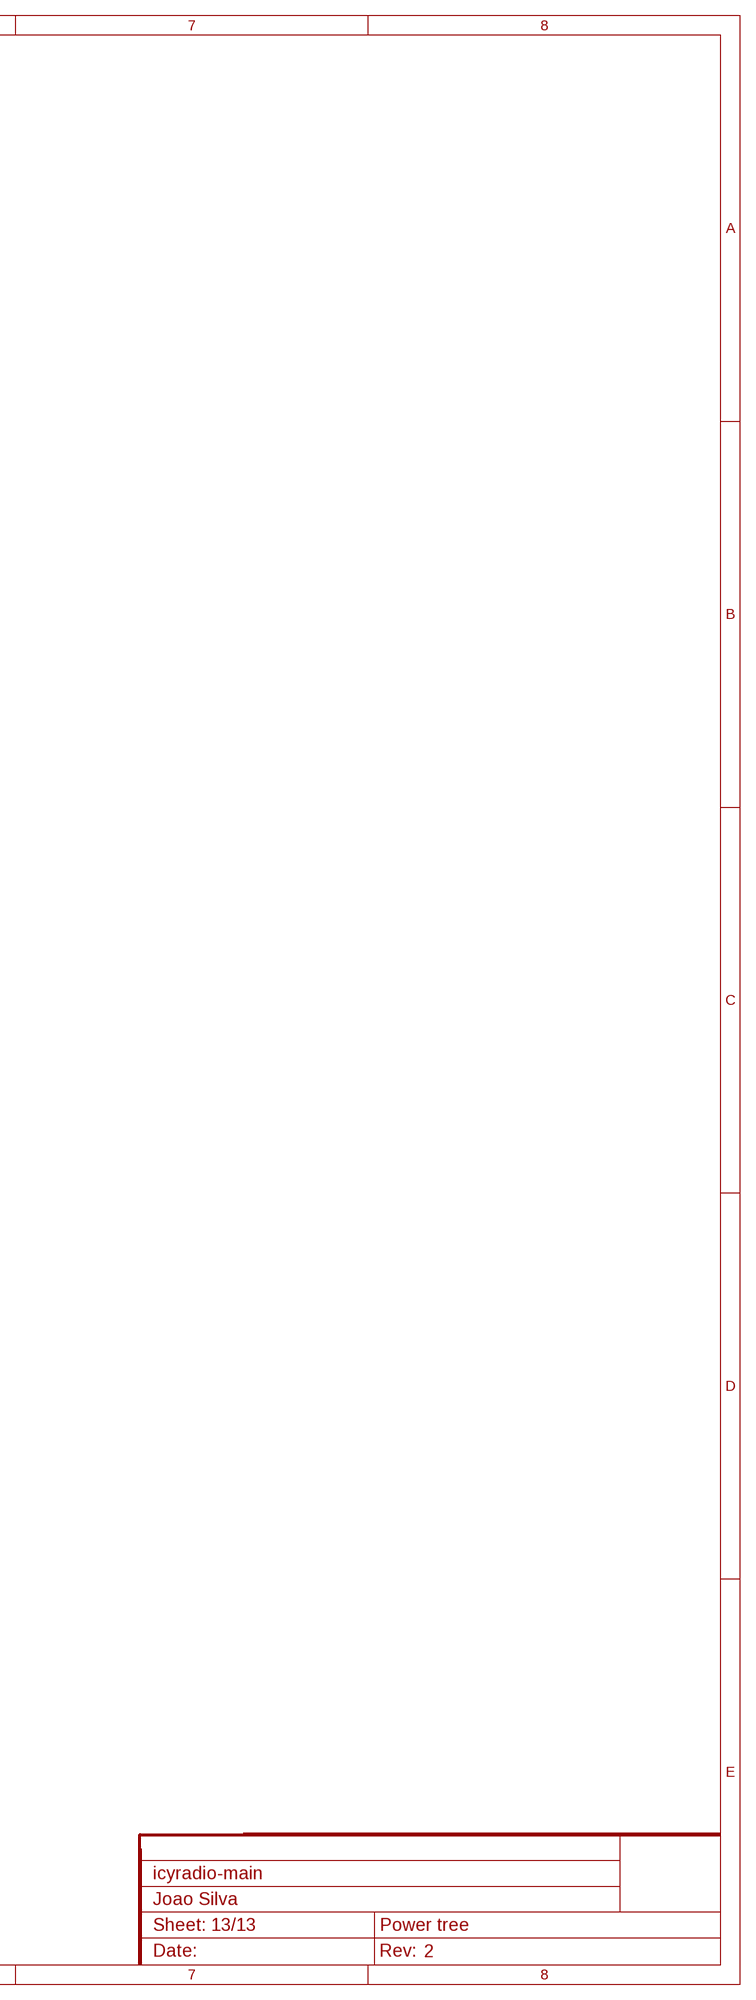
[diagram p25: schematic, sheet 13, part 2 of 2]

### Notes on the sheet
- If the Compute Module 4 is installed, the only
  possible power sources are USB or the external 9 to
  20V adapter (which makes sense, since the
  data will be processed in the Compute
  Module 4, with no external connections
  required to offload FPGA data, only power)
- USB VBUS
  9 to 20V
- MCP1804
  3.3V @ 150mA
- Digital Rail
  Power Management & TCPC MCU
- OR
- VEXT
  9 to 20V
- LT7182S
  1.0V @ 6A
- Digital Rail
  FPGA Core, FPGA GTP VCC
- OR
- LT7182S
  5.2V @ 6A
- Digital Rail
  Compute Module 4
- PCI Express slot
  12V @ 2.1A*
- ADP150/ADP7142
  3.3V @ 150mA
- Analog Rail
  Audio CODEC
- Power from PCI Express slot is to be used
  ONLY when the data also goes through PCI
  Express (i.e. the Compute Module 4 should
  NOT be installed)
- * x4 cards may draw up to 25W as per PCIe
  spec. May be able to draw up to 75W.
- ADM7172
  5.0V @ 2A
- Analog Rail
  TX RF Amplifiers, RX RF Bias Ts
- ADM7171
  3.3V @ 1A
- Analog Rail
  mmWave Synth VDDPDCP, VDDFB, VDDIN
- ADM7171
  3.3V @ 1A
- Analog Rail
  mmWave Synth VDDVCOx, VDDOUTx
- MIC23155
  1.2V @ 2A
- Digital Rail
  FPGA GTP VTT
- MIC23159
  1.8V @ 2A
- Digital Rail
  FPGA Auxiliary
- MIC23159
  1.35V @ 2A
- Digital Rail
  FPGA IO Banks 34/35, DDR3 VDDQ
- Digital Rail
  DDR3 VREF
- MIC5166
  0.675V @ 10mA 
  0.675V @ 3A
- Digital Rail
  DDR3 VTT
- MIC23159
  3.3V @ 2A
- Digital Rail
  FPGA IO Banks 0/13/14, Misc
- MIC23159
  2.5V @ 2A
- Digital Rail
  FPGA Banks 15/16, AD9361 Interface
- ADM7171
  1.3V @ 1A
- Analog Rail
  AD9361 LOs and Synthesizers
- ADM7171
  1.3V @ 1A
- Analog Rail
  AD9361 Baseband, Core, TX bias
- Power Sequence
- 5.2V | 1.0V | 1.2V | 1.8V | 1.35V | 0.675V
- 2.5V | 1.3V
- 3.3V